# EAGLE schematic pdp8i-cpu (EAGLE 6.6.0), part 2 of 3
## Sheet 10 of 40
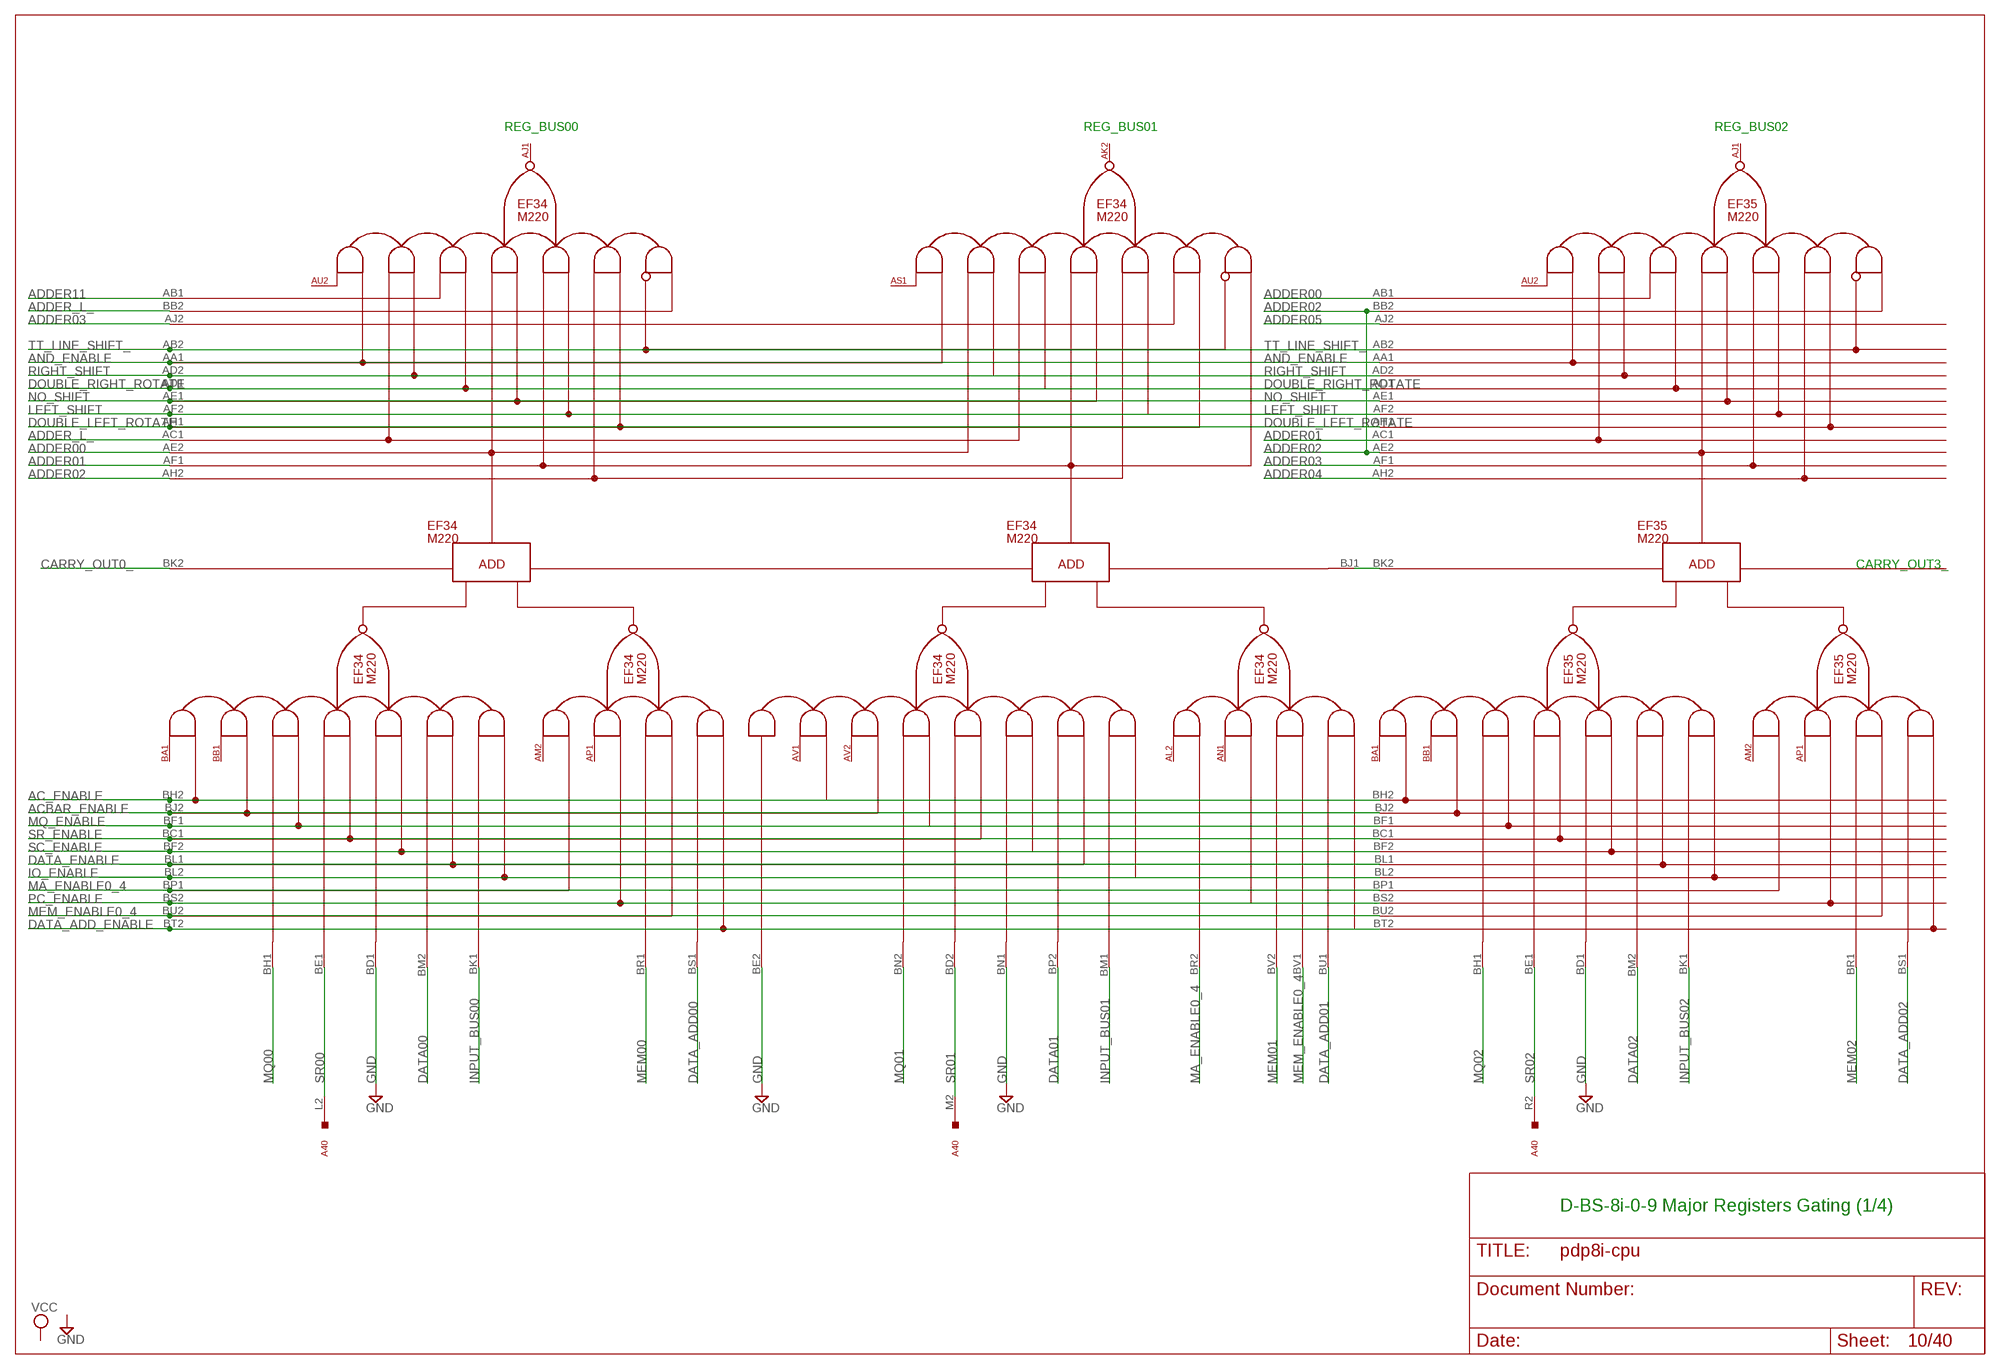
[diagram p9: schematic, sheet 10]

### Parts
A40  W077  M916  [H807]

### Nets
AC_ENABLE: EF34.BH2(B0:BH2) EF35.BH2(B0:BH2) ; also sheet 5,11,12,13
ACBAR_ENABLE: EF34.BJ2(B0:BJ2) EF35.BJ2(B0:BJ2) ; also sheet 5,11,12,13
ADDER00: EF34.AE2(B0:AE2) EF35.AB1(B0:AB1) ; also sheet 9,13
ADDER01: EF34.AF1(B0:AF1) EF35.AC1(B0:AC1) ; also sheet 9
ADDER02: EF34.AH2(B0:AH2) EF35.AE2(B0:AE2) EF35.BB2(B0:BB2) ; also sheet 11
ADDER03: EF34.AJ2(B0:AJ2) EF35.AF1(B0:AF1) ; also sheet 11
ADDER04: EF35.AH2(B0:AH2) ; also sheet 11,12
ADDER05: EF35.AJ2(B0:AJ2) ; also sheet 11,12
ADDER11: EF34.AB1(B0:AB1) ; also sheet 9,12,13
ADDER_L_: EF34.AC1(B0:AC1) EF34.BB2(B0:BB2) ; also sheet 9,13,28
AND_ENABLE: EF34.AA1(B0:AA1) EF35.AA1(B0:AA1) ; also sheet 6,11,12,13
CARRY_OUT0_: EF34.BK2(B0:BK2) ; also sheet 9
DATA00: EF34.BM2(B0:BM2) ; also sheet 14
DATA01: EF34.BP2(B1:BP2) ; also sheet 14
DATA02: EF35.BM2(B0:BM2) ; also sheet 14
DATA_ADD00: EF34.BS1(B0:BS1) ; also sheet 14
DATA_ADD01: EF34.BU1(B1:BU1) ; also sheet 14
DATA_ADD02: EF35.BS1(B0:BS1) ; also sheet 14
DATA_ADD_ENABLE: EF34.BT2(B0:BT2) EF35.BT2(B0:BT2) ; also sheet 5,11,12,13
DATA_ENABLE: EF34.BL1(B0:BL1) EF35.BL1(B0:BL1) ; also sheet 5,11,12,13
DOUBLE_LEFT_ROTATE: EF34.AH1(B0:AH1) EF35.AH1(B0:AH1) ; also sheet 6,9,11,12,13
DOUBLE_RIGHT_ROTATE: EF34.AD1(B0:AD1) EF35.AD1(B0:AD1) ; also sheet 6,9,11,12,13
GND [Suppply]: EF34.BD1(B0:BD1) EF34.BE2(B1:BE2) EF34.BN1(B1:BN1) EF35.BD1(B0:BD1) ; also sheet 2,5,9,11,12,13,14,22,26,27,30
INPUT_BUS00: EF34.BK1(B0:BK1) ; also sheet 14
INPUT_BUS01: EF34.BM1(B1:BM1) ; also sheet 14
INPUT_BUS02: EF35.BK1(B0:BK1) ; also sheet 14
IO_ENABLE: EF34.BL2(B0:BL2) EF35.BL2(B0:BL2) ; also sheet 5,7,11,12,13
LEFT_SHIFT: EF34.AF2(B0:AF2) EF35.AF2(B0:AF2) ; also sheet 6,9,11,12,13
MA_ENABLE0_4: EF34.BP1(B0:BP1) EF34.BR2(B1:BR2) EF35.BP1(B0:BP1) ; also sheet 5,11
MEM00: EF34.BR1(B0:BR1) ; also sheet 4,18,29,31
MEM01: EF34.BV2(B1:BV2) ; also sheet 4,18,31
MEM02: EF35.BR1(B0:BR1) ; also sheet 4,18,31
MEM_ENABLE0_4: EF34.BU2(B0:BU2) EF34.BV1(B1:BV1) EF35.BU2(B0:BU2) ; also sheet 5,6,11
MQ00: EF34.BH1(B0:BH1) ; also sheet 27,28
MQ01: EF34.BN2(B1:BN2) ; also sheet 28
MQ02: EF35.BH1(B0:BH1) ; also sheet 28
MQ_ENABLE: EF34.BF1(B0:BF1) EF35.BF1(B0:BF1) ; also sheet 11,12,13,27
N$160: EF34.BJ1(B1:BJ1) EF35.BK2(B0:BK2)
NO_SHIFT: EF34.AE1(B0:AE1) EF35.AE1(B0:AE1) ; also sheet 6,9,11,12,13
PC_ENABLE: EF34.BS2(B0:BS2) EF35.BS2(B0:BS2) ; also sheet 5,11,12,13
RIGHT_SHIFT: EF34.AD2(B0:AD2) EF35.AD2(B0:AD2) ; also sheet 6,9,11,12,13,28
SC_ENABLE: EF34.BF2(B0:BF2) EF35.BF2(B0:BF2) ; also sheet 11,12,13,27
SR00: A40.L2 EF34.BE1(B0:BE1)
SR01: A40.M2 EF34.BD2(B1:BD2)
SR02: A40.R2 EF35.BE1(B0:BE1)
SR_ENABLE: EF34.BC1(B0:BC1) EF35.BC1(B0:BC1) ; also sheet 5,11,12,13,22
TT_LINE_SHIFT_: EF34.AB2(B0:AB2) EF35.AB2(B0:AB2) ; also sheet 11,12,13,29
Unconnected: A40.A1 A40.B1 A40.B2 A40.C1 A40.D1 A40.E1 A40.F1 A40.H1 A40.J1 A40.K1 A40.L1 A40.M1 A40.N1 A40.N2 A40.P1 A40.P2 A40.R1 A40.S1 A40.T1 A40.U1 A40.V1

### Notes on the sheet
- REG_BUS00 | REG_BUS01 | REG_BUS02
- CARRY_OUT3_
- D-BS-8i-0-9 Major Registers Gating (1/4)

## Sheet 11 of 40
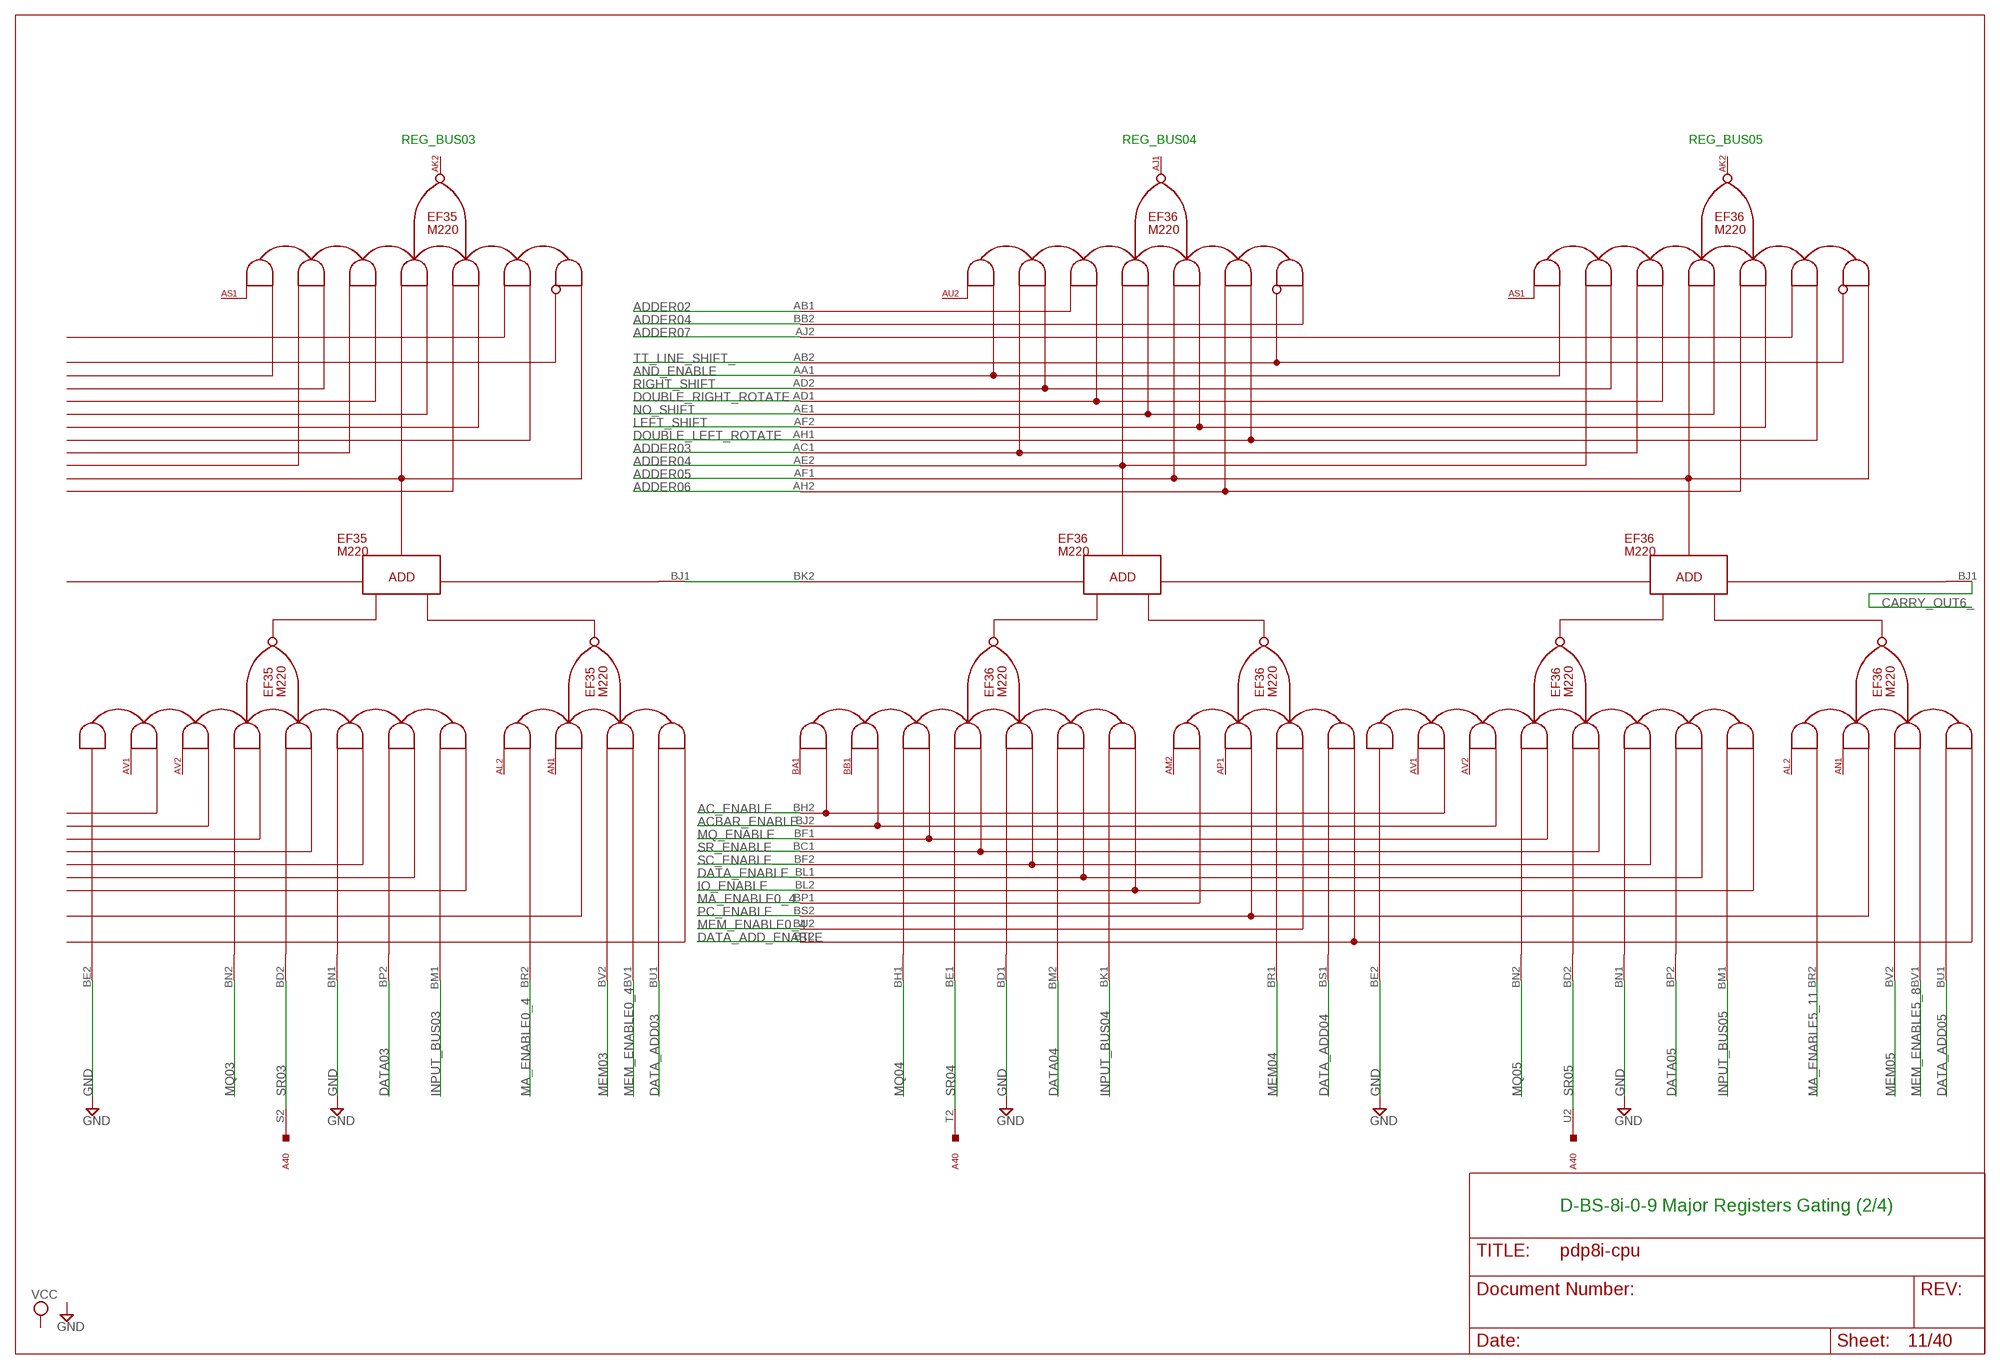
[diagram p10: schematic, sheet 11]

### Nets
AC_ENABLE: EF36.BH2(B0:BH2) ; also sheet 5,10,12,13
ACBAR_ENABLE: EF36.BJ2(B0:BJ2) ; also sheet 5,10,12,13
ADDER02: EF36.AB1(B0:AB1) ; also sheet 10
ADDER03: EF36.AC1(B0:AC1) ; also sheet 10
ADDER04: EF36.AE2(B0:AE2) EF36.BB2(B0:BB2) ; also sheet 10,12
ADDER05: EF36.AF1(B0:AF1) ; also sheet 10,12
ADDER06: EF36.AH2(B0:AH2) ; also sheet 12
ADDER07: EF36.AJ2(B0:AJ2) ; also sheet 12
AND_ENABLE: EF36.AA1(B0:AA1) ; also sheet 6,10,12,13
CARRY_OUT6_: EF36.BJ1(B1:BJ1) ; also sheet 12
DATA03: EF35.BP2(B1:BP2) ; also sheet 14
DATA04: EF36.BM2(B0:BM2) ; also sheet 14
DATA05: EF36.BP2(B1:BP2) ; also sheet 14
DATA_ADD03: EF35.BU1(B1:BU1) ; also sheet 14
DATA_ADD04: EF36.BS1(B0:BS1) ; also sheet 14
DATA_ADD05: EF36.BU1(B1:BU1) ; also sheet 14
DATA_ADD_ENABLE: EF36.BT2(B0:BT2) ; also sheet 5,10,12,13
DATA_ENABLE: EF36.BL1(B0:BL1) ; also sheet 5,10,12,13
DOUBLE_LEFT_ROTATE: EF36.AH1(B0:AH1) ; also sheet 6,9,10,12,13
DOUBLE_RIGHT_ROTATE: EF36.AD1(B0:AD1) ; also sheet 6,9,10,12,13
GND [Suppply]: EF35.BE2(B1:BE2) EF35.BN1(B1:BN1) EF36.BD1(B0:BD1) EF36.BE2(B1:BE2) EF36.BN1(B1:BN1) ; also sheet 2,5,9,10,12,13,14,22,26,27,30
INPUT_BUS03: EF35.BM1(B1:BM1) ; also sheet 14
INPUT_BUS04: EF36.BK1(B0:BK1) ; also sheet 14
INPUT_BUS05: EF36.BM1(B1:BM1) ; also sheet 14
IO_ENABLE: EF36.BL2(B0:BL2) ; also sheet 5,7,10,12,13
LEFT_SHIFT: EF36.AF2(B0:AF2) ; also sheet 6,9,10,12,13
MA_ENABLE0_4: EF35.BR2(B1:BR2) EF36.BP1(B0:BP1) ; also sheet 5,10
MA_ENABLE5_11: EF36.BR2(B1:BR2) ; also sheet 5,12,13
MEM03: EF35.BV2(B1:BV2) ; also sheet 18,31
MEM04: EF36.BR1(B0:BR1) ; also sheet 18,31
MEM05: EF36.BV2(B1:BV2) ; also sheet 18,31
MEM_ENABLE0_4: EF35.BV1(B1:BV1) EF36.BU2(B0:BU2) ; also sheet 5,6,10
MEM_ENABLE5_8: EF36.BV1(B1:BV1) ; also sheet 5,12
MQ03: EF35.BN2(B1:BN2) ; also sheet 28
MQ04: EF36.BH1(B0:BH1) ; also sheet 28
MQ05: EF36.BN2(B1:BN2) ; also sheet 28
MQ_ENABLE: EF36.BF1(B0:BF1) ; also sheet 10,12,13,27
N$133: EF35.BJ1(B1:BJ1) EF36.BK2(B0:BK2)
NO_SHIFT: EF36.AE1(B0:AE1) ; also sheet 6,9,10,12,13
PC_ENABLE: EF36.BS2(B0:BS2) ; also sheet 5,10,12,13
RIGHT_SHIFT: EF36.AD2(B0:AD2) ; also sheet 6,9,10,12,13,28
SC_ENABLE: EF36.BF2(B0:BF2) ; also sheet 10,12,13,27
SR03: A40.S2 EF35.BD2(B1:BD2)
SR04: A40.T2 EF36.BE1(B0:BE1)
SR05: A40.U2 EF36.BD2(B1:BD2)
SR_ENABLE: EF36.BC1(B0:BC1) ; also sheet 5,10,12,13,22
TT_LINE_SHIFT_: EF36.AB2(B0:AB2) ; also sheet 10,12,13,29

### Notes on the sheet
- REG_BUS03 | REG_BUS04 | REG_BUS05
- D-BS-8i-0-9 Major Registers Gating (2/4)

## Sheet 12 of 40
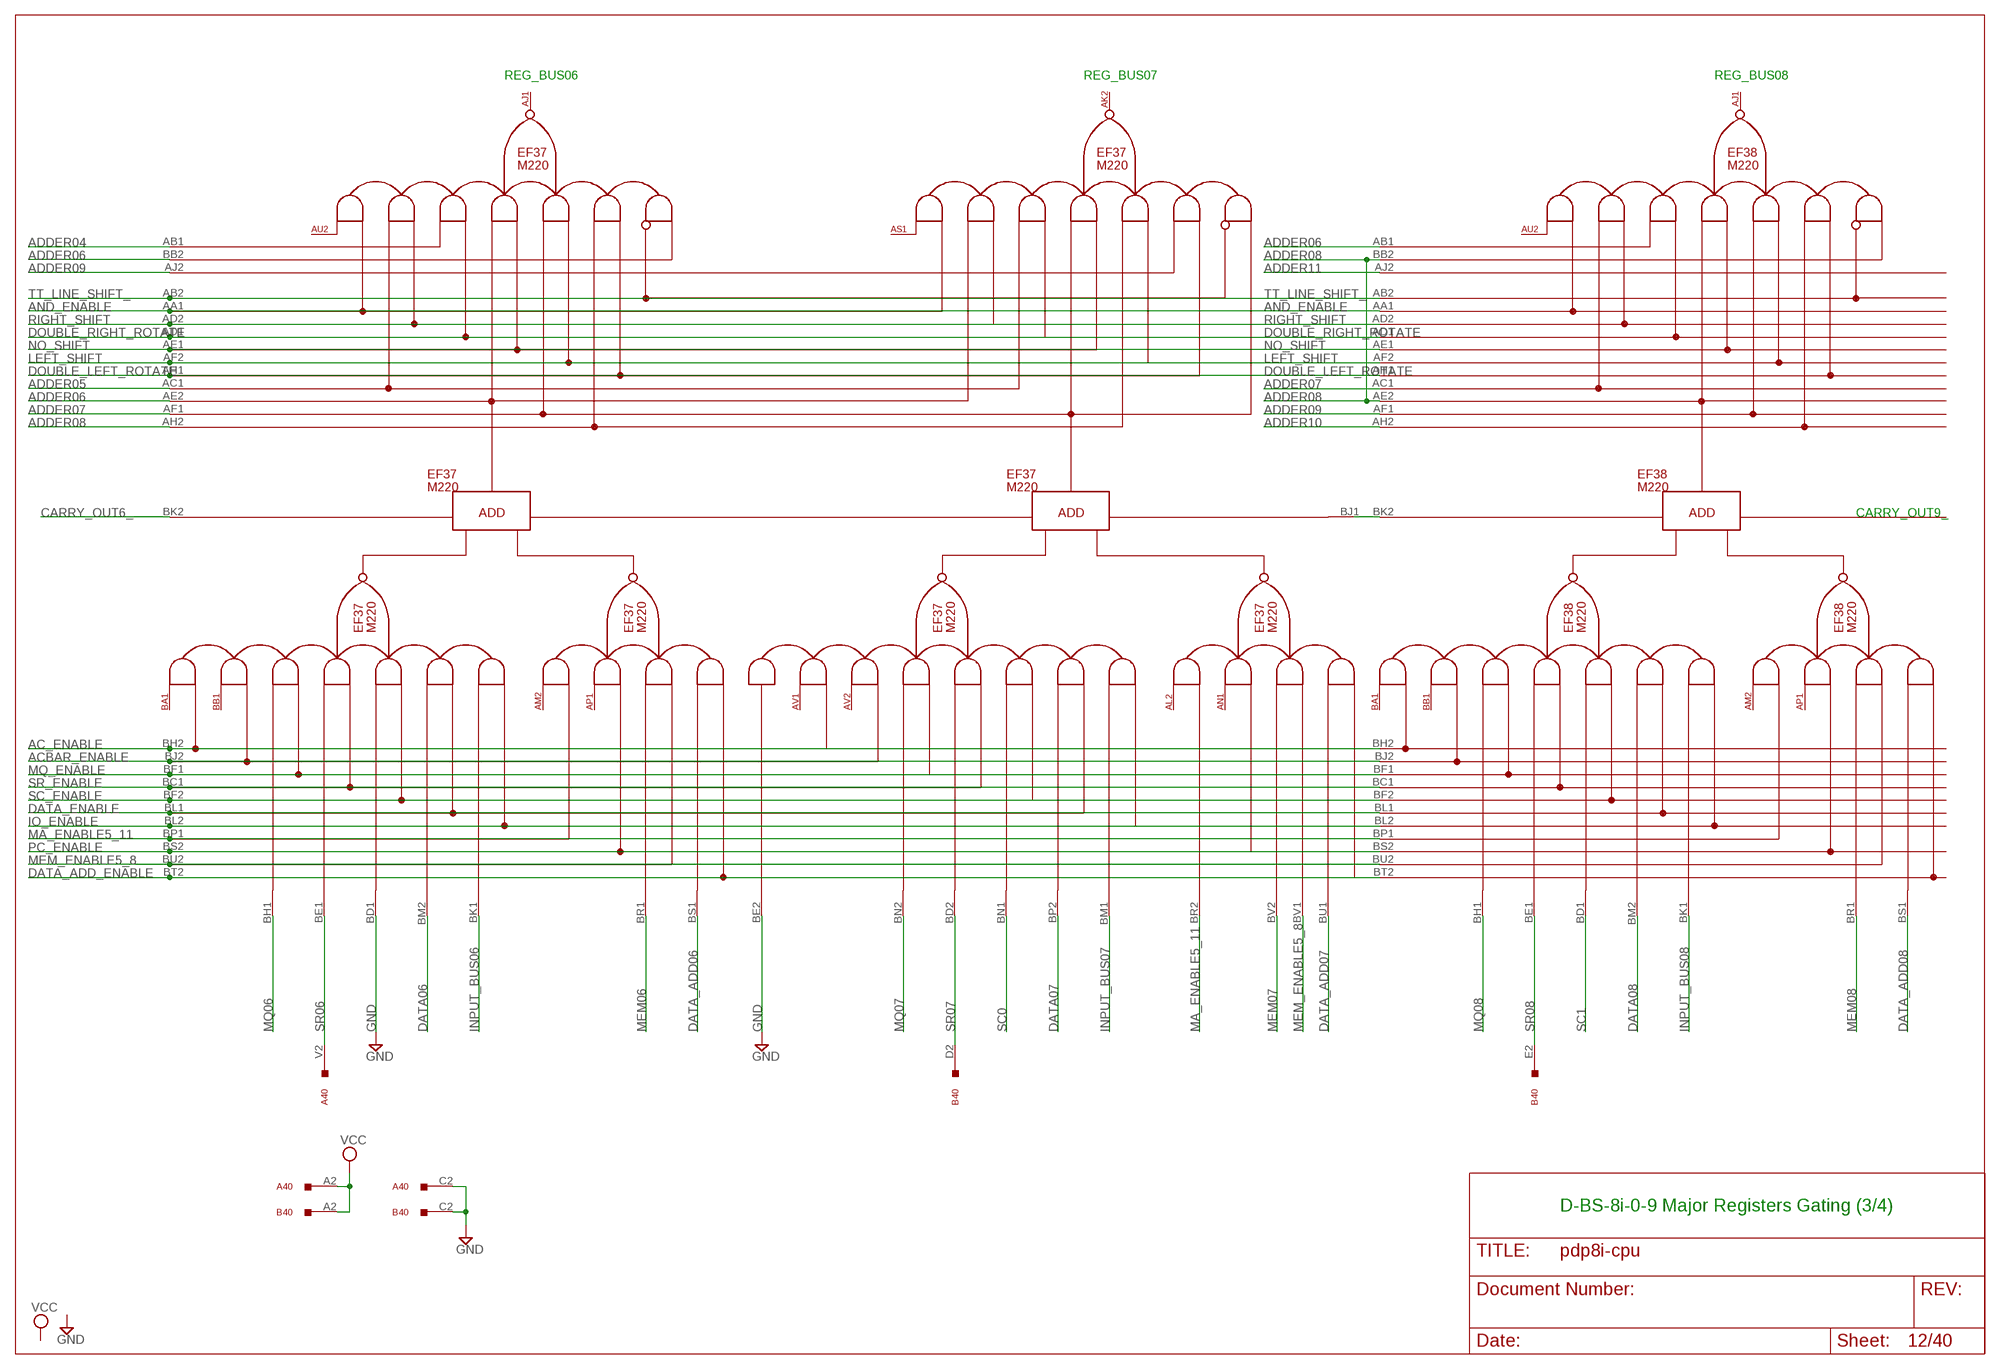
[diagram p11: schematic, sheet 12]

### Nets
AC_ENABLE: EF37.BH2(B0:BH2) EF38.BH2(B0:BH2) ; also sheet 5,10,11,13
ACBAR_ENABLE: EF37.BJ2(B0:BJ2) EF38.BJ2(B0:BJ2) ; also sheet 5,10,11,13
ADDER04: EF37.AB1(B0:AB1) ; also sheet 10,11
ADDER05: EF37.AC1(B0:AC1) ; also sheet 10,11
ADDER06: EF37.AE2(B0:AE2) EF37.BB2(B0:BB2) EF38.AB1(B0:AB1) ; also sheet 11
ADDER07: EF37.AF1(B0:AF1) EF38.AC1(B0:AC1) ; also sheet 11
ADDER08: EF37.AH2(B0:AH2) EF38.AE2(B0:AE2) EF38.BB2(B0:BB2) ; also sheet 13
ADDER09: EF37.AJ2(B0:AJ2) EF38.AF1(B0:AF1) ; also sheet 13
ADDER10: EF38.AH2(B0:AH2) ; also sheet 9,13
ADDER11: EF38.AJ2(B0:AJ2) ; also sheet 9,10,13
AND_ENABLE: EF37.AA1(B0:AA1) EF38.AA1(B0:AA1) ; also sheet 6,10,11,13
CARRY_OUT6_: EF37.BK2(B0:BK2) ; also sheet 11
DATA06: EF37.BM2(B0:BM2) ; also sheet 14
DATA07: EF37.BP2(B1:BP2) ; also sheet 14
DATA08: EF38.BM2(B0:BM2) ; also sheet 14
DATA_ADD06: EF37.BS1(B0:BS1) ; also sheet 14
DATA_ADD07: EF37.BU1(B1:BU1) ; also sheet 14
DATA_ADD08: EF38.BS1(B0:BS1) ; also sheet 14
DATA_ADD_ENABLE: EF37.BT2(B0:BT2) EF38.BT2(B0:BT2) ; also sheet 5,10,11,13
DATA_ENABLE: EF37.BL1(B0:BL1) EF38.BL1(B0:BL1) ; also sheet 5,10,11,13
DOUBLE_LEFT_ROTATE: EF37.AH1(B0:AH1) EF38.AH1(B0:AH1) ; also sheet 6,9,10,11,13
DOUBLE_RIGHT_ROTATE: EF37.AD1(B0:AD1) EF38.AD1(B0:AD1) ; also sheet 6,9,10,11,13
GND [Suppply]: A40.C2 B40.C2 EF37.BD1(B0:BD1) EF37.BE2(B1:BE2) ; also sheet 2,5,9,10,11,13,14,22,26,27,30
INPUT_BUS06: EF37.BK1(B0:BK1) ; also sheet 14
INPUT_BUS07: EF37.BM1(B1:BM1) ; also sheet 14
INPUT_BUS08: EF38.BK1(B0:BK1) ; also sheet 14
IO_ENABLE: EF37.BL2(B0:BL2) EF38.BL2(B0:BL2) ; also sheet 5,7,10,11,13
LEFT_SHIFT: EF37.AF2(B0:AF2) EF38.AF2(B0:AF2) ; also sheet 6,9,10,11,13
MA_ENABLE5_11: EF37.BP1(B0:BP1) EF37.BR2(B1:BR2) EF38.BP1(B0:BP1) ; also sheet 5,11,13
MEM06: EF37.BR1(B0:BR1) ; also sheet 18,31
MEM07: EF37.BV2(B1:BV2) ; also sheet 18,31
MEM08: EF38.BR1(B0:BR1) ; also sheet 18,31
MEM_ENABLE5_8: EF37.BU2(B0:BU2) EF37.BV1(B1:BV1) EF38.BU2(B0:BU2) ; also sheet 5,11
MQ06: EF37.BH1(B0:BH1) ; also sheet 28
MQ07: EF37.BN2(B1:BN2) ; also sheet 28
MQ08: EF38.BH1(B0:BH1) ; also sheet 28
MQ_ENABLE: EF37.BF1(B0:BF1) EF38.BF1(B0:BF1) ; also sheet 10,11,13,27
N$132: EF37.BJ1(B1:BJ1) EF38.BK2(B0:BK2)
NO_SHIFT: EF37.AE1(B0:AE1) EF38.AE1(B0:AE1) ; also sheet 6,9,10,11,13
PC_ENABLE: EF37.BS2(B0:BS2) EF38.BS2(B0:BS2) ; also sheet 5,10,11,13
RIGHT_SHIFT: EF37.AD2(B0:AD2) EF38.AD2(B0:AD2) ; also sheet 6,9,10,11,13,28
SC0: EF37.BN1(B1:BN1) ; also sheet 27,28
SC1: EF38.BD1(B0:BD1) ; also sheet 27,28
SC_ENABLE: EF37.BF2(B0:BF2) EF38.BF2(B0:BF2) ; also sheet 10,11,13,27
SR06: A40.V2 EF37.BE1(B0:BE1)
SR07: B40.D2 EF37.BD2(B1:BD2)
SR08: B40.E2 EF38.BE1(B0:BE1)
SR_ENABLE: EF37.BC1(B0:BC1) EF38.BC1(B0:BC1) ; also sheet 5,10,11,13,22
TT_LINE_SHIFT_: EF37.AB2(B0:AB2) EF38.AB2(B0:AB2) ; also sheet 10,11,13,29
VCC [Suppply]: A40.A2 B40.A2 ; also sheet 9

### Notes on the sheet
- REG_BUS06 | REG_BUS07 | REG_BUS08
- CARRY_OUT9_
- D-BS-8i-0-9 Major Registers Gating (3/4)

## Sheet 13 of 40
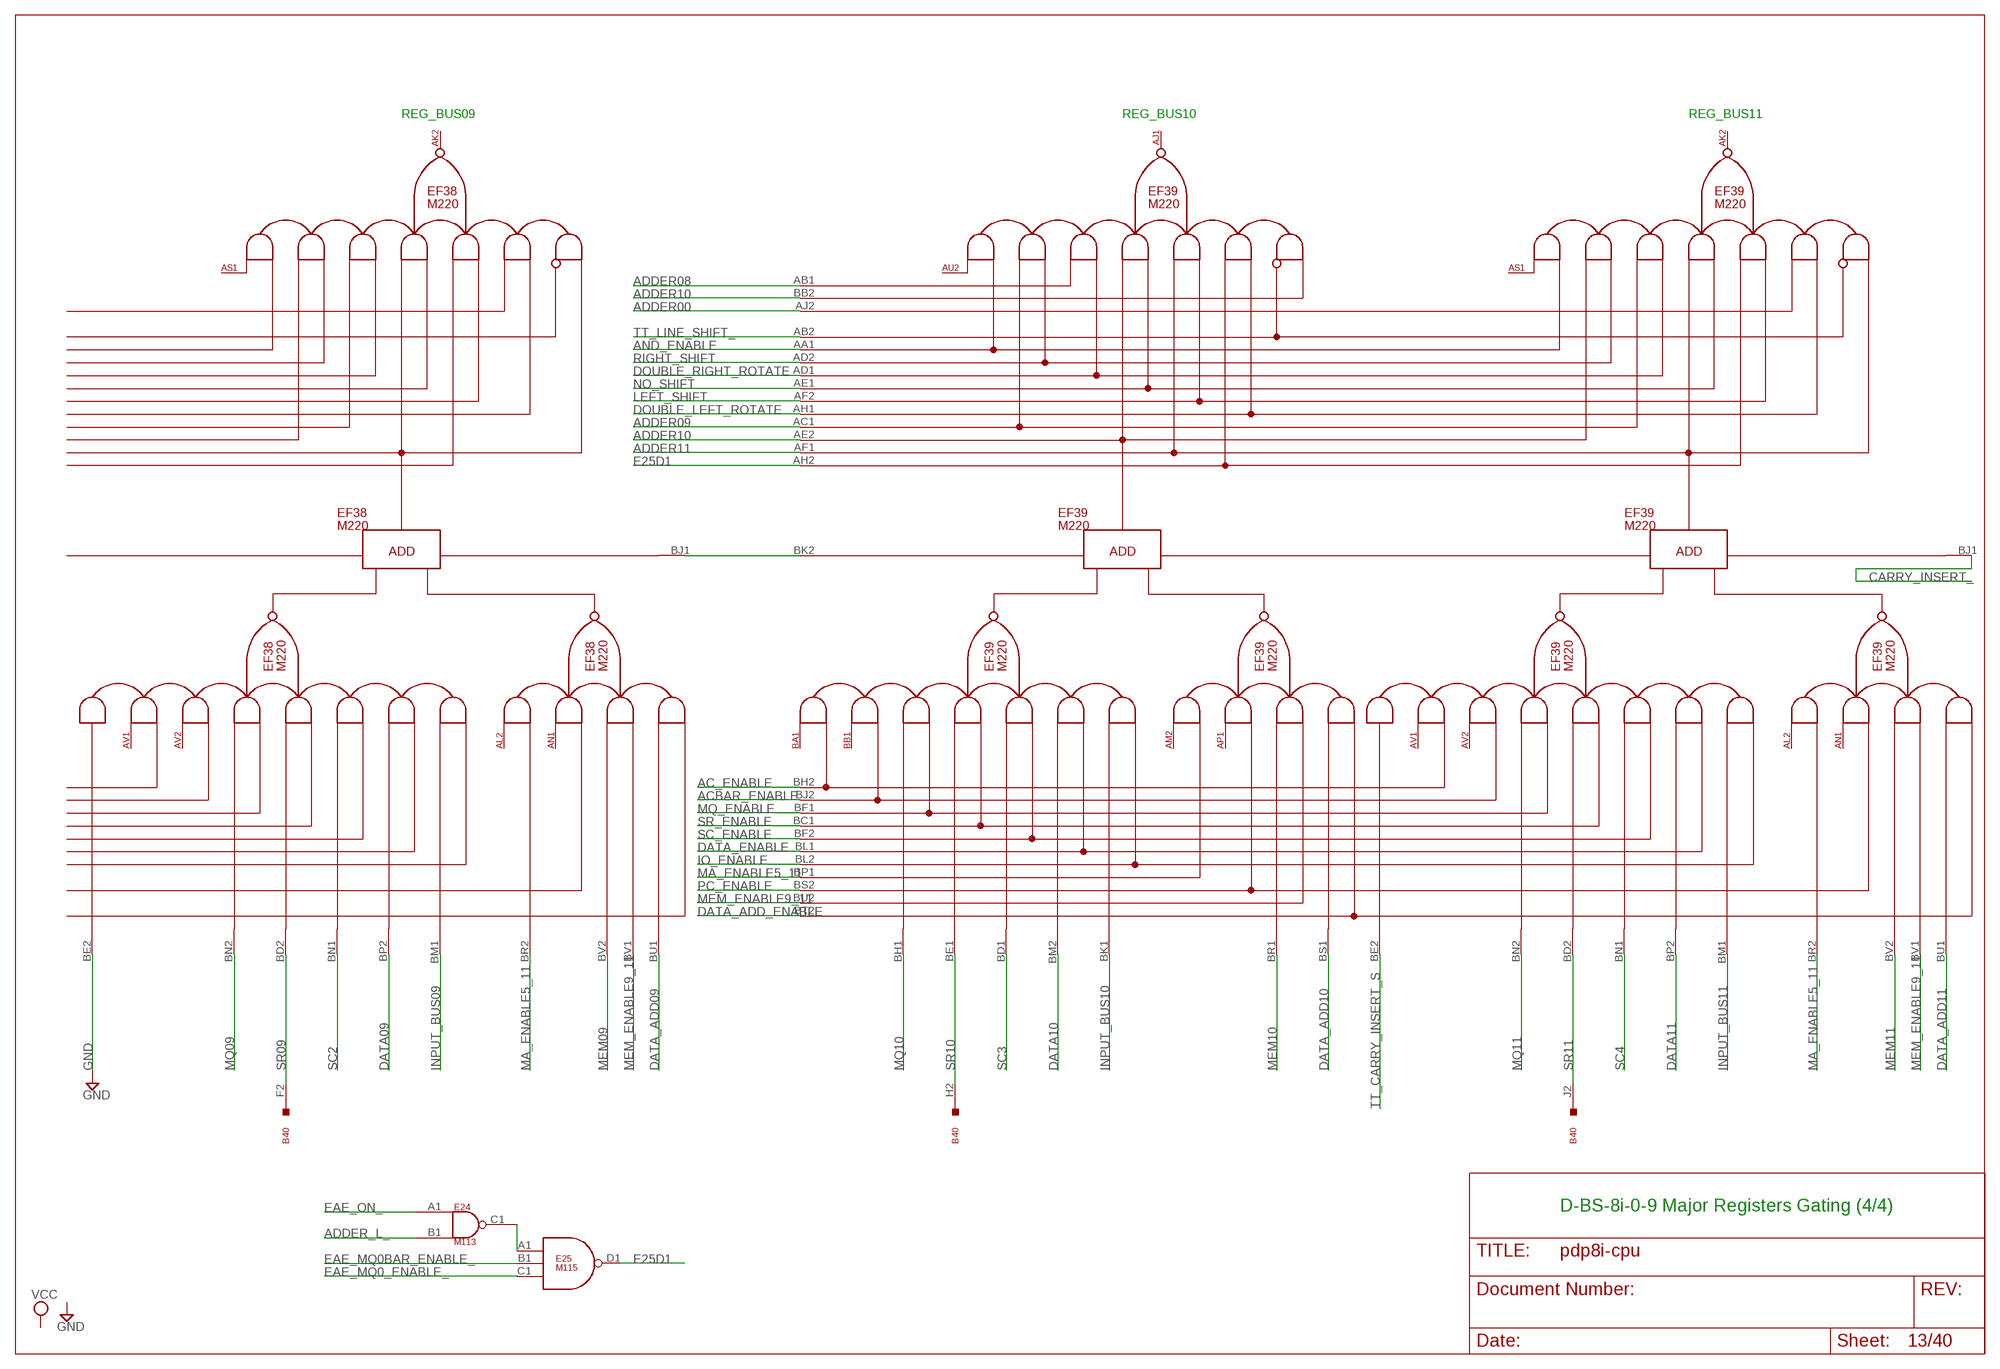
[diagram p12: schematic, sheet 13]

### Nets
AC_ENABLE: EF39.BH2(B0:BH2) ; also sheet 5,10,11,12
ACBAR_ENABLE: EF39.BJ2(B0:BJ2) ; also sheet 5,10,11,12
ADDER00: EF39.AJ2(B0:AJ2) ; also sheet 9,10
ADDER08: EF39.AB1(B0:AB1) ; also sheet 12
ADDER09: EF39.AC1(B0:AC1) ; also sheet 12
ADDER10: EF39.AE2(B0:AE2) EF39.BB2(B0:BB2) ; also sheet 9,12
ADDER11: EF39.AF1(B0:AF1) ; also sheet 9,10,12
ADDER_L_: E24.B1(C1:IN2) ; also sheet 9,10,28
AND_ENABLE: EF39.AA1(B0:AA1) ; also sheet 6,10,11,12
CARRY_INSERT_: EF39.BJ1(B1:BJ1) ; also sheet 6
DATA09: EF38.BP2(B1:BP2) ; also sheet 14
DATA10: EF39.BM2(B0:BM2) ; also sheet 14
DATA11: EF39.BP2(B1:BP2) ; also sheet 14
DATA_ADD09: EF38.BU1(B1:BU1) ; also sheet 14
DATA_ADD10: EF39.BS1(B0:BS1) ; also sheet 14
DATA_ADD11: EF39.BU1(B1:BU1) ; also sheet 14
DATA_ADD_ENABLE: EF39.BT2(B0:BT2) ; also sheet 5,10,11,12
DATA_ENABLE: EF39.BL1(B0:BL1) ; also sheet 5,10,11,12
DOUBLE_LEFT_ROTATE: EF39.AH1(B0:AH1) ; also sheet 6,9,10,11,12
DOUBLE_RIGHT_ROTATE: EF39.AD1(B0:AD1) ; also sheet 6,9,10,11,12
E25D1: E25.D1(D1:OUT) EF39.AH2(B0:AH2)
EAE_MQ0_ENABLE_: E25.C1(D1:IN3) ; also sheet 27
EAE_MQ0BAR_ENABLE_: E25.B1(D1:IN2) ; also sheet 27
EAE_ON_: E24.A1(C1:IN1) ; also sheet 9,27
GND [Suppply]: EF38.BE2(B1:BE2) ; also sheet 2,5,9,10,11,12,14,22,26,27,30
INPUT_BUS09: EF38.BM1(B1:BM1) ; also sheet 14
INPUT_BUS10: EF39.BK1(B0:BK1) ; also sheet 14
INPUT_BUS11: EF39.BM1(B1:BM1) ; also sheet 14
IO_ENABLE: EF39.BL2(B0:BL2) ; also sheet 5,7,10,11,12
LEFT_SHIFT: EF39.AF2(B0:AF2) ; also sheet 6,9,10,11,12
MA_ENABLE5_11: EF38.BR2(B1:BR2) EF39.BP1(B0:BP1) EF39.BR2(B1:BR2) ; also sheet 5,11,12
MEM09: EF38.BV2(B1:BV2) ; also sheet 18,29,31
MEM10: EF39.BR1(B0:BR1) ; also sheet 18,31
MEM11: EF39.BV2(B1:BV2) ; also sheet 18,31
MEM_ENABLE9_11: EF38.BV1(B1:BV1) EF39.BU2(B0:BU2) EF39.BV1(B1:BV1) ; also sheet 5
MQ09: EF38.BN2(B1:BN2) ; also sheet 28
MQ10: EF39.BH1(B0:BH1) ; also sheet 27,28
MQ11: EF39.BN2(B1:BN2) ; also sheet 27,28
MQ_ENABLE: EF39.BF1(B0:BF1) ; also sheet 10,11,12,27
N$136: EF38.BJ1(B1:BJ1) EF39.BK2(B0:BK2)
N$140: E24.C1(C1:OUT) E25.A1(D1:IN1)
NO_SHIFT: EF39.AE1(B0:AE1) ; also sheet 6,9,10,11,12
PC_ENABLE: EF39.BS2(B0:BS2) ; also sheet 5,10,11,12
RIGHT_SHIFT: EF39.AD2(B0:AD2) ; also sheet 6,9,10,11,12,28
SC2: EF38.BN1(B1:BN1) ; also sheet 27,28
SC3: EF39.BD1(B0:BD1) ; also sheet 27,28
SC4: EF39.BN1(B1:BN1) ; also sheet 27,28
SC_ENABLE: EF39.BF2(B0:BF2) ; also sheet 10,11,12,27
SR09: B40.F2 EF38.BD2(B1:BD2)
SR10: B40.H2 EF39.BE1(B0:BE1)
SR11: B40.J2 EF39.BD2(B1:BD2)
SR_ENABLE: EF39.BC1(B0:BC1) ; also sheet 5,10,11,12,22
TT_CARRY_INSERT_S: EF39.BE2(B1:BE2) ; also sheet 29
TT_LINE_SHIFT_: EF39.AB2(B0:AB2) ; also sheet 10,11,12,29

### Notes on the sheet
- REG_BUS09 | REG_BUS10 | REG_BUS11
- D-BS-8i-0-9 Major Registers Gating (4/4)

## Sheet 14 of 40
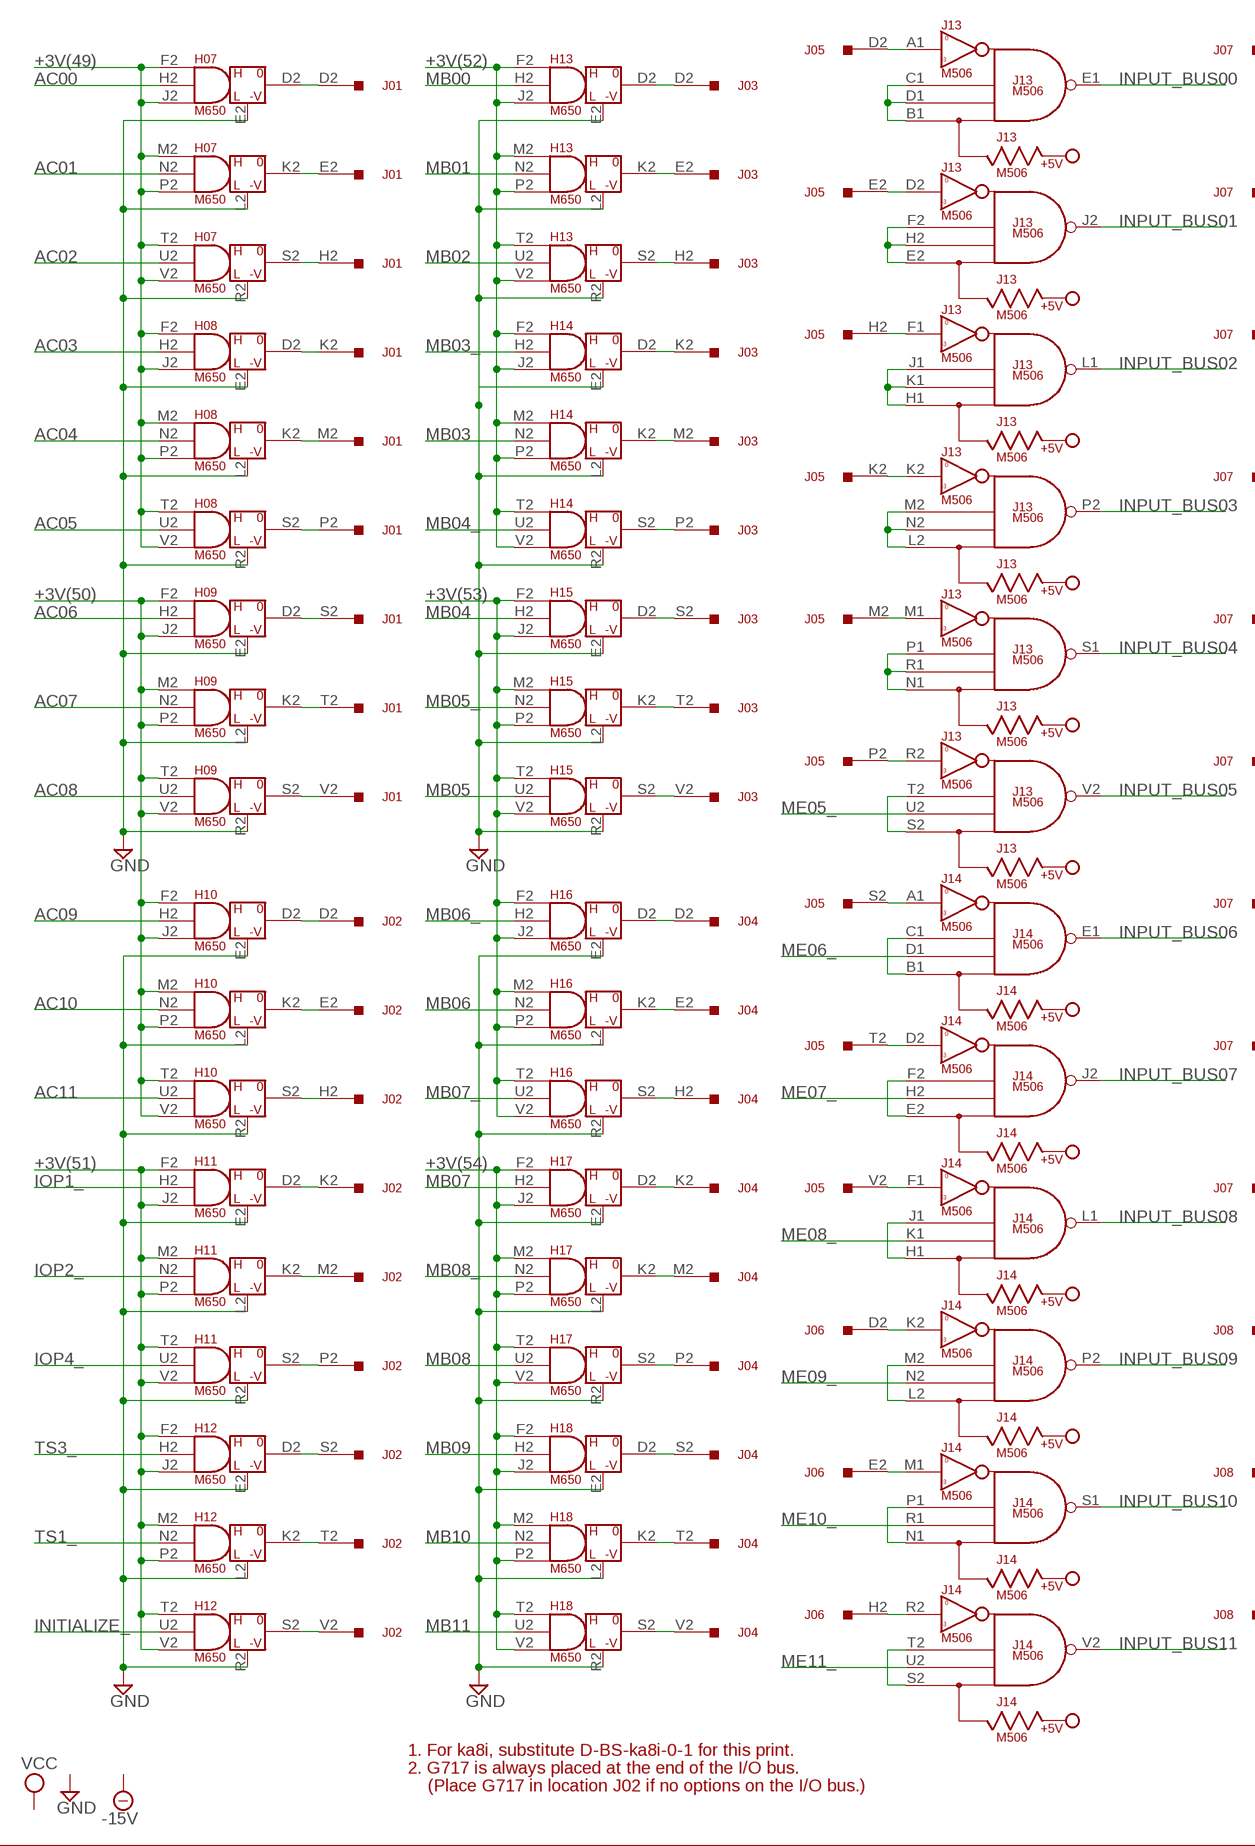
[diagram p13: schematic, sheet 14, part 1 of 2]
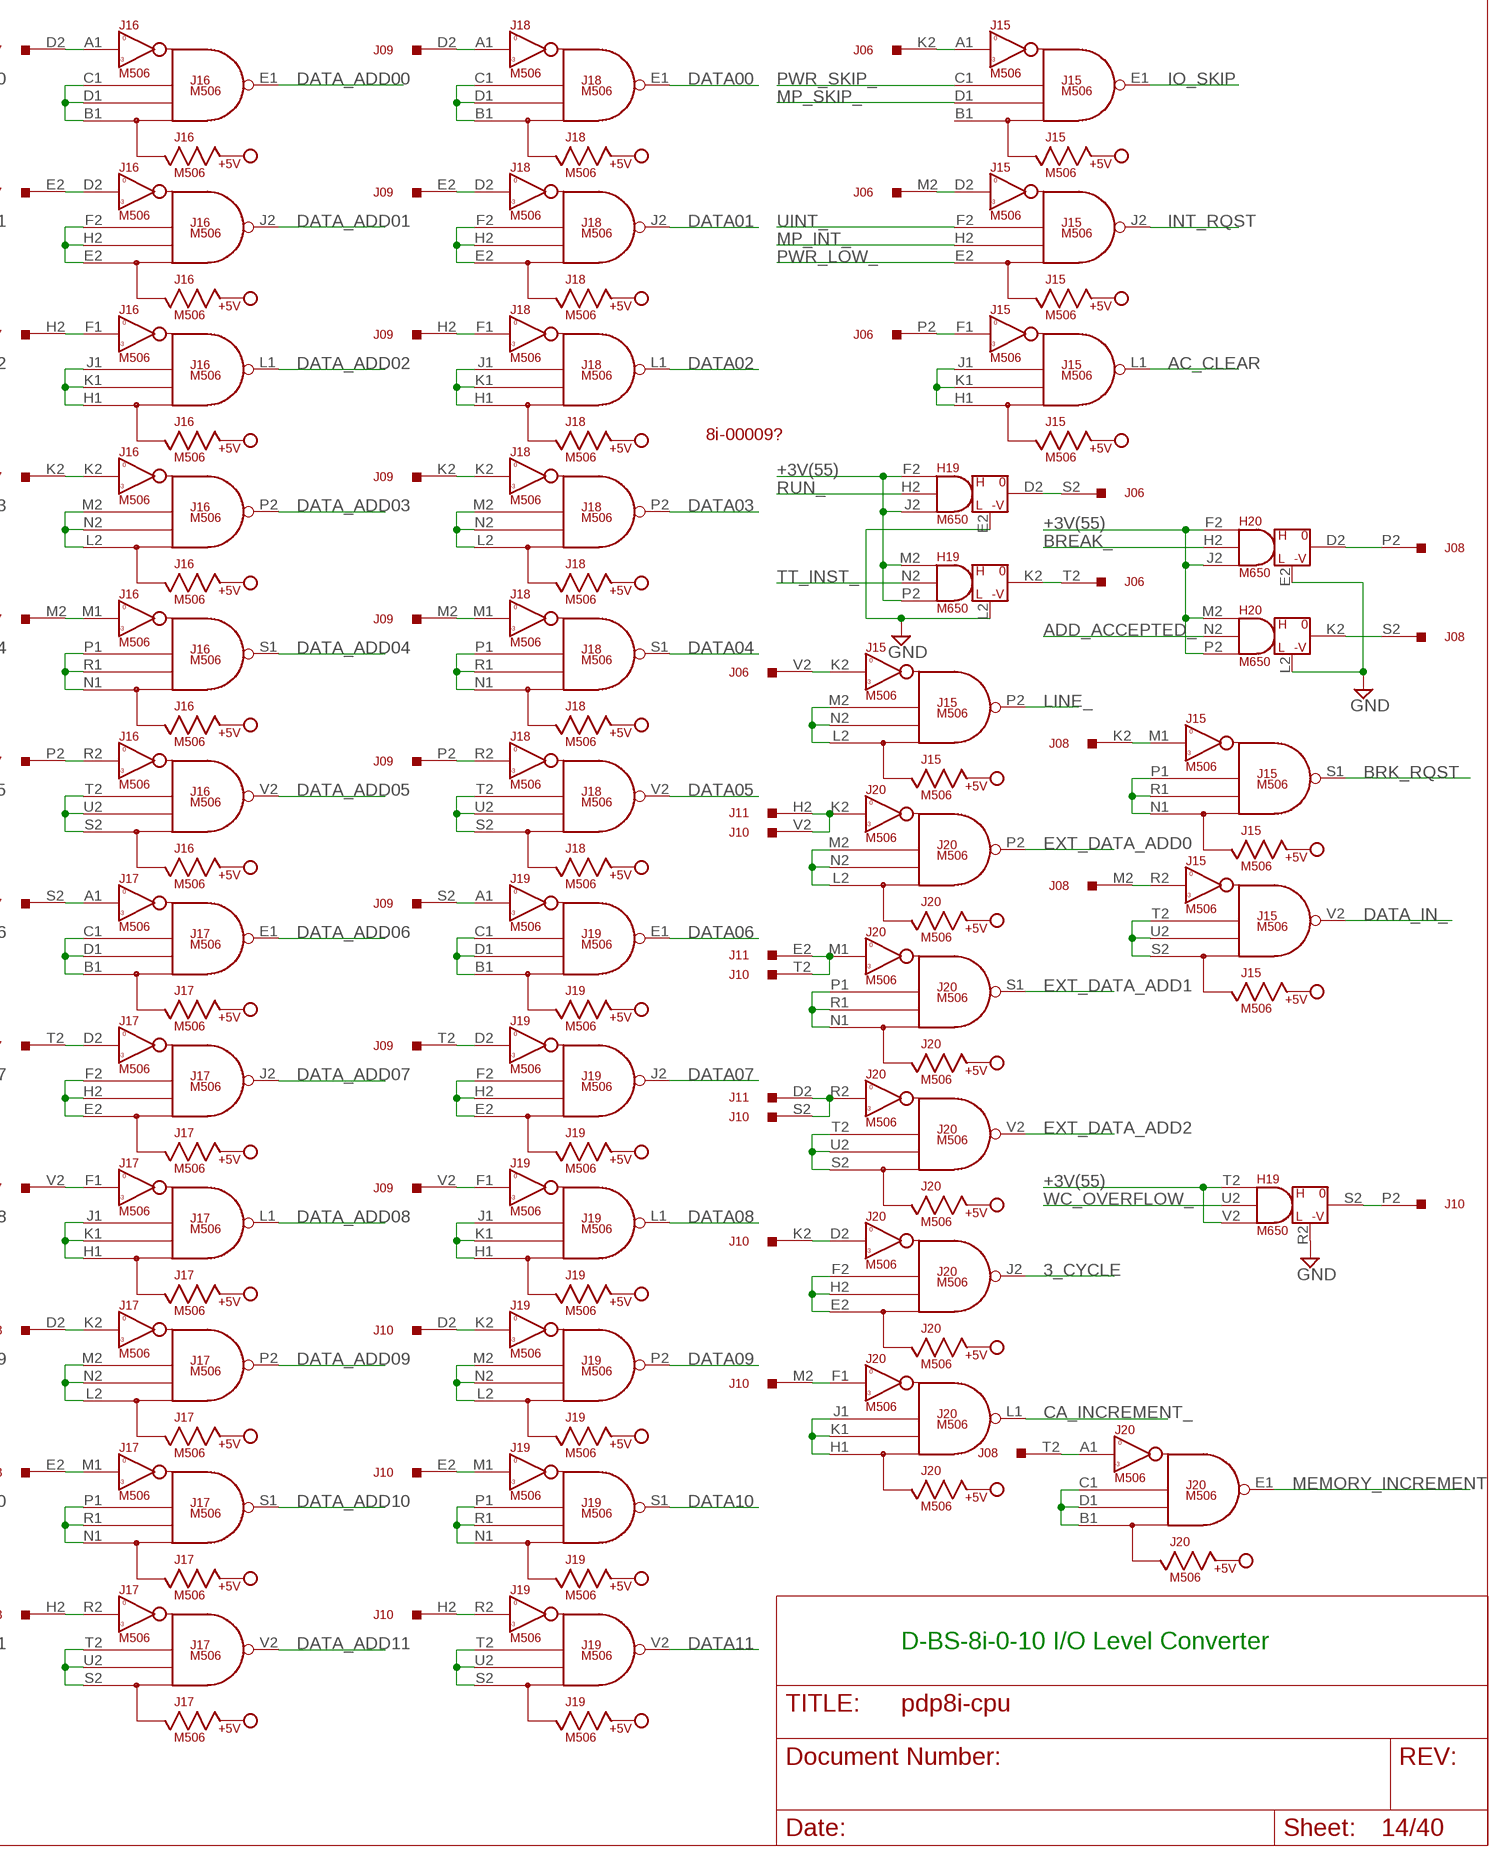
[diagram p14: schematic, sheet 14, part 2 of 2]

### Parts
H07  M650  [H807]
H08  M650  [H807]
H09  M650  [H807]
H10  M650  [H807]
H11  M650  [H807]
H12  M650  [H807]
H13  M650  [H807]
H14  M650  [H807]
H15  M650  [H807]
H16  M650  [H807]
H17  M650  [H807]
H18  M650  [H807]
H19  M650  [H807]
H20  M650  [H807]
J01  W011  [H807]
J02  W011  [H807]
J03  W011  [H807]
J04  W011  [H807]
J05  W011  [H807]
J06  W011  [H807]
J07  W011  [H807]
J08  W011  [H807]
J09  W011  [H807]
J10  W011  [H807]
J13  M506  [H807]
J14  M506  [H807]
J15  M506  [H807]
J16  M506  [H807]
J17  M506  [H807]
J18  M506  [H807]
J19  M506  [H807]
J20  M506  [H807]

### Nets
3_CYCLE: J20.J2(J2:OUT) ; also sheet 4
3CYCLE: J10.K2 J20.D2(J2:IN)
+3V(49): H07.F2(IN1) H07.J2(IN3) H07.M2(IN1) H07.P2(IN3) H07.T2(IN1) H07.V2(IN3) H08.F2(IN1) H08.J2(IN3) H08.M2(IN1) H08.P2(IN3) H08.T2(IN1) H08.V2(IN3) ; also sheet 1
+3V(50): H09.F2(IN1) H09.J2(IN3) H09.M2(IN1) H09.P2(IN3) H09.T2(IN1) H09.V2(IN3) H10.F2(IN1) H10.J2(IN3) H10.M2(IN1) H10.P2(IN3) H10.T2(IN1) H10.V2(IN3) ; also sheet 1
+3V(51): H11.F2(IN1) H11.J2(IN3) H11.M2(IN1) H11.P2(IN3) H11.T2(IN1) H11.V2(IN3) H12.F2(IN1) H12.J2(IN3) H12.M2(IN1) H12.P2(IN3) H12.T2(IN1) H12.V2(IN3) ; also sheet 1
+3V(52): H13.F2(IN1) H13.J2(IN3) H13.M2(IN1) H13.P2(IN3) H13.T2(IN1) H13.V2(IN3) H14.F2(IN1) H14.J2(IN3) H14.M2(IN1) H14.P2(IN3) H14.T2(IN1) H14.V2(IN3) ; also sheet 1
+3V(53): H15.F2(IN1) H15.J2(IN3) H15.M2(IN1) H15.P2(IN3) H15.T2(IN1) H15.V2(IN3) H16.F2(IN1) H16.J2(IN3) H16.M2(IN1) H16.P2(IN3) H16.T2(IN1) H16.V2(IN3) ; also sheet 1
+3V(54): H17.F2(IN1) H17.J2(IN3) H17.M2(IN1) H17.P2(IN3) H17.T2(IN1) H17.V2(IN3) H18.F2(IN1) H18.J2(IN3) H18.M2(IN1) H18.P2(IN3) H18.T2(IN1) H18.V2(IN3) ; also sheet 1
+3V(55): H19.F2(IN1) H19.J2(IN3) H19.M2(IN1) H19.P2(IN3) H19.T2(IN1) H19.V2(IN3) H20.F2(IN1) H20.J2(IN3) H20.M2(IN1) H20.P2(IN3) ; also sheet 1,4
AC00: H07.H2(IN2) ; also sheet 7,9,27,28
AC01: H07.N2(IN2) ; also sheet 9,27,28
AC02: H07.U2(IN2) ; also sheet 9,27,28
AC03: H08.H2(IN2) ; also sheet 9,28
AC04: H08.N2(IN2) ; also sheet 9,28
AC05: H08.U2(IN2) ; also sheet 9,28
AC06: H09.H2(IN2) ; also sheet 9,28
AC07: H09.N2(IN2) ; also sheet 9,28
AC08: H09.U2(IN2) ; also sheet 9,28
AC09: H10.H2(IN2) ; also sheet 9,28
AC10: H10.N2(IN2) ; also sheet 9,28
AC11: H10.U2(IN2) ; also sheet 9,28
AC_CLEAR: J15.L1(L1:OUT) ; also sheet 5
ACCLR: J06.P2 J15.F1(L1:IN)
ADD_ACCEPTED_: H20.N2(IN2) ; also sheet 8
BAC00: H07.D2(OUT) J01.D2
BAC01: H07.K2(OUT) J01.E2
BAC02: H07.S2(OUT) J01.H2
BAC03: H08.D2(OUT) J01.K2
BAC04: H08.K2(OUT) J01.M2
BAC05: H08.S2(OUT) J01.P2
BAC06: H09.D2(OUT) J01.S2
BAC07: H09.K2(OUT) J01.T2
BAC08: H09.S2(OUT) J01.V2
BAC09: H10.D2(OUT) J02.D2
BAC10: H10.K2(OUT) J02.E2
BAC11: H10.S2(OUT) J02.H2
BADD_ACCEPTED_: H20.K2(OUT) J08.S2
BBREAK: H20.D2(OUT) J08.P2
BINITIALIZE_: H12.S2(OUT) J02.V2
BIOP1_: H11.D2(OUT) J02.K2
BIOP2_: H11.K2(OUT) J02.M2
BIOP4_: H11.S2(OUT) J02.P2
BMB00: H13.D2(OUT) J03.D2
BMB01: H13.K2(OUT) J03.E2
BMB02: H13.S2(OUT) J03.H2
BMB03: H14.K2(OUT) J03.M2
BMB03_: H14.D2(OUT) J03.K2
BMB04: H15.D2(OUT) J03.S2
BMB04_: H14.S2(OUT) J03.P2
BMB05: H15.S2(OUT) J03.V2
BMB05_: H15.K2(OUT) J03.T2
BMB06: H16.K2(OUT) J04.E2
BMB06_: H16.D2(OUT) J04.D2
BMB07: H17.D2(OUT) J04.K2
BMB07_: H16.S2(OUT) J04.H2
BMB08: H17.S2(OUT) J04.P2
BMB08_: H17.K2(OUT) J04.M2
BMB09: H18.D2(OUT) J04.S2
BMB10: H18.K2(OUT) J04.T2
BMB11: H18.S2(OUT) J04.V2
BREAK_: H20.H2(IN2) ; also sheet 4
BRK_RQST: J15.S1(S1:OUT) ; also sheet 4
BRQ: J08.K2 J15.M1(S1:IN)
BRUN_: H19.D2(OUT) J06.S2
BTS1: H12.K2(OUT) J02.T2
BTS3: H12.D2(OUT) J02.S2
BTT_INST_: H19.K2(OUT) J06.T2
BWC_OVERFLOW: H19.S2(OUT) J10.P2
CA_INCR_: J10.M2 J20.F1(L1:IN)
CA_INCREMENT_: J20.L1(L1:OUT) ; also sheet 6
D00: J09.D2 J18.A1(E1:IN)
D01: J09.E2 J18.D2(J2:IN)
D02: J09.H2 J18.F1(L1:IN)
D03: J09.K2 J18.K2(P2:IN)
D04: J09.M2 J18.M1(S1:IN)
D05: J09.P2 J18.R2(V2:IN)
D06: J09.S2 J19.A1(E1:IN)
D07: J09.T2 J19.D2(J2:IN)
D08: J09.V2 J19.F1(L1:IN)
D09: J10.D2 J19.K2(P2:IN)
D10: J10.E2 J19.M1(S1:IN)
D11: J10.H2 J19.R2(V2:IN)
D_IN_: J08.M2 J15.R2(V2:IN)
DA00: J07.D2 J16.A1(E1:IN)
DA01: J07.E2 J16.D2(J2:IN)
DA02: J07.H2 J16.F1(L1:IN)
DA03: J07.K2 J16.K2(P2:IN)
DA04: J07.M2 J16.M1(S1:IN)
DA05: J07.P2 J16.R2(V2:IN)
DA06: J07.S2 J17.A1(E1:IN)
DA07: J07.T2 J17.D2(J2:IN)
DA08: J07.V2 J17.F1(L1:IN)
DA09: J08.D2 J17.K2(P2:IN)
DA10: J08.E2 J17.M1(S1:IN)
DA11: J08.H2 J17.R2(V2:IN)
DATA00: J18.E1(E1:OUT) ; also sheet 10
DATA01: J18.J2(J2:OUT) ; also sheet 10
DATA02: J18.L1(L1:OUT) ; also sheet 10
DATA03: J18.P2(P2:OUT) ; also sheet 11
DATA04: J18.S1(S1:OUT) ; also sheet 11
DATA05: J18.V2(V2:OUT) ; also sheet 11
DATA06: J19.E1(E1:OUT) ; also sheet 12
DATA07: J19.J2(J2:OUT) ; also sheet 12
DATA08: J19.L1(L1:OUT) ; also sheet 12
DATA09: J19.P2(P2:OUT) ; also sheet 13
DATA10: J19.S1(S1:OUT) ; also sheet 13
DATA11: J19.V2(V2:OUT) ; also sheet 13
DATA_ADD00: J16.E1(E1:OUT) ; also sheet 10
DATA_ADD01: J16.J2(J2:OUT) ; also sheet 10
DATA_ADD02: J16.L1(L1:OUT) ; also sheet 10
DATA_ADD03: J16.P2(P2:OUT) ; also sheet 11
DATA_ADD04: J16.S1(S1:OUT) ; also sheet 11
DATA_ADD05: J16.V2(V2:OUT) ; also sheet 11
DATA_ADD06: J17.E1(E1:OUT) ; also sheet 12
DATA_ADD07: J17.J2(J2:OUT) ; also sheet 12
DATA_ADD08: J17.L1(L1:OUT) ; also sheet 12
DATA_ADD09: J17.P2(P2:OUT) ; also sheet 13
DATA_ADD10: J17.S1(S1:OUT) ; also sheet 13
DATA_ADD11: J17.V2(V2:OUT) ; also sheet 13
DATA_IN_: J15.V2(V2:OUT) ; also sheet 5
EDA0: J10.V2 J11.H2 J20.K2(P2:IN)
EDA1: J10.T2 J11.E2 J20.M1(S1:IN)
EDA2: J10.S2 J11.D2 J20.R2(V2:IN)
EXT_DATA_ADD0: J20.P2(P2:OUT) ; also sheet 21
EXT_DATA_ADD1: J20.S1(S1:OUT) ; also sheet 21
EXT_DATA_ADD2: J20.V2(V2:OUT) ; also sheet 21
GND [Suppply]: H07.E2(SLOW) H07.L2(SLOW) H07.R2(SLOW) H08.E2(SLOW) H08.L2(SLOW) H08.R2(SLOW) H09.E2(SLOW) H09.L2(SLOW) H09.R2(SLOW) H10.E2(SLOW) H10.L2(SLOW) H10.R2(SLOW) H11.E2(SLOW) H11.L2(SLOW) H11.R2(SLOW) H12.E2(SLOW) H12.L2(SLOW) H12.R2(SLOW) H13.E2(SLOW) H13.L2(SLOW) H13.R2(SLOW) H14.E2(SLOW) H14.L2(SLOW) H14.R2(SLOW) H15.E2(SLOW) H15.L2(SLOW) H15.R2(SLOW) H16.E2(SLOW) H16.L2(SLOW) H16.R2(SLOW) H17.E2(SLOW) H17.L2(SLOW) H17.R2(SLOW) H18.E2(SLOW) H18.L2(SLOW) H18.R2(SLOW) H19.E2(SLOW) H19.L2(SLOW) H19.R2(SLOW) H20.E2(SLOW) H20.L2(SLOW) ; also sheet 2,5,9,10,11,12,13,22,26,27,30
IN00: J05.D2 J13.A1(E1:IN)
IN01: J05.E2 J13.D2(J2:IN)
IN02: J05.H2 J13.F1(L1:IN)
IN03: J05.K2 J13.K2(P2:IN)
IN04: J05.M2 J13.M1(S1:IN)
IN05: J05.P2 J13.R2(V2:IN)
IN06: J05.S2 J14.A1(E1:IN)
IN07: J05.T2 J14.D2(J2:IN)
IN08: J05.V2 J14.F1(L1:IN)
IN09: J06.D2 J14.K2(P2:IN)
IN10: J06.E2 J14.M1(S1:IN)
IN11: J06.H2 J14.R2(V2:IN)
INITIALIZE_: H12.U2(IN2) ; also sheet 2,26,30,32
INPUT_BUS00: J13.E1(E1:OUT) ; also sheet 10
INPUT_BUS01: J13.J2(J2:OUT) ; also sheet 10
INPUT_BUS02: J13.L1(L1:OUT) ; also sheet 10
INPUT_BUS03: J13.P2(P2:OUT) ; also sheet 11
INPUT_BUS04: J13.S1(S1:OUT) ; also sheet 11
INPUT_BUS05: J13.V2(V2:OUT) ; also sheet 11
INPUT_BUS06: J14.E1(E1:OUT) ; also sheet 12
INPUT_BUS07: J14.J2(J2:OUT) ; also sheet 12
INPUT_BUS08: J14.L1(L1:OUT) ; also sheet 12
INPUT_BUS09: J14.P2(P2:OUT) ; also sheet 13
INPUT_BUS10: J14.S1(S1:OUT) ; also sheet 13
INPUT_BUS11: J14.V2(V2:OUT) ; also sheet 13
INT_RQST: J15.J2(J2:OUT) ; also sheet 8
IO_SKIP: J15.E1(E1:OUT) ; also sheet 7
IOP1_: H11.H2(IN2) ; also sheet 2,5
IOP2_: H11.N2(IN2) ; also sheet 2,5
IOP4_: H11.U2(IN2) ; also sheet 2,5
IRQ: J06.M2 J15.D2(J2:IN)
LINE_: J15.P2(P2:OUT) ; also sheet 29
LINE_IN: J06.V2 J15.K2(P2:IN)
MB00: H13.H2(IN2) ; also sheet 9,21,30
MB01: H13.N2(IN2) ; also sheet 9,21,30
MB02: H13.U2(IN2) ; also sheet 9,21,30
MB03: H14.N2(IN2) ; also sheet 4,5,9,21,27,29,30
MB03_: H14.H2(IN2) ; also sheet 4,5,6,7,8,9,22,30,32
MB04: H15.H2(IN2) ; also sheet 5,9,21,22,30
MB04_: H14.U2(IN2) ; also sheet 5,8,9,27,29,30,32
MB05: H15.U2(IN2) ; also sheet 5,7,9,21,27,30,32
MB05_: H15.N2(IN2) ; also sheet 5,8,9,22,29,30
MB06: H16.N2(IN2) ; also sheet 5,7,9,21,22,27,30
MB06_: H16.H2(IN2) ; also sheet 5,8,9,22,29,30,32
MB07: H17.H2(IN2) ; also sheet 5,7,9,21,22,26,27,30
MB07_: H16.U2(IN2) ; also sheet 5,8,9,22,26,28,29,30,32
MB08: H17.U2(IN2) ; also sheet 6,7,9,21,22,26,27,30
MB08_: H17.N2(IN2) ; also sheet 6,7,8,9,22,26,28,29,30,32
MB09: H18.H2(IN2) ; also sheet 2,5,6,9,21,22,27,29,30
MB10: H18.N2(IN2) ; also sheet 2,6,8,9,21,22,27,29,30
MB11: H18.U2(IN2) ; also sheet 2,6,9,21,22,27,29,30
ME05_: J13.U2(V2:IN4) ; also sheet 26
ME06_: J14.D1(E1:IN4) ; also sheet 22
ME07_: J14.H2(J2:IN4) ; also sheet 22
ME08_: J14.K1(L1:IN4) ; also sheet 22
ME09_: J14.N2(P2:IN4) ; also sheet 22
ME10_: J14.R1(S1:IN4) ; also sheet 22
ME11_: J14.U2(V2:IN4) ; also sheet 22
MEM_INCR: J08.T2 J20.A1(E1:IN)
MEMORY_INCREMENT: J20.E1(E1:OUT) ; also sheet 6,8
MP_INT_: J15.H2(J2:IN4) ; also sheet 30
MP_SKIP_: J15.D1(E1:IN4) ; also sheet 30
N$28: J14.S2(V2:IN2) J14.T2(V2:IN3)
N$131: J14.N1(S1:IN2) J14.P1(S1:IN3)
N$138: J14.L2(P2:IN2) J14.M2(P2:IN3)
N$139: J14.H1(L1:IN2) J14.J1(L1:IN3)
N$141: J14.E2(J2:IN2) J14.F2(J2:IN3)
N$142: J14.B1(E1:IN2) J14.C1(E1:IN3)
N$143: J13.S2(V2:IN2) J13.T2(V2:IN3)
N$144: J13.N1(S1:IN2) J13.P1(S1:IN3) J13.R1(S1:IN4)
N$145: J13.L2(P2:IN2) J13.M2(P2:IN3) J13.N2(P2:IN4)
N$146: J13.H1(L1:IN2) J13.J1(L1:IN3) J13.K1(L1:IN4)
N$147: J13.E2(J2:IN2) J13.F2(J2:IN3) J13.H2(J2:IN4)
N$148: J15.H1(L1:IN2) J15.J1(L1:IN3) J15.K1(L1:IN4)
N$150: J13.B1(E1:IN2) J13.C1(E1:IN3) J13.D1(E1:IN4)
N$200: J16.E2(J2:IN2) J16.F2(J2:IN3) J16.H2(J2:IN4)
N$201: J16.N1(S1:IN2) J16.P1(S1:IN3) J16.R1(S1:IN4)
N$202: J16.B1(E1:IN2) J16.C1(E1:IN3) J16.D1(E1:IN4)
N$203: J16.H1(L1:IN2) J16.J1(L1:IN3) J16.K1(L1:IN4)
N$204: J16.L2(P2:IN2) J16.M2(P2:IN3) J16.N2(P2:IN4)
N$205: J16.S2(V2:IN2) J16.T2(V2:IN3) J16.U2(V2:IN4)
N$206: J17.N1(S1:IN2) J17.P1(S1:IN3) J17.R1(S1:IN4)
N$207: J17.B1(E1:IN2) J17.C1(E1:IN3) J17.D1(E1:IN4)
N$208: J17.E2(J2:IN2) J17.F2(J2:IN3) J17.H2(J2:IN4)
N$209: J17.H1(L1:IN2) J17.J1(L1:IN3) J17.K1(L1:IN4)
N$210: J17.L2(P2:IN2) J17.M2(P2:IN3) J17.N2(P2:IN4)
N$211: J17.S2(V2:IN2) J17.T2(V2:IN3) J17.U2(V2:IN4)
N$212: J19.S2(V2:IN2) J19.T2(V2:IN3) J19.U2(V2:IN4)
N$213: J19.N1(S1:IN2) J19.P1(S1:IN3) J19.R1(S1:IN4)
N$214: J19.L2(P2:IN2) J19.M2(P2:IN3) J19.N2(P2:IN4)
N$215: J19.H1(L1:IN2) J19.J1(L1:IN3) J19.K1(L1:IN4)
N$216: J19.E2(J2:IN2) J19.F2(J2:IN3) J19.H2(J2:IN4)
N$217: J19.B1(E1:IN2) J19.C1(E1:IN3) J19.D1(E1:IN4)
N$218: J18.S2(V2:IN2) J18.T2(V2:IN3) J18.U2(V2:IN4)
N$219: J18.N1(S1:IN2) J18.P1(S1:IN3) J18.R1(S1:IN4)
N$220: J18.L2(P2:IN2) J18.M2(P2:IN3) J18.N2(P2:IN4)
N$221: J18.H1(L1:IN2) J18.J1(L1:IN3) J18.K1(L1:IN4)
N$222: J18.E2(J2:IN2) J18.F2(J2:IN3) J18.H2(J2:IN4)
N$223: J18.B1(E1:IN2) J18.C1(E1:IN3) J18.D1(E1:IN4)
N$243: J15.L2(P2:IN2) J15.M2(P2:IN3) J15.N2(P2:IN4)
N$245: J15.S2(V2:IN2) J15.T2(V2:IN3) J15.U2(V2:IN4)
N$246: J15.N1(S1:IN2) J15.P1(S1:IN3) J15.R1(S1:IN4)
N$250: J20.B1(E1:IN2) J20.C1(E1:IN3) J20.D1(E1:IN4)
N$253: J20.E2(J2:IN2) J20.F2(J2:IN3) J20.H2(J2:IN4)
N$254: J20.H1(L1:IN2) J20.J1(L1:IN3) J20.K1(L1:IN4)
N$259: J20.N1(S1:IN2) J20.P1(S1:IN3) J20.R1(S1:IN4)
N$260: J20.L2(P2:IN2) J20.M2(P2:IN3) J20.N2(P2:IN4)
N$261: J20.S2(V2:IN2) J20.T2(V2:IN3) J20.U2(V2:IN4)
PWR_LOW_: J15.E2(J2:IN2) ; also sheet 32
PWR_SKIP_: J15.C1(E1:IN3) ; also sheet 32
RUN_: H19.H2(IN2) ; also sheet 2
SKIPB: J06.K2 J15.A1(E1:IN)
TS1_: H12.N2(IN2) ; also sheet 2
TS3_: H12.H2(IN2) ; also sheet 2
TT_INST_: H19.N2(IN2) ; also sheet 2,9,29
UINT_: J15.F2(J2:IN3) ; also sheet 26
WC_OVERFLOW_: H19.U2(IN2) ; also sheet 8
Unconnected: H20.R2(SLOW) H20.S2(OUT) H20.T2(IN1) H20.U2(IN2) H20.V2(IN3) J08.V2 J15.B1(E1:IN2)

### Notes on the sheet
- 8i-00009?
- D-BS-8i-0-10 I/O Level Converter
- 1. For ka8i, substitute D-BS-ka8i-0-1 for this print.
- 2. G717 is always placed at the end of the I/O bus.
- (Place G717 in location J02 if no options on the I/O bus.)

## Sheet 15 of 40
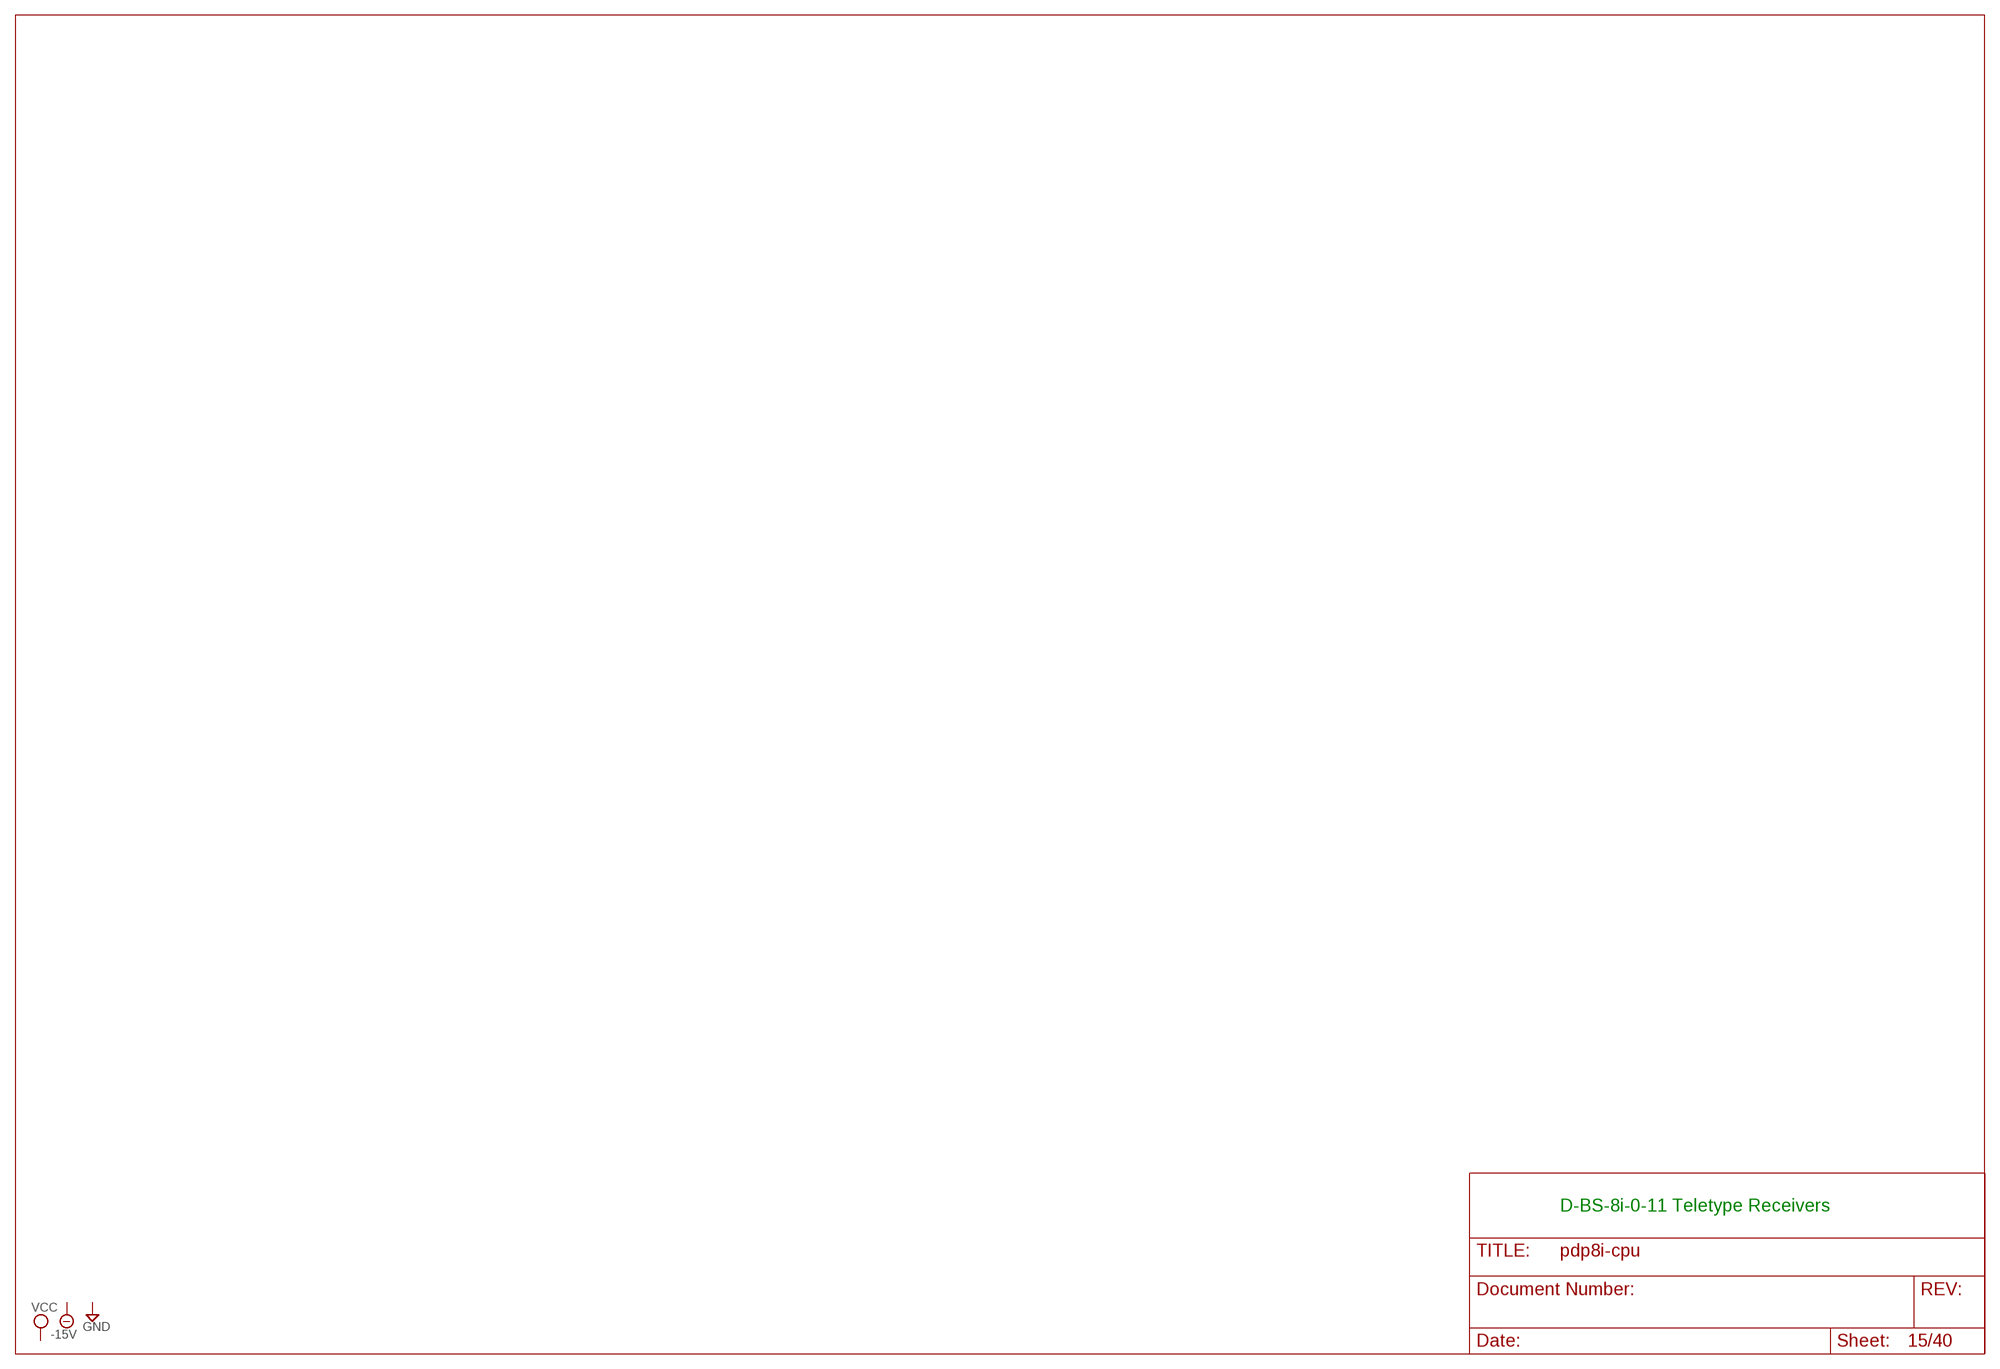
[diagram p15: schematic, sheet 15]

### Notes on the sheet
- D-BS-8i-0-11 Teletype Receivers

## Sheet 16 of 40
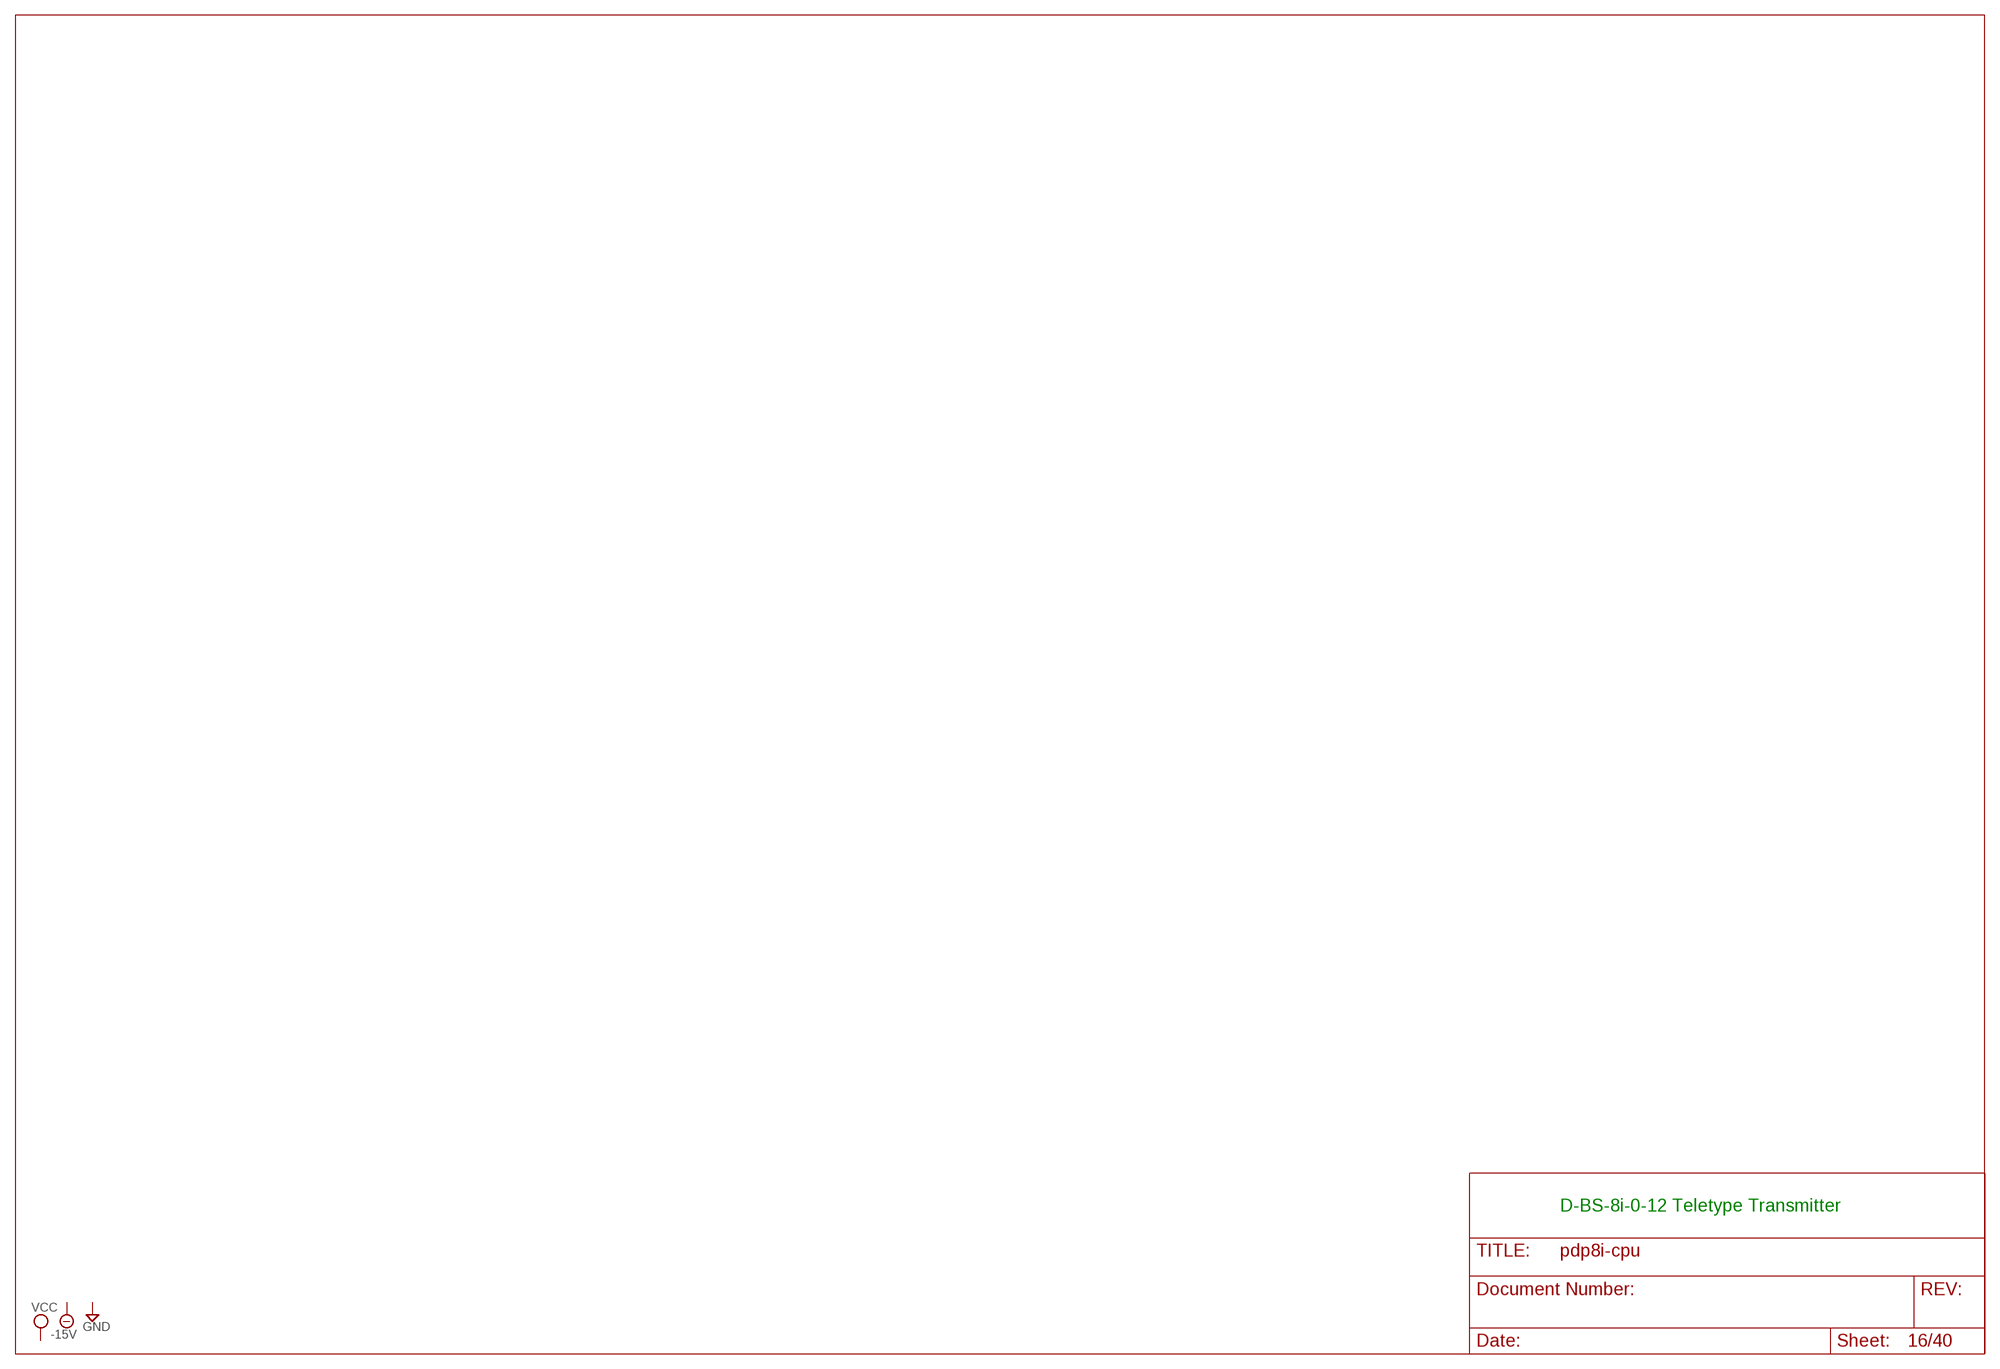
[diagram p16: schematic, sheet 16]

### Notes on the sheet
- D-BS-8i-0-12 Teletype Transmitter

## Sheet 17 of 40
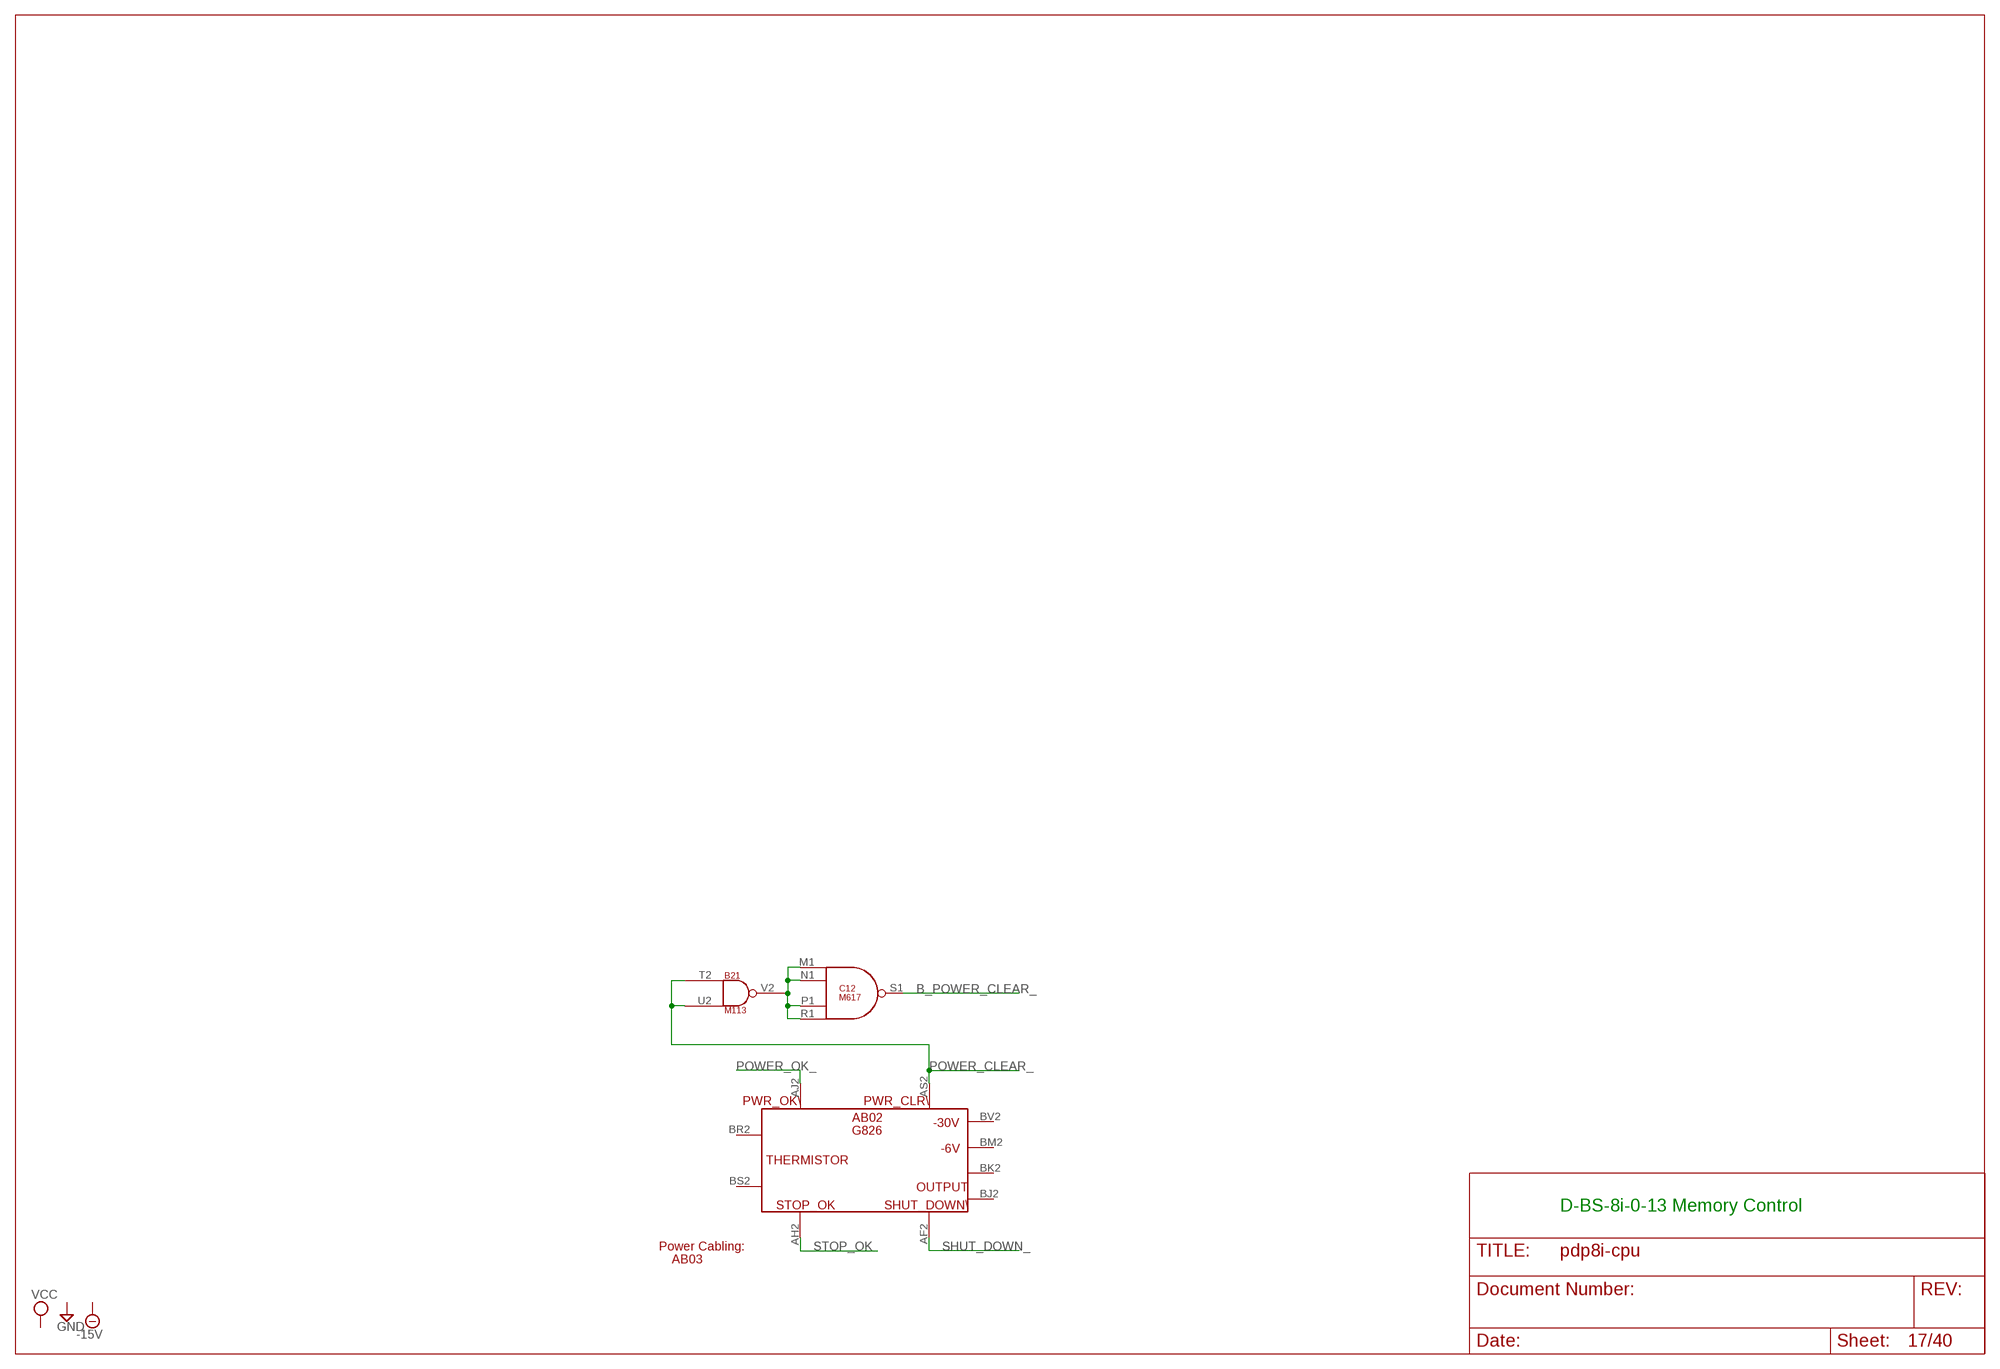
[diagram p17: schematic, sheet 17]

### Parts
AB02  G826  [H807-2]
AB03  G792  [H807-2]
B21  M113  [H807]

### Nets
B_POWER_CLEAR_: C12.S1(S1:OUT) ; also sheet 2,27
N$270: B21.V2(V2:OUT) C12.M1(S1:IN1) C12.N1(S1:IN2) C12.P1(S1:IN3) C12.R1(S1:IN4)
POWER_CLEAR_: AB02.AS2 B21.T2(V2:IN1) B21.U2(V2:IN2)
POWER_OK_: AB02.AJ2 ; also sheet 2
SHUT_DOWN_: AB02.AF2 ; also sheet 32
STOP_OK: AB02.AH2 ; also sheet 2,32
Unconnected: AB02.BJ2 AB02.BK2 AB02.BM2(-6V) AB02.BR2 AB02.BS2 AB02.BV2(-30V) B21.A1(C1:IN1) B21.B1(C1:IN2) B21.C1(C1:OUT) B21.D1(F1:IN1) B21.D2(F2:IN1) B21.E1(F1:IN2) B21.E2(F2:IN2) B21.F1(F1:OUT) B21.F2(F2:OUT) B21.H1(K1:IN1) B21.H2(K2:IN1) B21.J1(K1:IN2) B21.J2(K2:IN2) B21.K1(K1:OUT) B21.K2(K2:OUT) B21.L1(N1:IN1) B21.M1(N1:IN2) B21.N1(N1:OUT) B21.U1

### Notes on the sheet
- D-BS-8i-0-13 Memory Control
- Power Cabling:

## Sheet 18 of 40
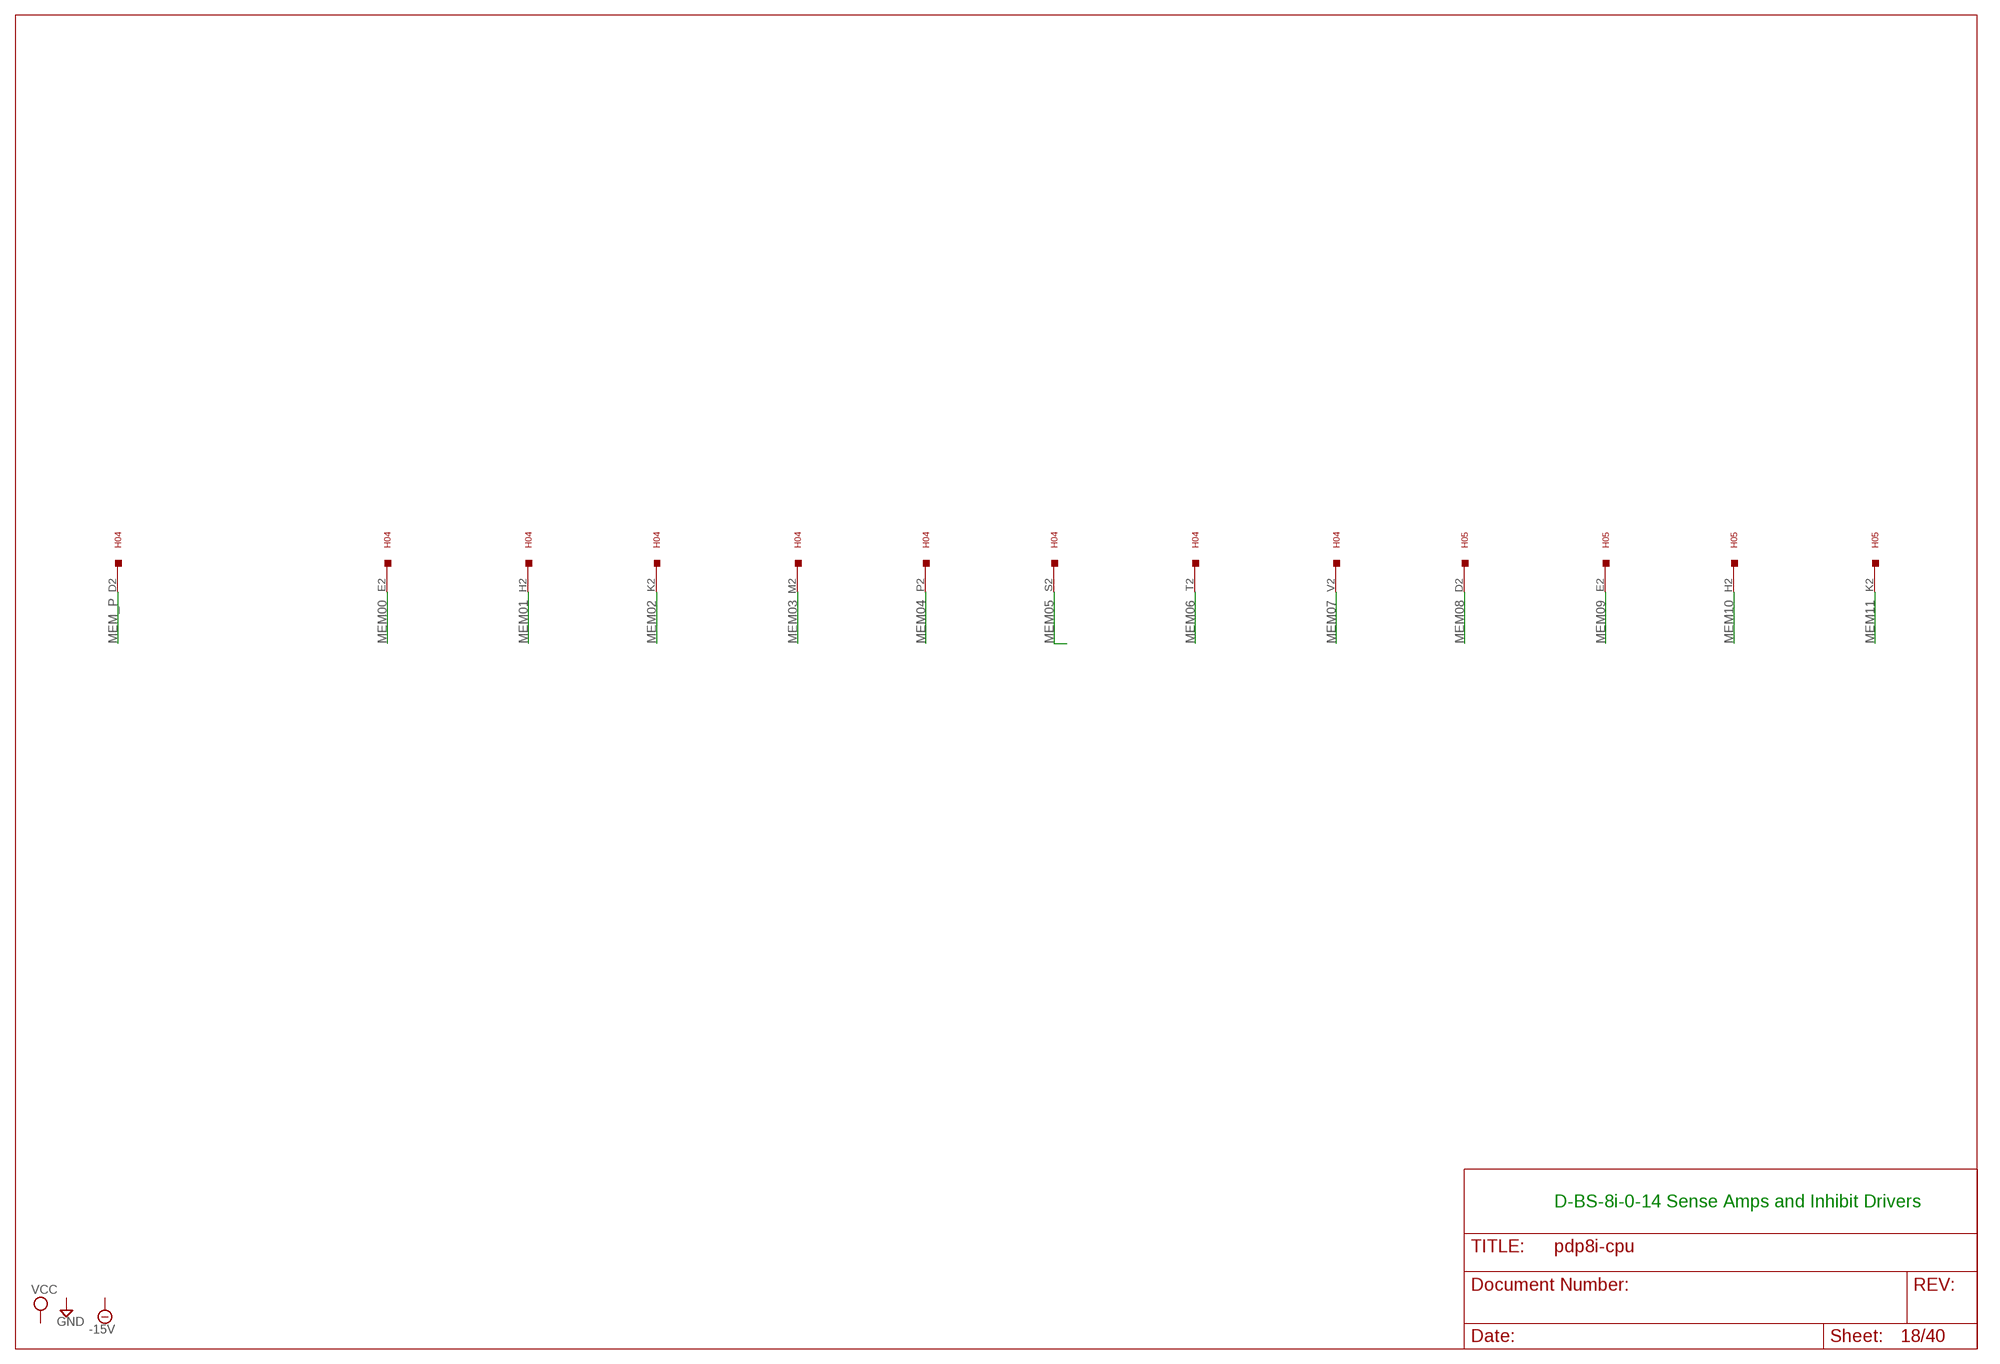
[diagram p18: schematic, sheet 18]

### Parts
H04  W011  [H807]

### Nets
MEM00: H04.E2 ; also sheet 4,10,29,31
MEM01: H04.H2 ; also sheet 4,10,31
MEM02: H04.K2 ; also sheet 4,10,31
MEM03: H04.M2 ; also sheet 11,31
MEM04: H04.P2 ; also sheet 11,31
MEM05: H04.S2 ; also sheet 11,31
MEM06: H04.T2 ; also sheet 12,31
MEM07: H04.V2 ; also sheet 12,31
MEM08: H05.D2 ; also sheet 12,31
MEM09: H05.E2 ; also sheet 13,29,31
MEM10: H05.H2 ; also sheet 13,31
MEM11: H05.K2 ; also sheet 13,31
MEM_P: H04.D2 ; also sheet 31

### Notes on the sheet
- D-BS-8i-0-14 Sense Amps and Inhibit Drivers

## Sheet 19 of 40
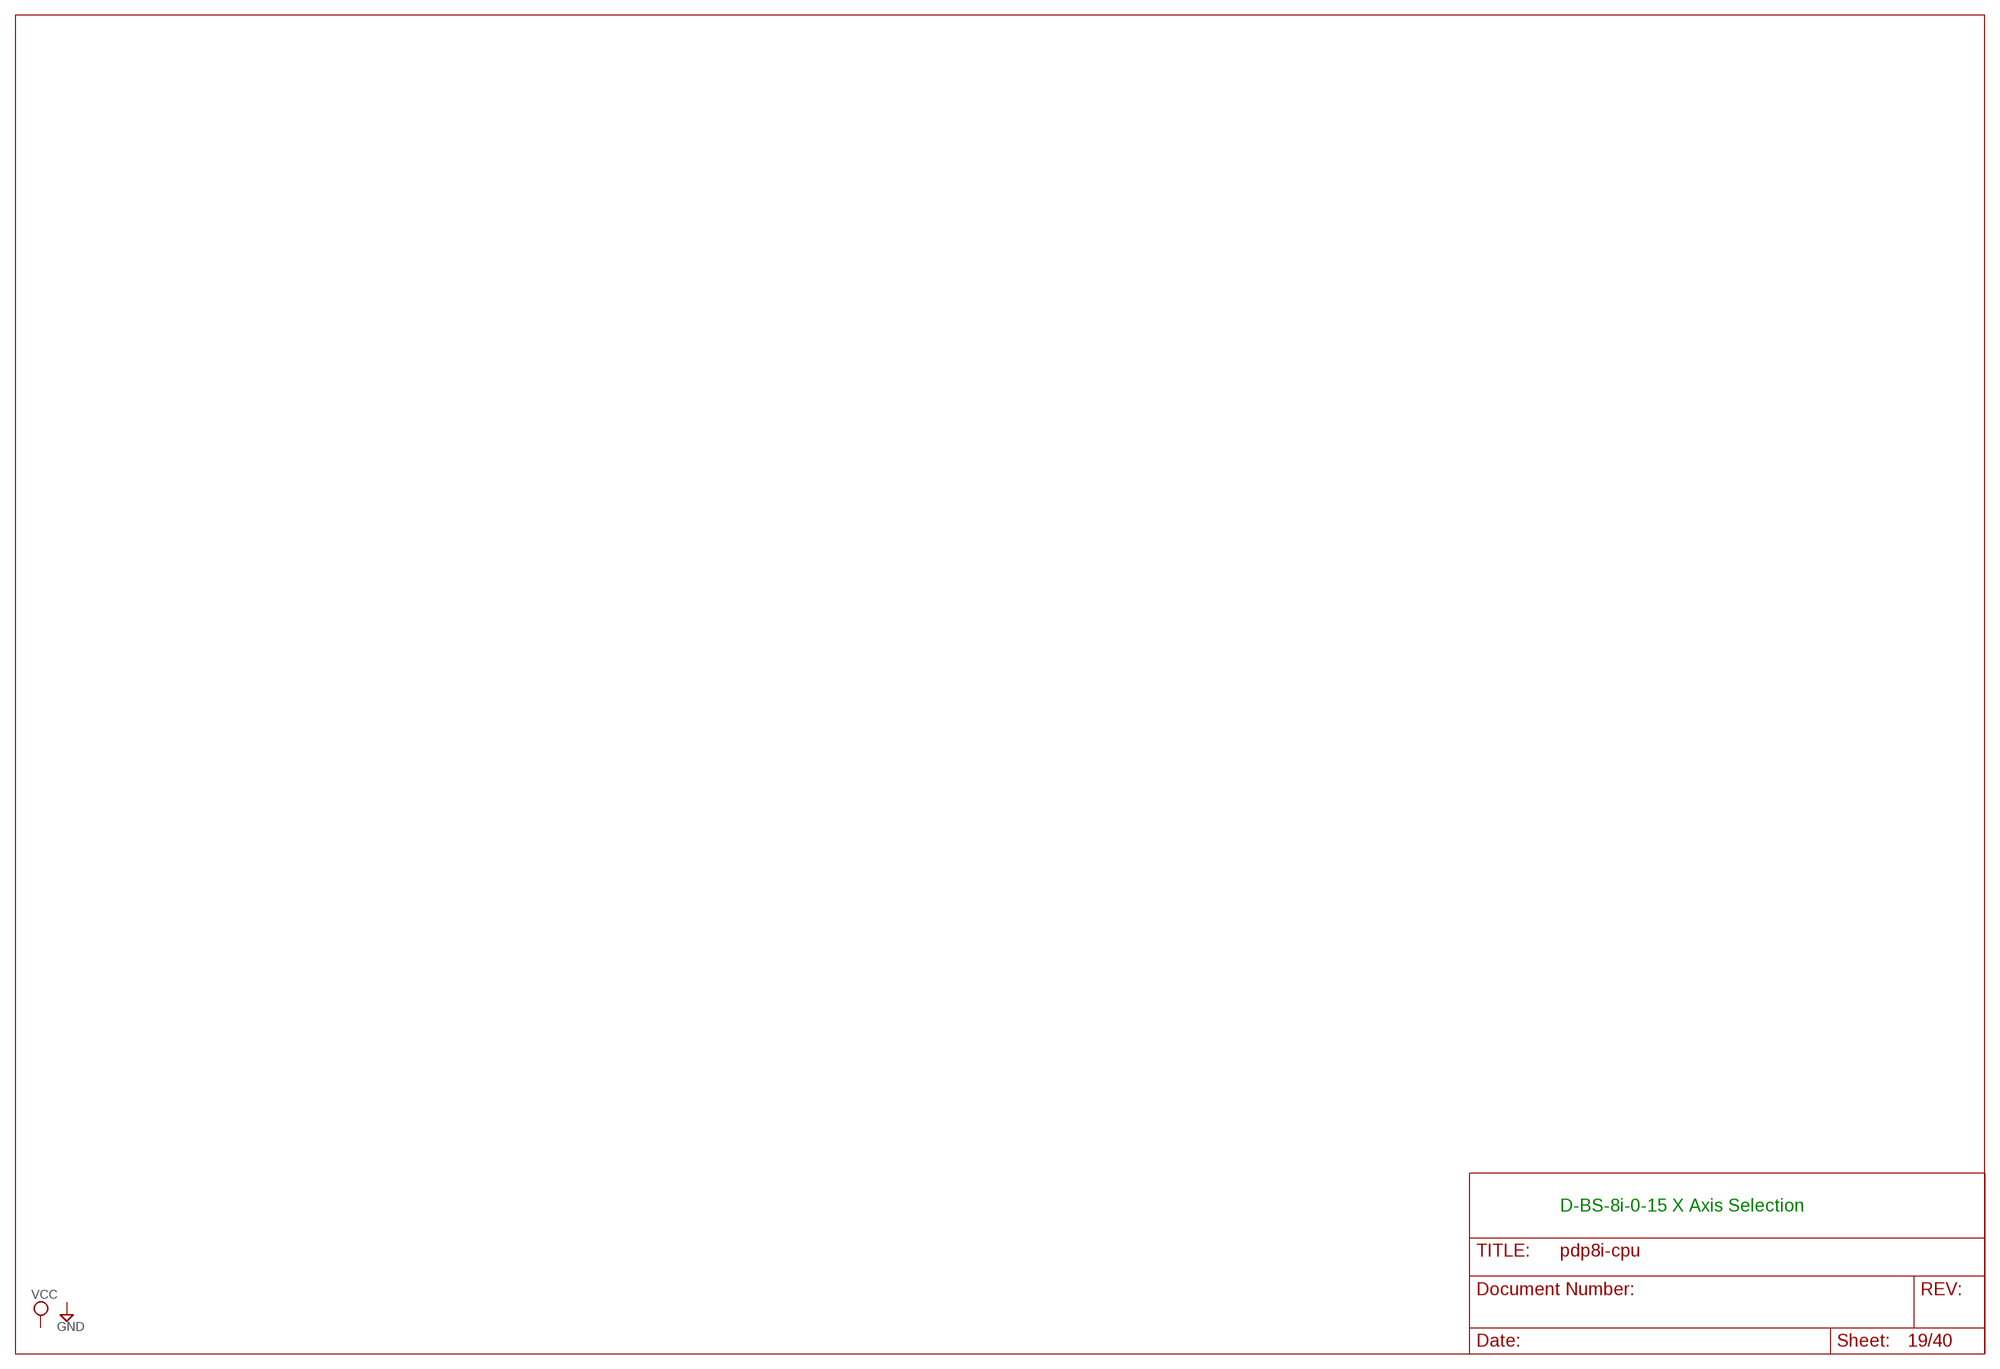
[diagram p19: schematic, sheet 19]

### Notes on the sheet
- D-BS-8i-0-15 X Axis Selection

## Sheet 20 of 40
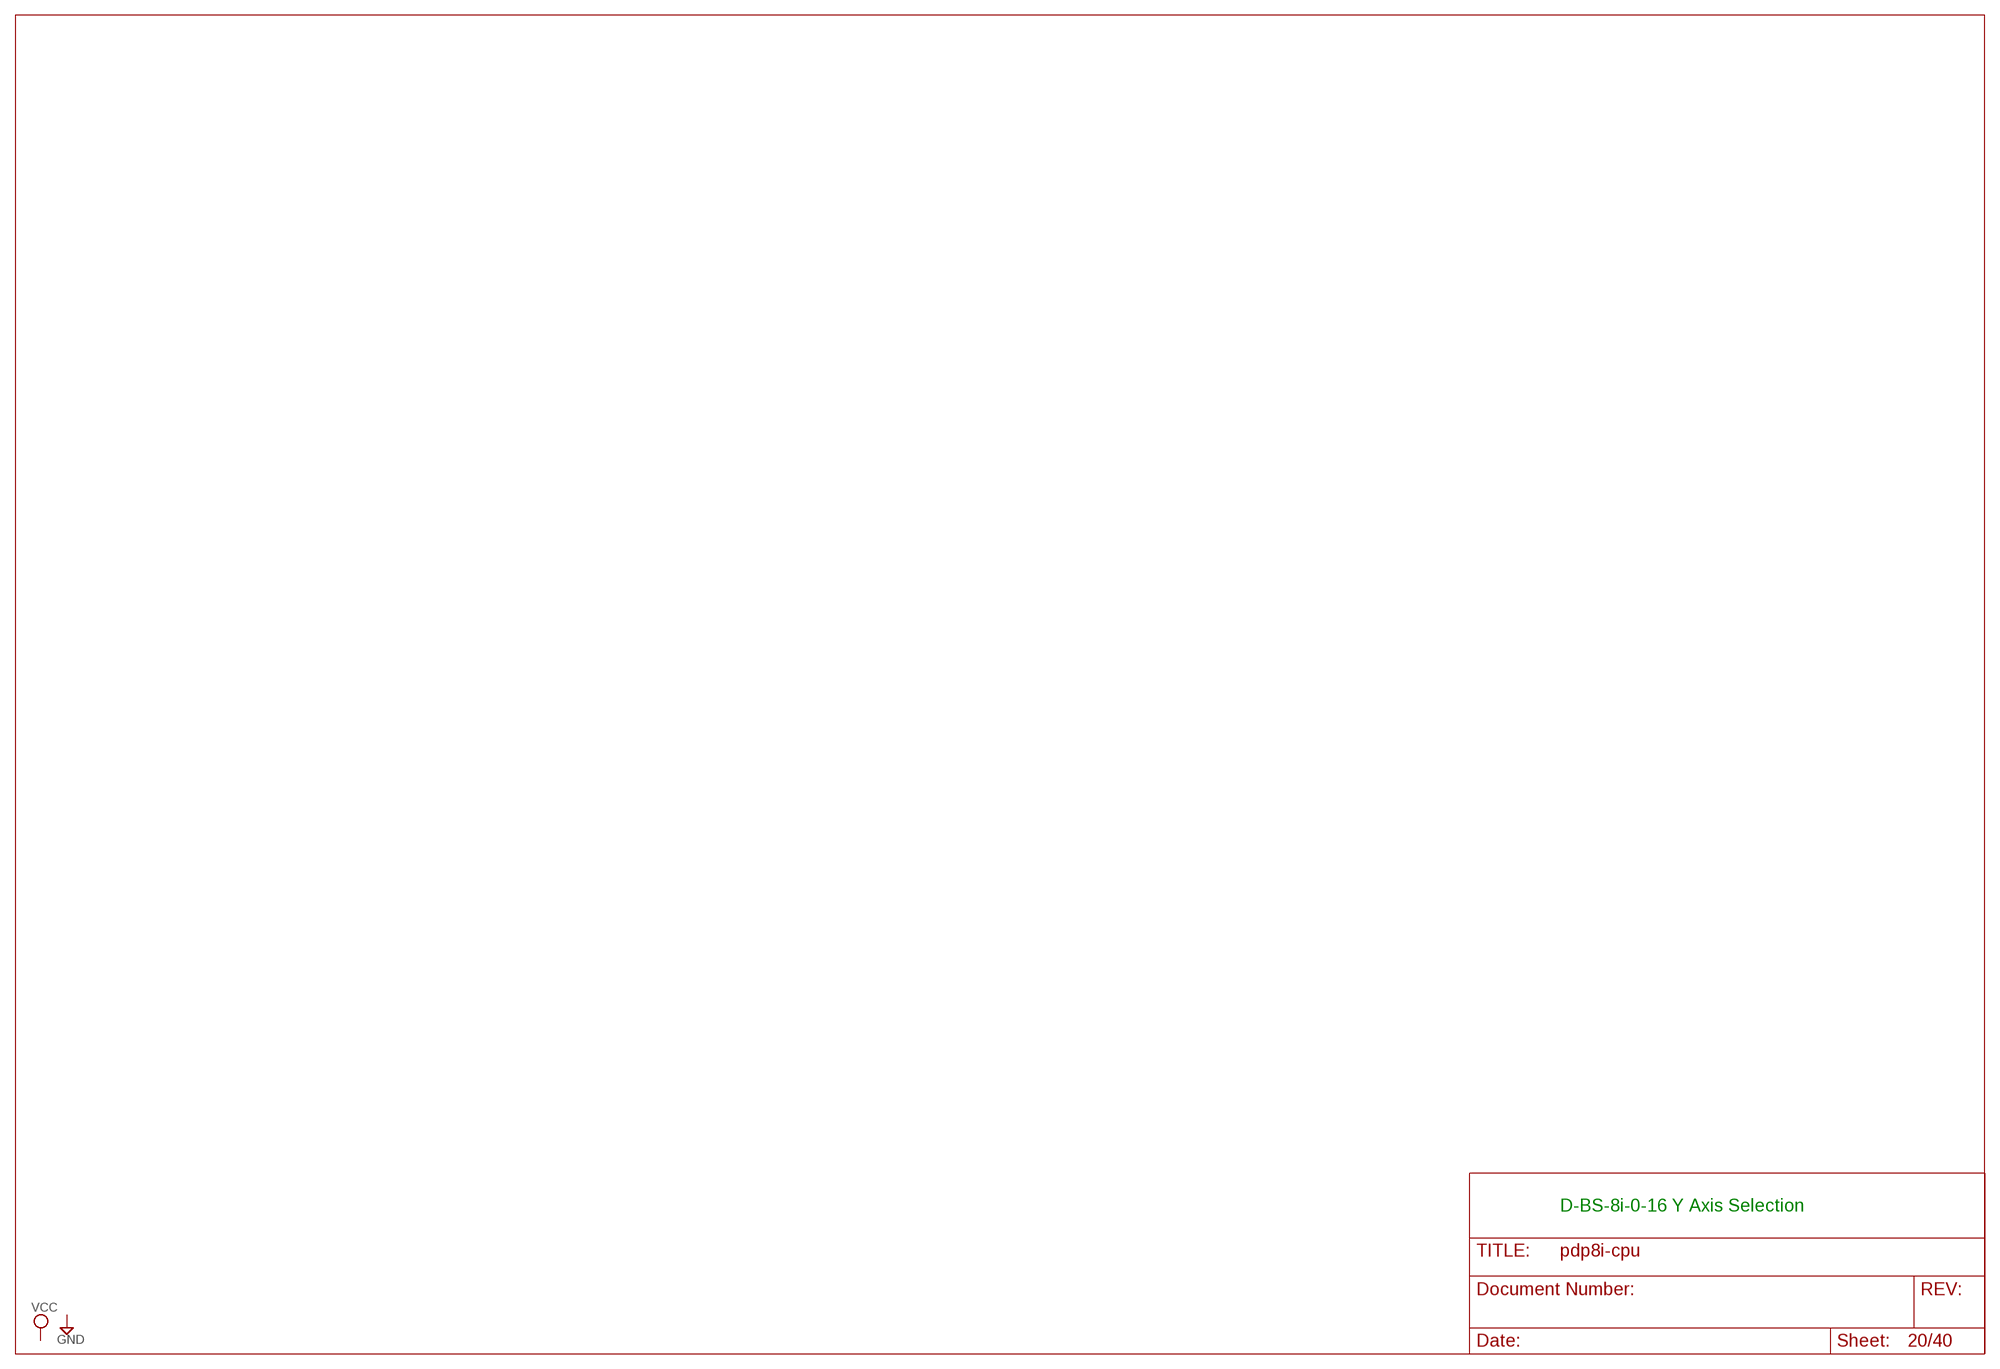
[diagram p20: schematic, sheet 20]

### Notes on the sheet
- D-BS-8i-0-16 Y Axis Selection

## Sheet 21 of 40
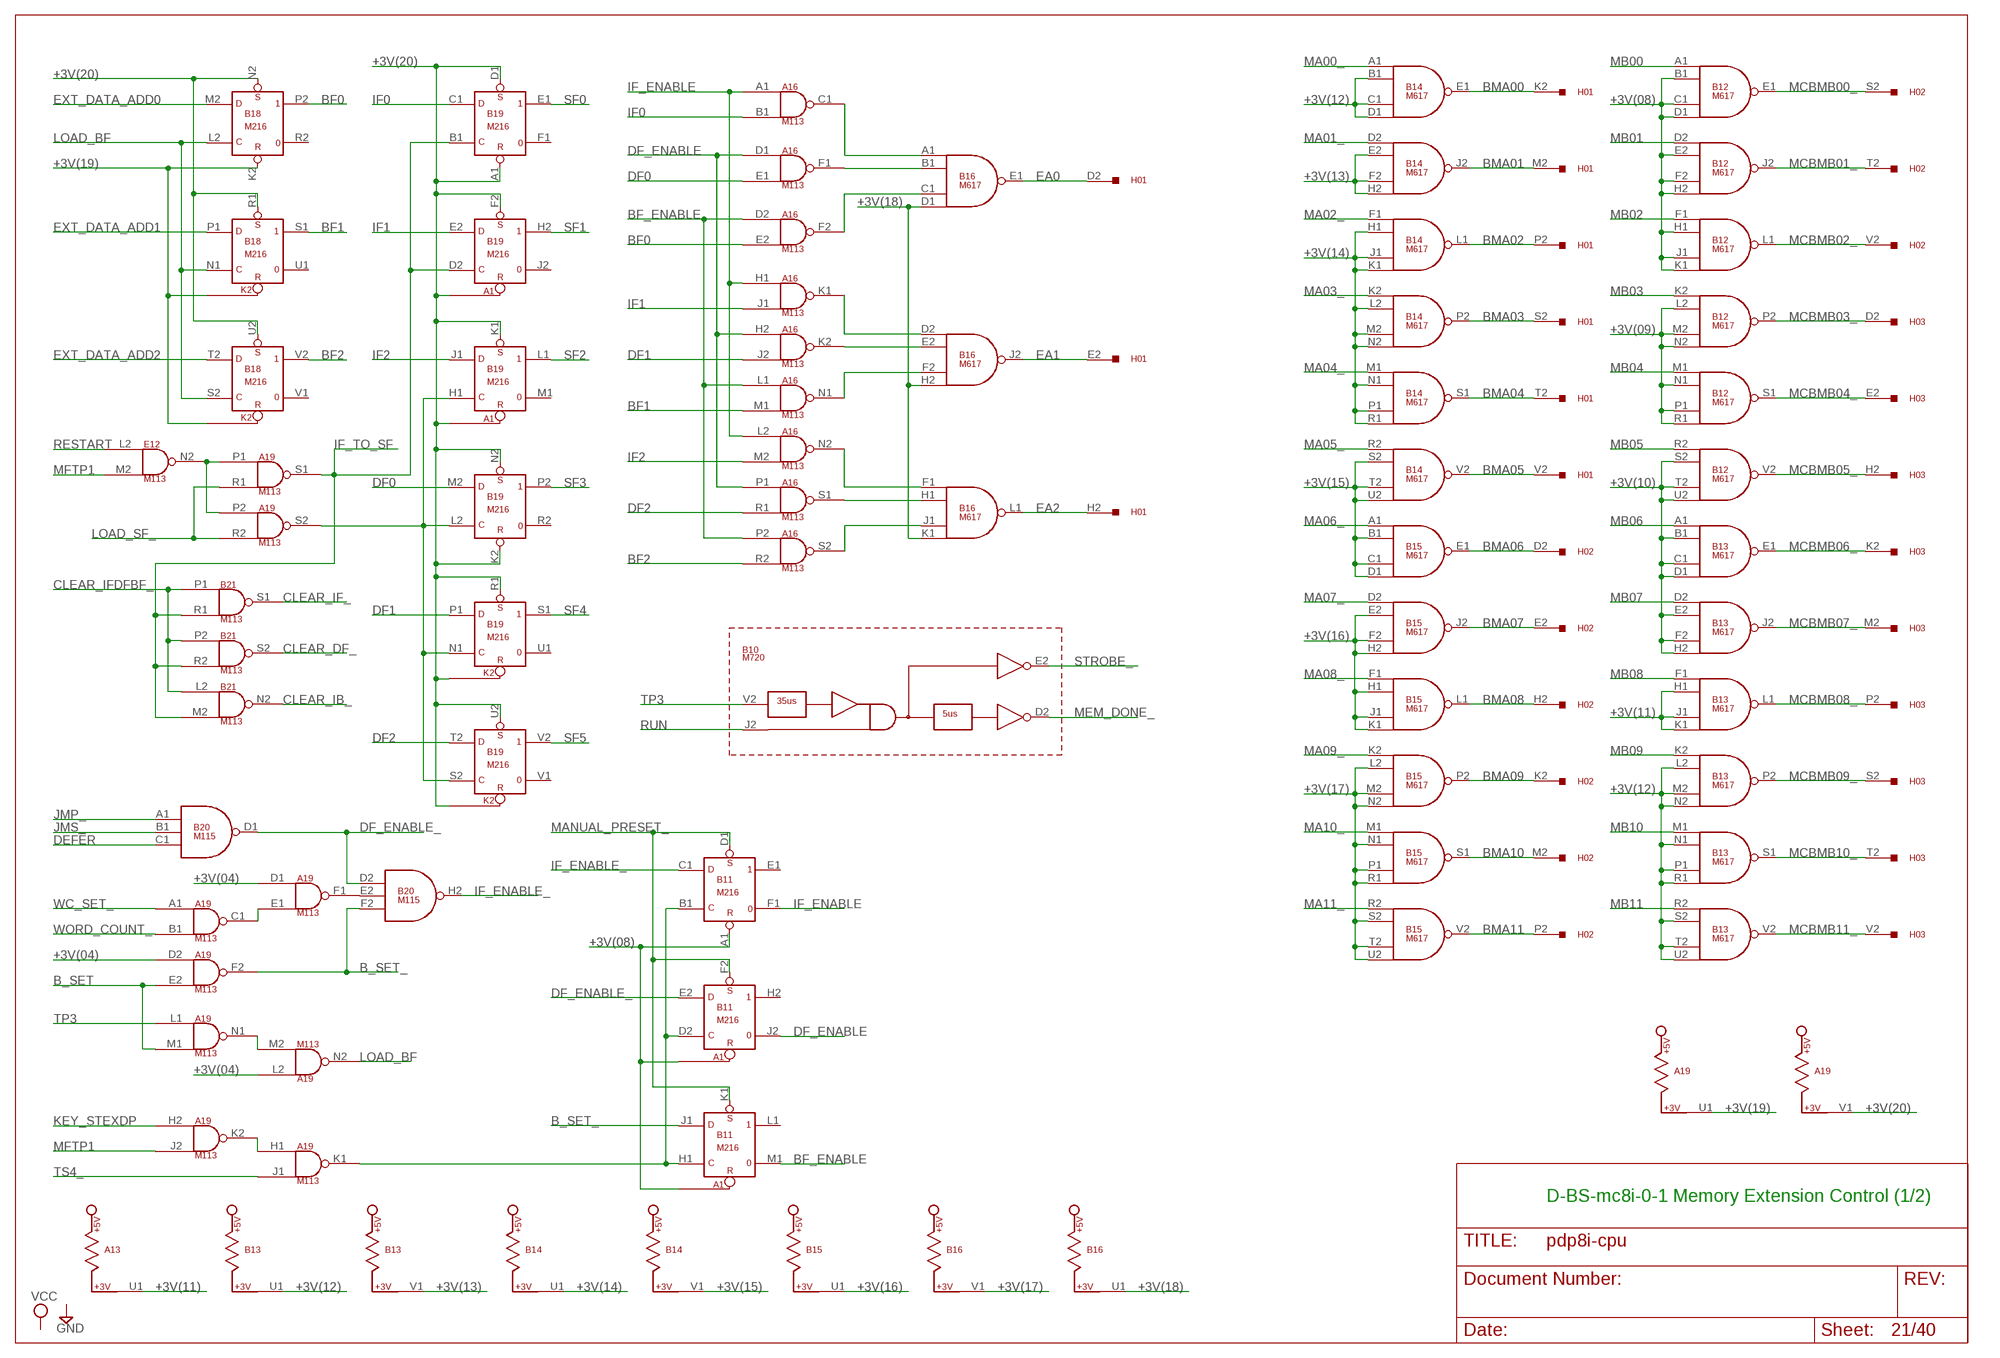
[diagram p21: schematic, sheet 21]

### Parts
A13  M113  [H807]
A16  M113  [H807]
A19  M113  [H807]
B10  M720  [H807]
B11  M216  [H807]
B12  M617  [H807]
B13  M617  [H807]
B14  M617  [H807]
B15  M617  [H807]
B16  M617  [H807]
B18  M216  [H807]
B19  M216  [H807]
B20  M115  [H807]
H01  W011  [H807]
H02  W011  [H807]
H03  W011  [H807]

### Nets
+3V(04): A19.D1(F1:IN1) A19.D2(F2:IN1) A19.L2(N2:IN1) ; also sheet 22
+3V(08): B11.A1(E1:R) B12.B1(E1:IN2) B12.C1(E1:IN3) B12.D1(E1:IN4) B12.E2(J2:IN2) B12.F2(J2:IN3) B12.H1(L1:IN2) B12.H2(J2:IN4) B12.J1(L1:IN3) B12.K1(L1:IN4) ; also sheet 22
+3V(09): B12.L2(P2:IN2) B12.M2(P2:IN3) B12.N1(S1:IN2) B12.N2(P2:IN4) B12.P1(S1:IN3) B12.R1(S1:IN4) ; also sheet 22
+3V(10): B12.S2(V2:IN2) B12.T2(V2:IN3) B12.U2(V2:IN4) B13.B1(E1:IN2) B13.C1(E1:IN3) B13.D1(E1:IN4) B13.E2(J2:IN2) B13.F2(J2:IN3) B13.H2(J2:IN4) ; also sheet 22
+3V(11): A13.U1 B13.H1(L1:IN2) B13.J1(L1:IN3) B13.K1(L1:IN4)
+3V(12): B13.L2(P2:IN2) B13.M2(P2:IN3) B13.N1(S1:IN2) B13.N2(P2:IN4) B13.P1(S1:IN3) B13.R1(S1:IN4) B13.S2(V2:IN2) B13.T2(V2:IN3) B13.U1 B13.U2(V2:IN4) B14.B1(E1:IN2) B14.C1(E1:IN3) B14.D1(E1:IN4)
+3V(13): B13.V1 B14.E2(J2:IN2) B14.F2(J2:IN3) B14.H2(J2:IN4)
+3V(14): B14.H1(L1:IN2) B14.J1(L1:IN3) B14.K1(L1:IN4) B14.L2(P2:IN2) B14.M2(P2:IN3) B14.N1(S1:IN2) B14.N2(P2:IN4) B14.P1(S1:IN3) B14.R1(S1:IN4) B14.U1
+3V(15): B14.S2(V2:IN2) B14.T2(V2:IN3) B14.U2(V2:IN4) B14.V1 B15.B1(E1:IN2) B15.C1(E1:IN3) B15.D1(E1:IN4)
+3V(16): B15.E2(J2:IN2) B15.F2(J2:IN3) B15.H1(L1:IN2) B15.H2(J2:IN4) B15.J1(L1:IN3) B15.K1(L1:IN4) B15.U1
+3V(17): B15.L2(P2:IN2) B15.M2(P2:IN3) B15.N1(S1:IN2) B15.N2(P2:IN4) B15.P1(S1:IN3) B15.R1(S1:IN4) B15.S2(V2:IN2) B15.T2(V2:IN3) B15.U2(V2:IN4) B16.V1
+3V(18): B16.D1(E1:IN4) B16.H2(J2:IN4) B16.K1(L1:IN4) B16.U1
+3V(19): A19.U1 B18.K2(P2:R) ; also sheet 22
+3V(20): A19.V1 B18.N2(P2:S) B18.R1(S1:S) B18.U2(V2:S) B19.A1(E1:R) B19.D1(E1:S) B19.F2(H2:S) B19.K1(L1:S) B19.K2(P2:R) B19.N2(P2:S) B19.R1(S1:S) B19.U2(V2:S)
B_SET: A19.E2(F2:IN2) A19.M1(N1:IN2) ; also sheet 4
B_SET_: A19.F2(F2:OUT) B11.J1(L1:D) B20.F2(H2:IN3)
BF0: A16.E2(F2:IN2) B18.P2
BF1: A16.M1(N1:IN2) B18.S1
BF2: A16.R2(S2:IN2) B18.V2
BF_ENABLE: A16.D2(F2:IN1) A16.L1(N1:IN1) A16.P2(S2:IN1) B11.M1
BMA00: B14.E1(E1:OUT) H01.K2
BMA01: B14.J2(J2:OUT) H01.M2
BMA02: B14.L1(L1:OUT) H01.P2
BMA03: B14.P2(P2:OUT) H01.S2
BMA04: B14.S1(S1:OUT) H01.T2
BMA05: B14.V2(V2:OUT) H01.V2
BMA06: B15.E1(E1:OUT) H02.D2
BMA07: B15.J2(J2:OUT) H02.E2
BMA08: B15.L1(L1:OUT) H02.H2
BMA09: B15.P2(P2:OUT) H02.K2
BMA10: B15.S1(S1:OUT) H02.M2
BMA11: B15.V2(V2:OUT) H02.P2
CLEAR_DF_: B21.S2(S2:OUT) ; also sheet 22
CLEAR_IB_: B21.N2(N2:OUT) ; also sheet 22
CLEAR_IF_: B21.S1(S1:OUT) ; also sheet 22,26
CLEAR_IFDFBF_: B21.L2(N2:IN1) B21.P1(S1:IN1) B21.P2(S2:IN1) ; also sheet 8
DEFER: B20.C1(D1:IN3) ; also sheet 4,5,6,7
DF0: A16.E1(F1:IN2) B19.M2(P2:D) ; also sheet 22
DF1: A16.J2(K2:IN2) B19.P1(S1:D) ; also sheet 22
DF2: A16.R1(S1:IN2) B19.T2(V2:D) ; also sheet 22
DF_ENABLE: A16.D1(F1:IN1) A16.H2(K2:IN1) A16.P1(S1:IN1) B11.J2
DF_ENABLE_: B11.E2(H2:D) B20.D1(D1:OUT) B20.D2(H2:IN1)
EA0: B16.E1(E1:OUT) H01.D2
EA1: B16.J2(J2:OUT) H01.E2
EA2: B16.L1(L1:OUT) H01.H2
EXT_DATA_ADD0: B18.M2(P2:D) ; also sheet 14
EXT_DATA_ADD1: B18.P1(S1:D) ; also sheet 14
EXT_DATA_ADD2: B18.T2(V2:D) ; also sheet 14
IF0: A16.B1(C1:IN2) B19.C1(E1:D) ; also sheet 22
IF1: A16.J1(K1:IN2) B19.E2(H2:D) ; also sheet 22
IF2: A16.M2(N2:IN2) B19.J1(L1:D) ; also sheet 22
IF_ENABLE: A16.A1(C1:IN1) A16.H1(K1:IN1) A16.L2(N2:IN1) B11.F1
IF_ENABLE_: B11.C1(E1:D) B20.H2(H2:OUT)
IF_TO_SF: A19.S1(S1:OUT) B19.B1(E1:C) B19.D2(H2:C) B21.M2(N2:IN2) B21.R1(S1:IN2) B21.R2(S2:IN2) ; also sheet 26
JMP_: B20.A1(D1:IN1) ; also sheet 4,5,22
JMS_: B20.B1(D1:IN2) ; also sheet 4,22
KEY_STEXDP: A19.H2(K2:IN1) ; also sheet 2,5,7
LOAD_BF: A19.N2(N2:OUT) B18.L2(P2:C) B18.N1(S1:C) B18.S2(V2:C)
LOAD_SF_: A19.R1(S1:IN2) A19.R2(S2:IN2) ; also sheet 8
MA00_: B14.A1(E1:IN1) ; also sheet 6,9
MA01_: B14.D2(J2:IN1) ; also sheet 6,9
MA02_: B14.F1(L1:IN1) ; also sheet 6,9
MA03_: B14.K2(P2:IN1) ; also sheet 6,9
MA04_: B14.M1(S1:IN1) ; also sheet 6,9
MA05_: B14.R2(V2:IN1) ; also sheet 6,9
MA06_: B15.A1(E1:IN1) ; also sheet 6,9
MA07_: B15.D2(J2:IN1) ; also sheet 6,9
MA08_: B15.F1(L1:IN1) ; also sheet 9
MA09_: B15.K2(P2:IN1) ; also sheet 9
MA10_: B15.M1(S1:IN1) ; also sheet 9
MA11_: B15.R2(V2:IN1) ; also sheet 9
MANUAL_PRESET_: B11.D1(E1:S) B11.F2(H2:S) B11.K1(L1:S) ; also sheet 2,4,8,29
MB00: B12.A1(E1:IN1) ; also sheet 9,14,30
MB01: B12.D2(J2:IN1) ; also sheet 9,14,30
MB02: B12.F1(L1:IN1) ; also sheet 9,14,30
MB03: B12.K2(P2:IN1) ; also sheet 4,5,9,14,27,29,30
MB04: B12.M1(S1:IN1) ; also sheet 5,9,14,22,30
MB05: B12.R2(V2:IN1) ; also sheet 5,7,9,14,27,30,32
MB06: B13.A1(E1:IN1) ; also sheet 5,7,9,14,22,27,30
MB07: B13.D2(J2:IN1) ; also sheet 5,7,9,14,22,26,27,30
MB08: B13.F1(L1:IN1) ; also sheet 6,7,9,14,22,26,27,30
MB09: B13.K2(P2:IN1) ; also sheet 2,5,6,9,14,22,27,29,30
MB10: B13.M1(S1:IN1) ; also sheet 2,6,8,9,14,22,27,29,30
MB11: B13.R2(V2:IN1) ; also sheet 2,6,9,14,22,27,29,30
MCBMB00_: B12.E1(E1:OUT) H02.S2
MCBMB01_: B12.J2(J2:OUT) H02.T2
MCBMB02_: B12.L1(L1:OUT) H02.V2
MCBMB03_: B12.P2(P2:OUT) H03.D2
MCBMB04_: B12.S1(S1:OUT) H03.E2
MCBMB05_: B12.V2(V2:OUT) H03.H2
MCBMB06_: B13.E1(E1:OUT) H03.K2
MCBMB07_: B13.J2(J2:OUT) H03.M2
MCBMB08_: B13.L1(L1:OUT) H03.P2
MCBMB09_: B13.P2(P2:OUT) H03.S2
MCBMB10_: B13.S1(S1:OUT) H03.T2
MCBMB11_: B13.V2(V2:OUT) H03.V2
MEM_DONE_: B10.D2 ; also sheet 2,8,29
MFTP1: A19.J2(K2:IN2) E12.M2(N2:IN2) ; also sheet 2,7
N$53: A19.P1(S1:IN1) A19.P2(S2:IN1) E12.N2(N2:OUT)
N$263: A19.C1(C1:OUT) A19.E1(F1:IN2)
N$264: A19.S2(S2:OUT) B19.H1(L1:C) B19.L2(P2:C) B19.N1(S1:C) B19.S2(V2:C)
N$403: A19.F1(F1:OUT) B20.E2(H2:IN2)
N$407: A19.M2(N2:IN2) A19.N1(N1:OUT)
N$408: A19.H1(K1:IN1) A19.K2(K2:OUT)
N$409: A16.F2(F2:OUT) B16.C1(E1:IN3)
N$410: A16.F1(F1:OUT) B16.B1(E1:IN2)
N$411: A16.C1(C1:OUT) B16.A1(E1:IN1)
N$412: A19.K1(K1:OUT) B11.B1(E1:C) B11.D2(H2:C) B11.H1(L1:C)
N$413: A16.K1(K1:OUT) B16.D2(J2:IN1)
N$414: A16.K2(K2:OUT) B16.E2(J2:IN2)
N$415: A16.N1(N1:OUT) B16.F2(J2:IN3)
N$416: A16.N2(N2:OUT) B16.F1(L1:IN1)
N$417: A16.S1(S1:OUT) B16.H1(L1:IN2)
N$418: A16.S2(S2:OUT) B16.J1(L1:IN3)
RESTART: E12.L2(N2:IN1) ; also sheet 32
RUN: B10.J2 ; also sheet 2
SF0: B19.E1 ; also sheet 22
SF1: B19.H2 ; also sheet 22
SF2: B19.L1 ; also sheet 22
SF3: B19.P2 ; also sheet 22
SF4: B19.S1 ; also sheet 22
SF5: B19.V2 ; also sheet 22
STROBE_: B10.E2 ; also sheet 2,8
TP3: A19.L1(N1:IN1) B10.V2 ; also sheet 2,7,22,26,27,29,30
TS4_: A19.J1(K1:IN2) ; also sheet 2
WC_SET_: A19.A1(C1:IN1) ; also sheet 4
WORD_COUNT_: A19.B1(C1:IN2) ; also sheet 4,8
Unconnected: A13.V1 A16.U1 A16.V1 B10.S2(IN1) B10.T2(IN2) B10.U2(OUT) B11.E1 B11.H2 B11.L1 B11.S2(V2:C) B11.T2(V2:D) B11.U2(V2:S) B11.V1 B11.V2 B12.U1 B12.V1 B15.V1 B16.M1(S1:IN1) B16.N1(S1:IN2) B16.P1(S1:IN3) B16.R1(S1:IN4) B16.R2(V2:IN1) B16.S1(S1:OUT) B16.S2(V2:IN2) B16.T2(V2:IN3) B16.U2(V2:IN4) B16.V2(V2:OUT) B18.R2 B18.U1 B18.V1 B19.F1 B19.J2 B19.M1 B19.R2 B19.U1 B19.V1

### Notes on the sheet
- D-BS-mc8i-0-1 Memory Extension Control (1/2)

## Sheet 22 of 40
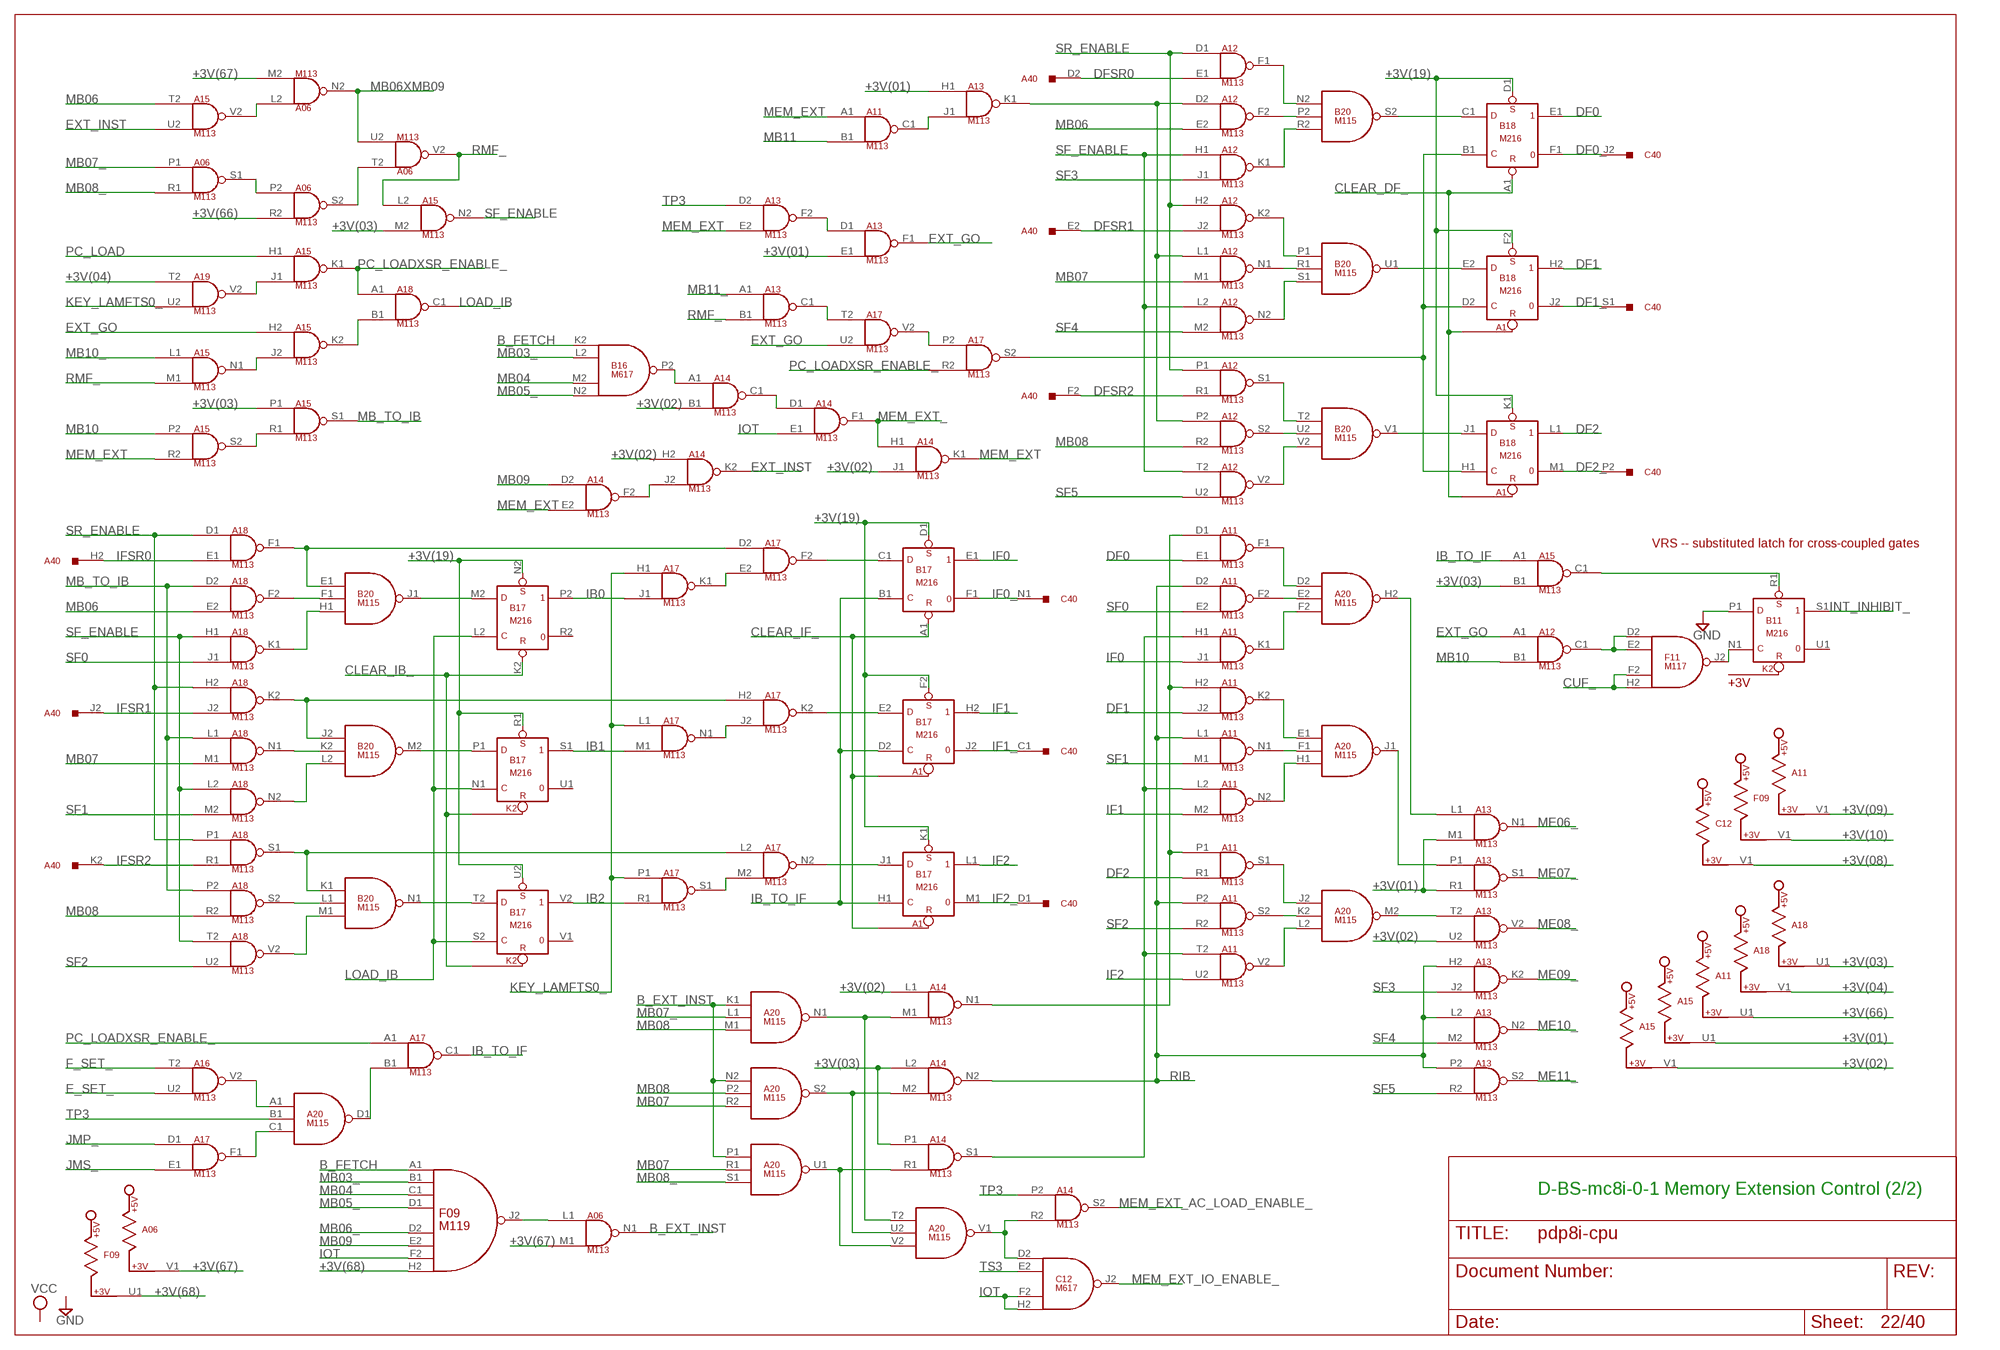
[diagram p22: schematic, sheet 22]

### Parts
A11  M113  [H807]
A12  M113  [H807]
A14  M113  [H807]
A15  M113  [H807]
A17  M113  [H807]
A18  M113  [H807]
A20  M115  [H807]
B17  M216  [H807]

### Nets
+3V(01): A13.E1(F1:IN2) A13.H1(K1:IN1) A13.M1(N1:IN2) A13.R1(S1:IN2) A15.U1
+3V(02): A13.U2(V2:IN2) A14.B1(C1:IN2) A14.H2(K2:IN1) A14.J1(K1:IN2) A14.L1(N1:IN1) A15.V1
+3V(03): A14.L2(N2:IN1) A14.P1(S1:IN1) A15.B1(C1:IN2) A15.M2(N2:IN2) A15.P1(S1:IN1) A18.U1
+3V(04): A18.V1 A19.T2(V2:IN1) ; also sheet 21
+3V(08): C12.V1 ; also sheet 21
+3V(09): A11.V1 ; also sheet 21
+3V(10): F09.V1 ; also sheet 21
+3V(19): B17.D1(E1:S) B17.F2(H2:S) B17.K1(L1:S) B17.N2(P2:S) B17.R1(S1:S) B17.U2(V2:S) B18.D1(E1:S) B18.F2(H2:S) B18.K1(L1:S) ; also sheet 21
+3V(66): A06.R2(S2:IN2) A11.U1 ; also sheet 26
+3V(67): A06.M1(N1:IN2) A06.M2(N2:IN2) A06.V1 ; also sheet 26
+3V(68): F09.H2(J2:IN8) F09.U1 ; also sheet 2
B_EXT_INST: A06.N1(N1:OUT) A20.K1(N1:IN1) A20.N2(S2:IN1) A20.P1(U1:IN1) ; also sheet 26
B_FETCH: B16.K2(P2:IN1) F09.A1(J2:IN1) ; also sheet 2,4,5,6,7,8,27,29
CLEAR_DF_: B18.A1(E1:R) ; also sheet 21
CLEAR_IB_: B17.K2(P2:R) ; also sheet 21
CLEAR_IF_: B17.A1(E1:R) ; also sheet 21,26
CUF_: F11.F2(J2:IN3) F11.H2(J2:IN4) ; also sheet 26
DF0: A11.E1(F1:IN2) B18.E1 ; also sheet 21
DF0_: B18.F1 C40.J2
DF1: A11.J2(K2:IN2) B18.H2 ; also sheet 21
DF1_: B18.J2 C40.S1
DF2: A11.R1(S1:IN2) B18.L1 ; also sheet 21
DF2_: B18.M1 C40.P2
DFSR0: A12.E1(F1:IN2) A40.D2
DFSR1: A12.J2(K2:IN2) A40.E2
DFSR2: A12.R1(S1:IN2) A40.F2
E_SET_: A16.U2(V2:IN2) ; also sheet 4,5
EXT_GO: A12.A1(C1:IN1) A13.F1(F1:OUT) A15.H2(K2:IN1) A17.U2(V2:IN2) ; also sheet 26
EXT_INST: A14.K2(K2:OUT) A15.U2(V2:IN2)
F_SET_: A16.T2(V2:IN1) ; also sheet 4,5
GND [Suppply]: B11.P1(S1:D) ; also sheet 2,5,9,10,11,12,13,14,26,27,30
IB0: A17.J1(K1:IN2) B17.P2
IB1: A17.M1(N1:IN2) B17.S1
IB2: A17.R1(S1:IN2) B17.V2
IB_TO_IF: A15.A1(C1:IN1) A17.C1(C1:OUT) B17.B1(E1:C) B17.D2(H2:C) B17.H1(L1:C) ; also sheet 26
IB_TO_IF_: A15.C1(C1:OUT) B11.R1(S1:S)
IF0: A11.J1(K1:IN2) B17.E1 ; also sheet 21
IF0_: B17.F1 C40.N1
IF1: A11.M2(N2:IN2) B17.H2 ; also sheet 21
IF1_: B17.J2 C40.C1
IF2: A11.U2(V2:IN2) B17.L1 ; also sheet 21
IF2_: B17.M1 C40.D1
IFSR0: A18.E1(F1:IN2) A40.H2
IFSR1: A18.J2(K2:IN2) A40.J2
IFSR2: A18.R1(S1:IN2) A40.K2
INT_INHIBIT_: B11.S1 ; also sheet 8
IOT: A14.E1(F1:IN2) C12.F2(J2:IN3) C12.H2(J2:IN4) F09.F2(J2:IN7) ; also sheet 2,4,7,8,29
JMP_: A17.D1(F1:IN1) ; also sheet 4,5,21
JMS_: A17.E1(F1:IN2) ; also sheet 4,21
KEY_LAMFTS0_: A17.H1(K1:IN1) A17.L1(N1:IN1) A17.P1(S1:IN1) A19.U2(V2:IN2) ; also sheet 5,26
LOAD_IB: A18.C1(C1:OUT) B17.L2(P2:C) B17.N1(S1:C) B17.S2(V2:C)
MB03_: B16.L2(P2:IN2) F09.B1(J2:IN2) ; also sheet 4,5,6,7,8,9,14,30,32
MB04: B16.M2(P2:IN3) F09.C1(J2:IN3) ; also sheet 5,9,14,21,30
MB05_: B16.N2(P2:IN4) F09.D1(J2:IN4) ; also sheet 5,8,9,14,29,30
MB06: A12.E2(F2:IN2) A15.T2(V2:IN1) A18.E2(F2:IN2) ; also sheet 5,7,9,14,21,27,30
MB06_: F09.D2(J2:IN5) ; also sheet 5,8,9,14,29,30,32
MB06XMB09: A06.N2(N2:OUT) A06.U2(V2:IN2) ; also sheet 26
MB07: A12.M1(N1:IN2) A18.M1(N1:IN2) A20.R1(U1:IN2) A20.R2(S2:IN3) ; also sheet 5,7,9,14,21,26,27,30
MB07_: A06.P1(S1:IN1) A20.L1(N1:IN2) ; also sheet 5,8,9,14,26,28,29,30,32
MB08: A12.R2(S2:IN2) A18.R2(S2:IN2) A20.M1(N1:IN3) A20.P2(S2:IN2) ; also sheet 6,7,9,14,21,26,27,30
MB08_: A06.R1(S1:IN2) A20.S1(U1:IN3) ; also sheet 6,7,8,9,14,26,28,29,30,32
MB09: A14.D2(F2:IN1) F09.E2(J2:IN6) ; also sheet 2,5,6,9,14,21,27,29,30
MB10: A12.B1(C1:IN2) A15.P2(S2:IN1) ; also sheet 2,6,8,9,14,21,27,29,30
MB10_: A15.L1(N1:IN1) ; also sheet 6,8,9,26,27,28,30
MB11: A11.B1(C1:IN2) ; also sheet 2,6,9,14,21,27,29,30
MB11_: A13.A1(C1:IN1) ; also sheet 2,5,7,8,9,26,28,29,30
MB_TO_IB: A15.S1(S1:OUT) A18.D2(F2:IN1) A18.L1(N1:IN1) A18.P2(S2:IN1)
ME06_: A13.N1(N1:OUT) ; also sheet 14
ME07_: A13.S1(S1:OUT) ; also sheet 14
ME08_: A13.V2(V2:OUT) ; also sheet 14
ME09_: A13.K2(K2:OUT) ; also sheet 14
ME10_: A13.N2(N2:OUT) ; also sheet 14
ME11_: A13.S2(S2:OUT) ; also sheet 14
MEM_EXT: A11.A1(C1:IN1) A13.E2(F2:IN2) A14.E2(F2:IN2) A14.K1(K1:OUT) A15.R2(S2:IN2)
MEM_EXT_: A14.F1(F1:OUT) A14.H1(K1:IN1) ; also sheet 2
MEM_EXT_AC_LOAD_ENABLE_: A14.S2(S2:OUT) ; also sheet 7
MEM_EXT_IO_ENABLE_: C12.J2(J2:OUT) ; also sheet 5
N$27: B11.N1(S1:C) F11.J2(J2:OUT)
N$420: A06.P2(S2:IN1) A06.S1(S1:OUT)
N$421: A06.L2(N2:IN1) A15.V2(V2:OUT)
N$422: A06.S2(S2:OUT) A06.T2(V2:IN1)
N$423: A15.R1(S1:IN2) A15.S2(S2:OUT)
N$424: A15.J2(K2:IN2) A15.N1(N1:OUT)
N$425: A15.J1(K1:IN2) A19.V2(V2:OUT)
N$426: A15.K2(K2:OUT) A18.B1(C1:IN2)
N$427: A18.F2(F2:OUT) B20.F1(J1:IN2)
N$428: A18.K1(K1:OUT) B20.H1(J1:IN3)
N$429: A17.D2(F2:IN1) A18.F1(F1:OUT) B20.E1(J1:IN1)
N$430: A17.H2(K2:IN1) A18.K2(K2:OUT) B20.J2(M2:IN1)
N$431: A18.N1(N1:OUT) B20.K2(M2:IN2)
N$432: A18.N2(N2:OUT) B20.L2(M2:IN3)
N$433: A17.L2(N2:IN1) A18.S1(S1:OUT) B20.K1(N1:IN1)
N$434: A18.S2(S2:OUT) B20.L1(N1:IN2)
N$435: A18.V2(V2:OUT) B20.M1(N1:IN3)
N$436: B17.T2(V2:D) B20.N1(N1:OUT)
N$437: B17.P1(S1:D) B20.M2(M2:OUT)
N$438: B17.M2(P2:D) B20.J1(J1:OUT)
N$439: A17.E2(F2:IN2) A17.K1(K1:OUT)
N$440: A17.J2(K2:IN2) A17.N1(N1:OUT)
N$441: A17.M2(N2:IN2) A17.S1(S1:OUT)
N$442: A17.N2(N2:OUT) B17.J1(L1:D)
N$443: A17.K2(K2:OUT) B17.E2(H2:D)
N$444: A17.F2(F2:OUT) B17.C1(E1:D)
N$445: A16.V2(V2:OUT) A20.A1(D1:IN1)
N$446: A17.F1(F1:OUT) A20.C1(D1:IN3)
N$447: A17.B1(C1:IN2) A20.D1(D1:OUT)
N$451: A06.L1(N1:IN1) F09.J2(J2:OUT)
N$452: A14.A1(C1:IN1) B16.P2(P2:OUT)
N$453: A14.C1(C1:OUT) A14.D1(F1:IN1)
N$454: A14.F2(F2:OUT) A14.J2(K2:IN2)
N$455: A14.M1(N1:IN2) A20.N1(N1:OUT) A20.T2(V1:IN1)
N$456: A14.M2(N2:IN2) A20.S2(S2:OUT) A20.U2(V1:IN2)
N$457: A14.R1(S1:IN2) A20.U1(U1:OUT) A20.V2(V1:IN3)
N$458: A14.R2(S2:IN2) A20.V1(V1:OUT) C12.D2(J2:IN1)
N$459: A11.D1(F1:IN1) A11.H2(K2:IN1) A11.P1(S1:IN1) A14.N1(N1:OUT)
N$460: A11.H1(K1:IN1) A11.L2(N2:IN1) A11.T2(V2:IN1) A14.S1(S1:OUT)
N$461: A11.S2(S2:OUT) A20.K2(M2:IN2)
N$462: A11.N1(N1:OUT) A20.F1(J1:IN2)
N$463: A11.F2(F2:OUT) A20.E2(H2:IN2)
N$464: A11.F1(F1:OUT) A20.D2(H2:IN1)
N$465: A11.K1(K1:OUT) A20.F2(H2:IN3)
N$466: A11.N2(N2:OUT) A20.H1(J1:IN3)
N$467: A11.V2(V2:OUT) A20.L2(M2:IN3)
N$468: A11.S1(S1:OUT) A20.J2(M2:IN1)
N$469: A11.K2(K2:OUT) A20.E1(J1:IN1)
N$470: A13.L1(N1:IN1) A20.H2(H2:OUT)
N$471: A13.P1(S1:IN1) A20.J1(J1:OUT)
N$472: A13.T2(V2:IN1) A20.M2(M2:OUT)
N$473: A12.D2(F2:IN1) A12.L1(N1:IN1) A12.P2(S2:IN1) A13.K1(K1:OUT)
N$474: A12.S2(S2:OUT) B20.U2(V1:IN2)
N$475: A12.V2(V2:OUT) B20.V2(V1:IN3)
N$476: A12.N2(N2:OUT) B20.S1(U1:IN3)
N$477: A12.N1(N1:OUT) B20.R1(U1:IN2)
N$478: A12.K2(K2:OUT) B20.P1(U1:IN1)
N$479: A12.S1(S1:OUT) B20.T2(V1:IN1)
N$480: A12.K1(K1:OUT) B20.R2(S2:IN3)
N$481: A12.F2(F2:OUT) B20.P2(S2:IN2)
N$482: A12.F1(F1:OUT) B20.N2(S2:IN1)
N$483: B18.C1(E1:D) B20.S2(S2:OUT)
N$484: B18.E2(H2:D) B20.U1(U1:OUT)
N$485: B18.J1(L1:D) B20.V1(V1:OUT)
N$489: A17.S2(S2:OUT) B18.B1(E1:C) B18.D2(H2:C) B18.H1(L1:C)
N$490: A11.C1(C1:OUT) A13.J1(K1:IN2)
N$491: A17.P2(S2:IN1) A17.V2(V2:OUT)
N$492: A13.D1(F1:IN1) A13.F2(F2:OUT)
N$493: A13.C1(C1:OUT) A17.T2(V2:IN1)
N$497: A12.C1(C1:OUT) F11.D2(J2:IN1) F11.E2(J2:IN2)
PC_LOAD: A15.H1(K1:IN1) ; also sheet 7,9
PC_LOADXSR_ENABLE_: A15.K1(K1:OUT) A17.A1(C1:IN1) A17.R2(S2:IN2) A18.A1(C1:IN1) ; also sheet 26
RIB: A11.D2(F2:IN1) A11.L1(N1:IN1) A11.P2(S2:IN1) A13.H2(K2:IN1) A13.L2(N2:IN1) A13.P2(S2:IN1) A14.N2(N2:OUT) ; also sheet 26
RMF_: A06.V2(V2:OUT) A13.B1(C1:IN2) A15.L2(N2:IN1) A15.M1(N1:IN2) ; also sheet 26
SF0: A11.E2(F2:IN2) A18.J1(K1:IN2) ; also sheet 21
SF1: A11.M1(N1:IN2) A18.M2(N2:IN2) ; also sheet 21
SF2: A11.R2(S2:IN2) A18.U2(V2:IN2) ; also sheet 21
SF3: A12.J1(K1:IN2) A13.J2(K2:IN2) ; also sheet 21
SF4: A12.M2(N2:IN2) A13.M2(N2:IN2) ; also sheet 21
SF5: A12.U2(V2:IN2) A13.R2(S2:IN2) ; also sheet 21
SF_ENABLE: A12.H1(K1:IN1) A12.L2(N2:IN1) A12.T2(V2:IN1) A15.N2(N2:OUT) A18.H1(K1:IN1) A18.L2(N2:IN1) A18.T2(V2:IN1) ; also sheet 26
SR_ENABLE: A12.D1(F1:IN1) A12.H2(K2:IN1) A12.P1(S1:IN1) A18.D1(F1:IN1) A18.H2(K2:IN1) A18.P1(S1:IN1) ; also sheet 5,10,11,12,13
TP3: A13.D2(F2:IN1) A14.P2(S2:IN1) A20.B1(D1:IN2) ; also sheet 2,7,21,26,27,29,30
TS3: C12.E2(J2:IN2) ; also sheet 2,5,6,29
Unconnected: A12.U1 A12.V1 A14.T2(V2:IN1) A14.U1 A14.U2(V2:IN2) A14.V1 A14.V2(V2:OUT) A15.D1(F1:IN1) A15.D2(F2:IN1) A15.E1(F1:IN2) A15.E2(F2:IN2) A15.F1(F1:OUT) A15.F2(F2:OUT) A17.U1 A17.V1 B11.U1 B17.R2 B17.U1 B17.V1

### Notes on the sheet
- VRS -- substituted latch for cross-coupled gates
- +3V
- D-BS-mc8i-0-1 Memory Extension Control (2/2)

## Sheet 23 of 40
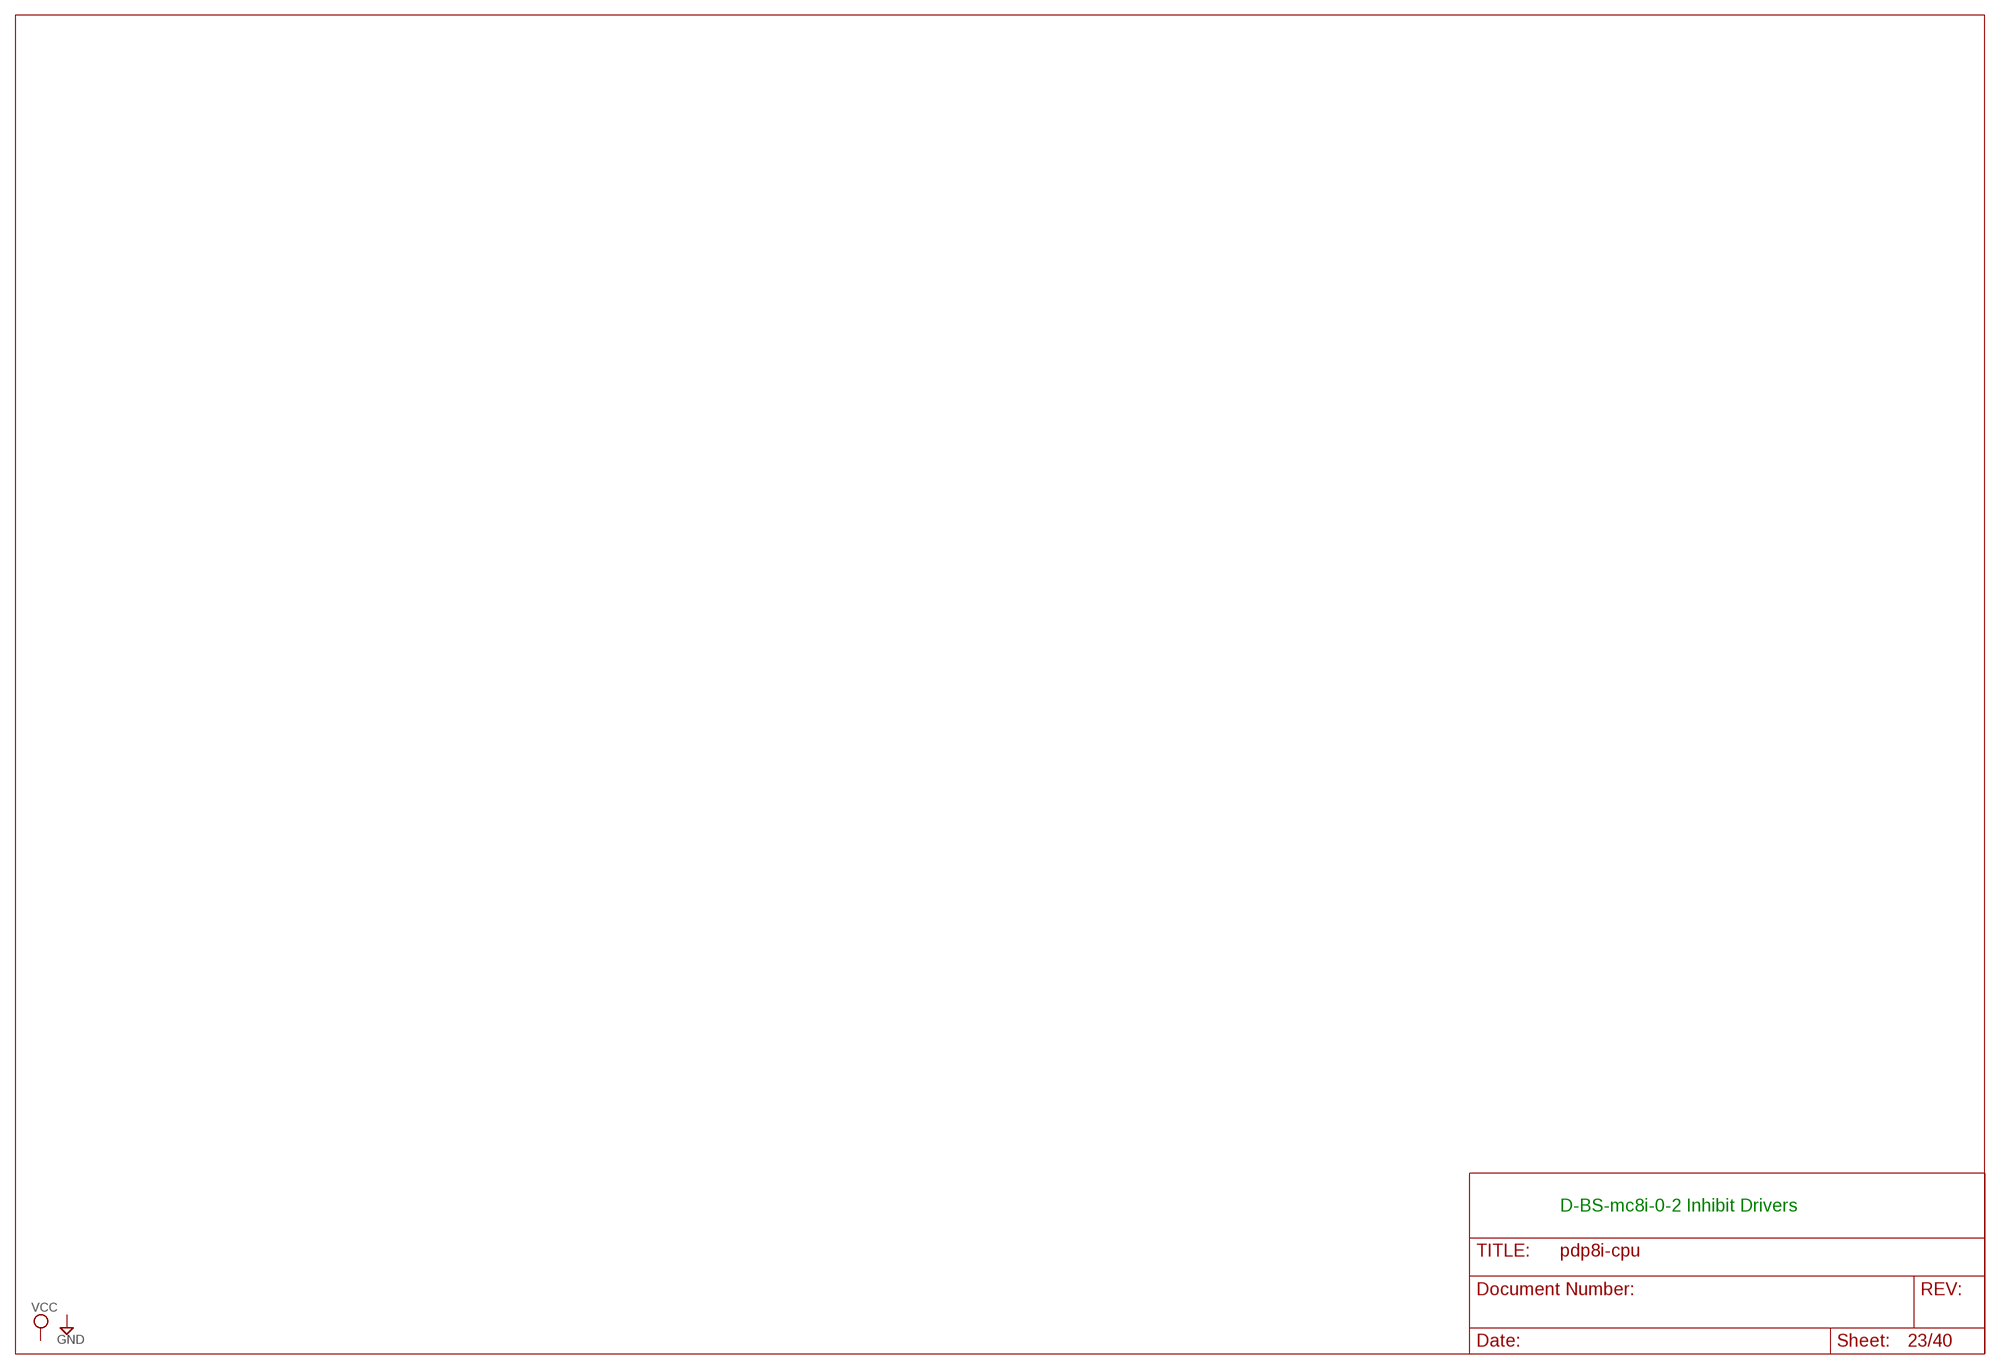
[diagram p23: schematic, sheet 23]

### Notes on the sheet
- D-BS-mc8i-0-2 Inhibit Drivers

## Sheet 24 of 40
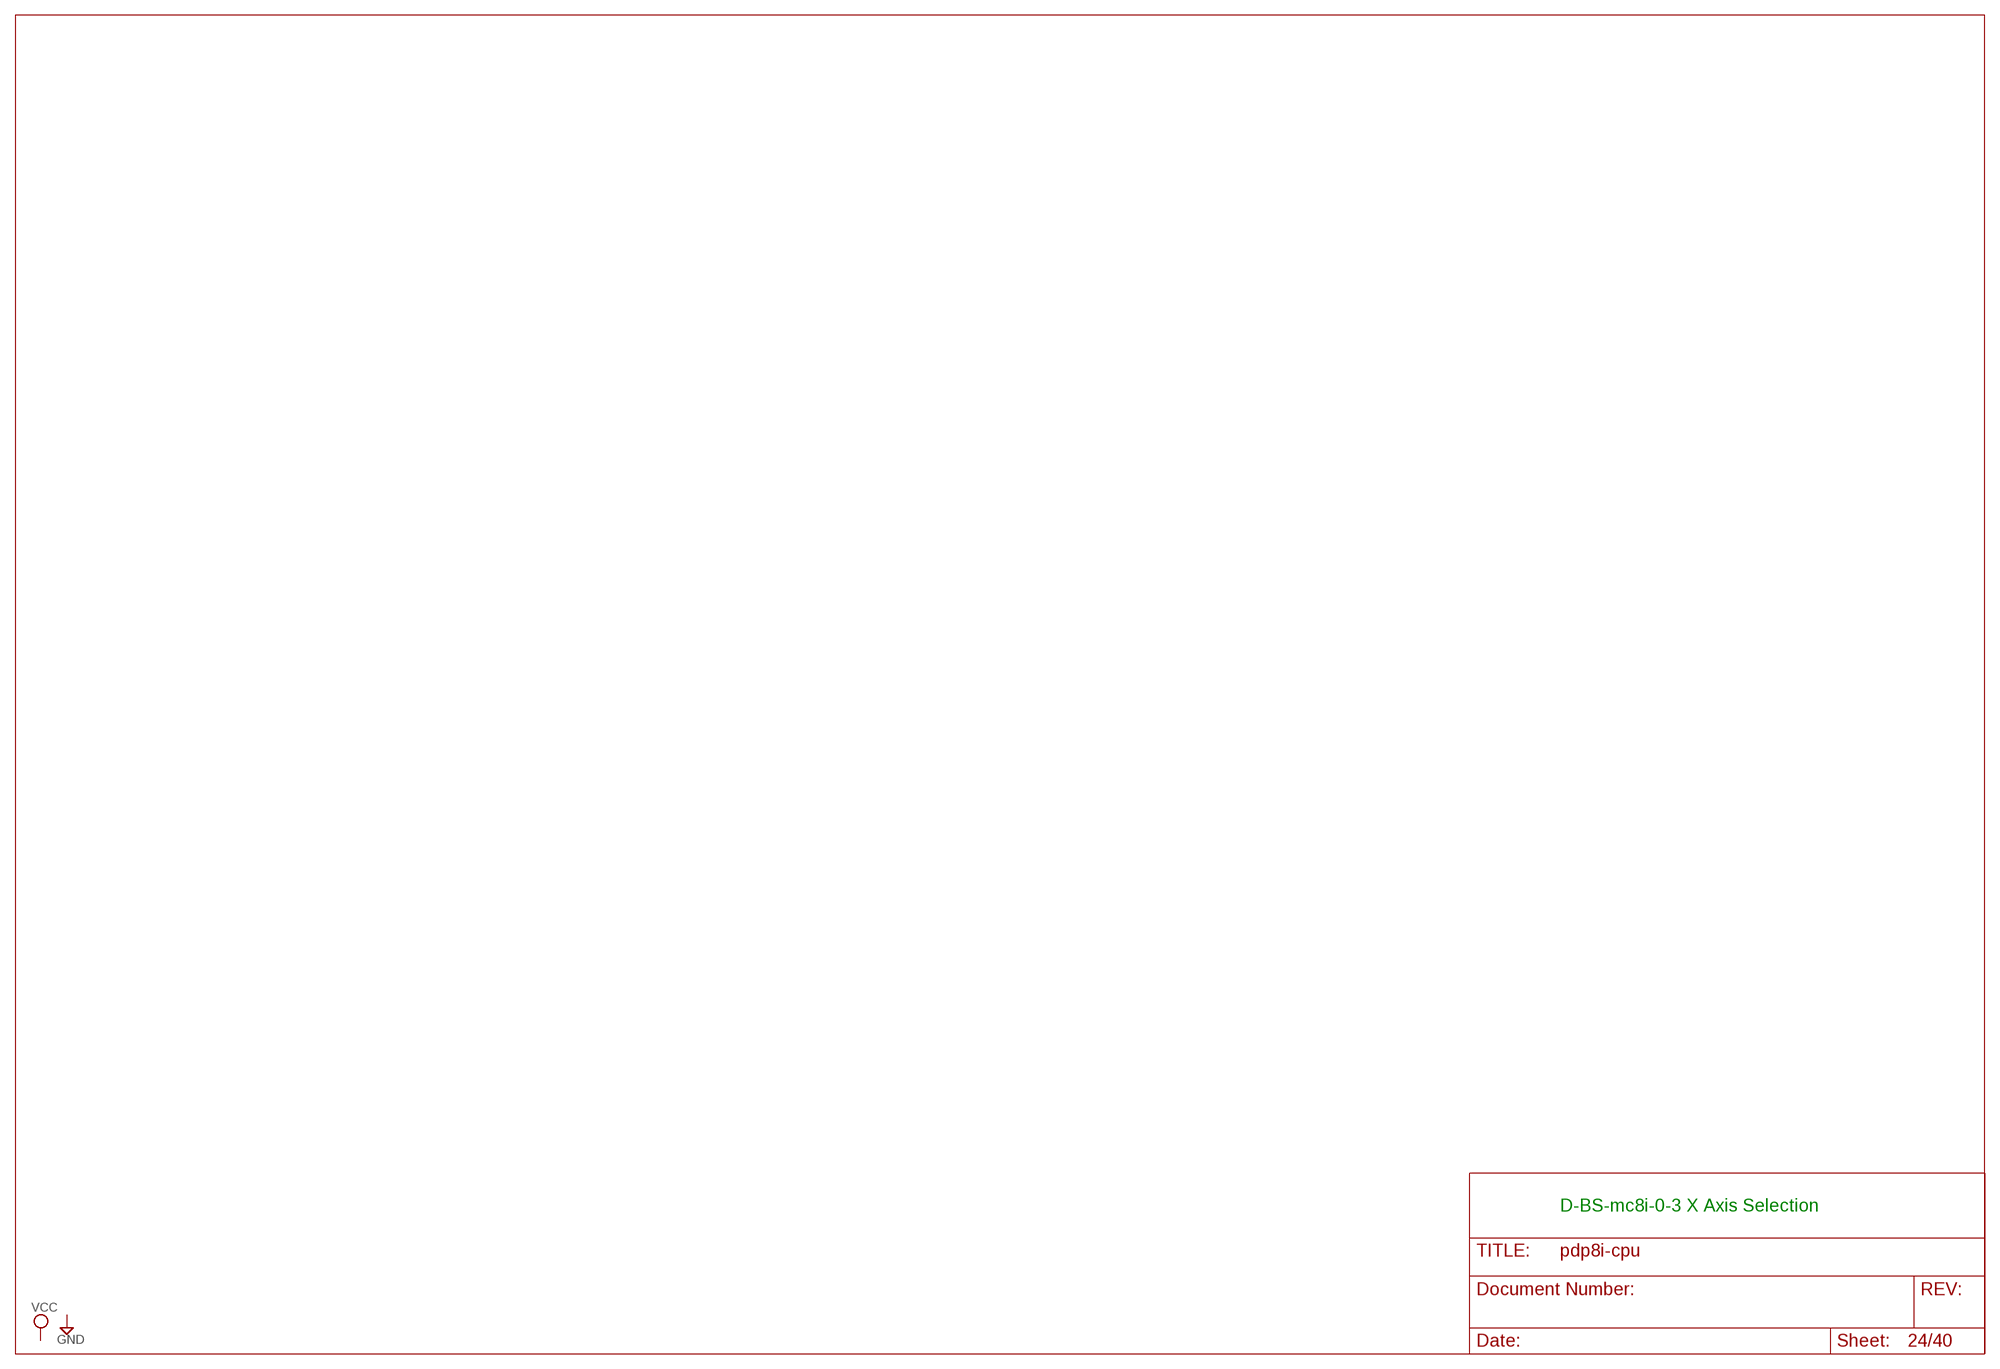
[diagram p24: schematic, sheet 24]

### Notes on the sheet
- D-BS-mc8i-0-3 X Axis Selection

## Sheet 25 of 40
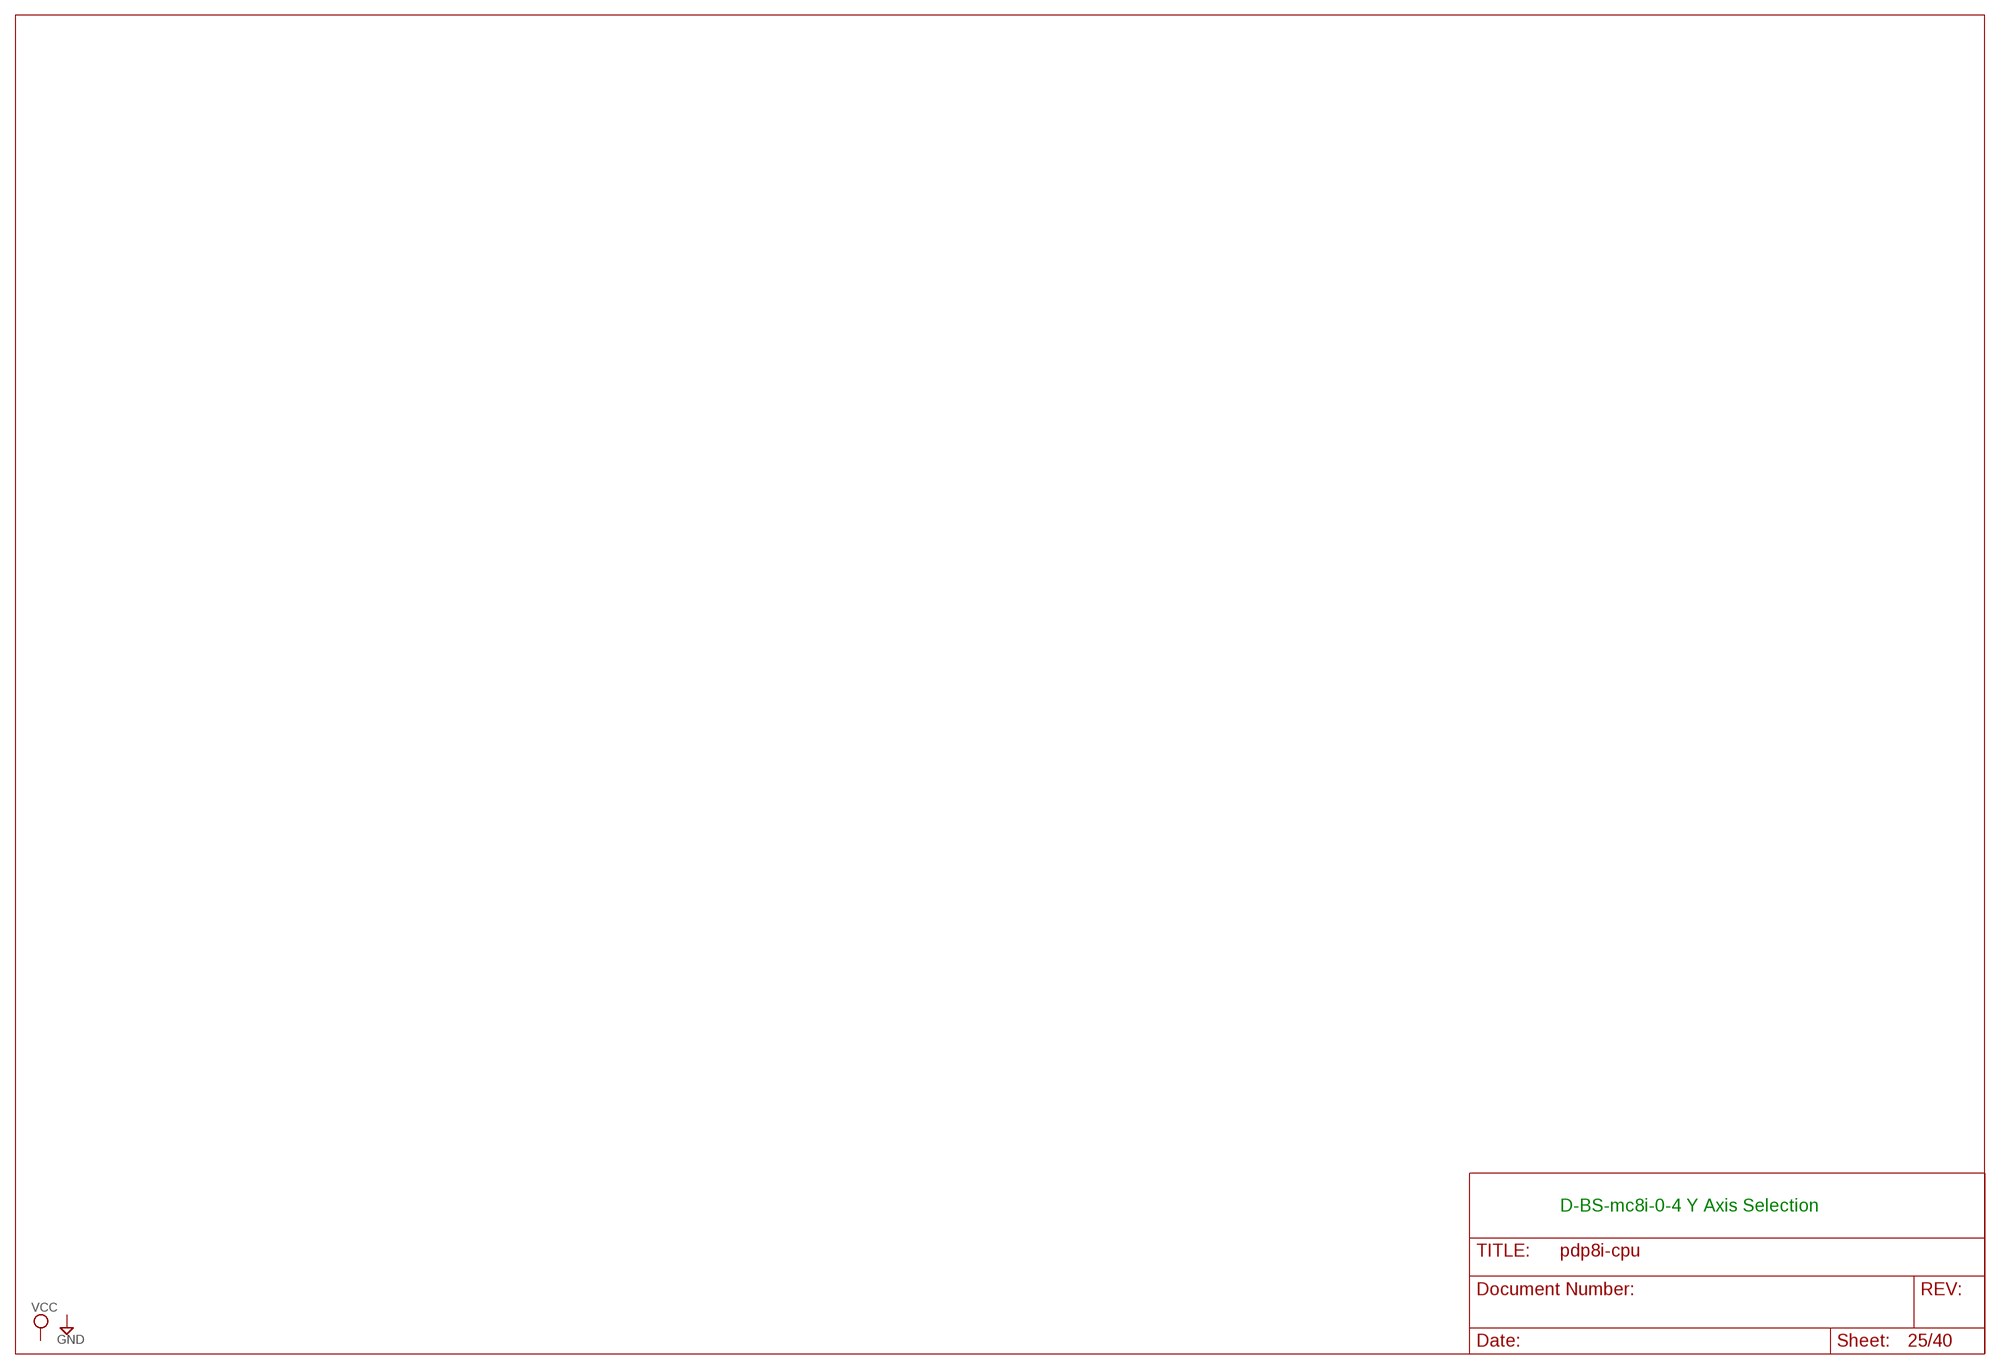
[diagram p25: schematic, sheet 25]

### Notes on the sheet
- D-BS-mc8i-0-4 Y Axis Selection

## Sheet 26 of 40
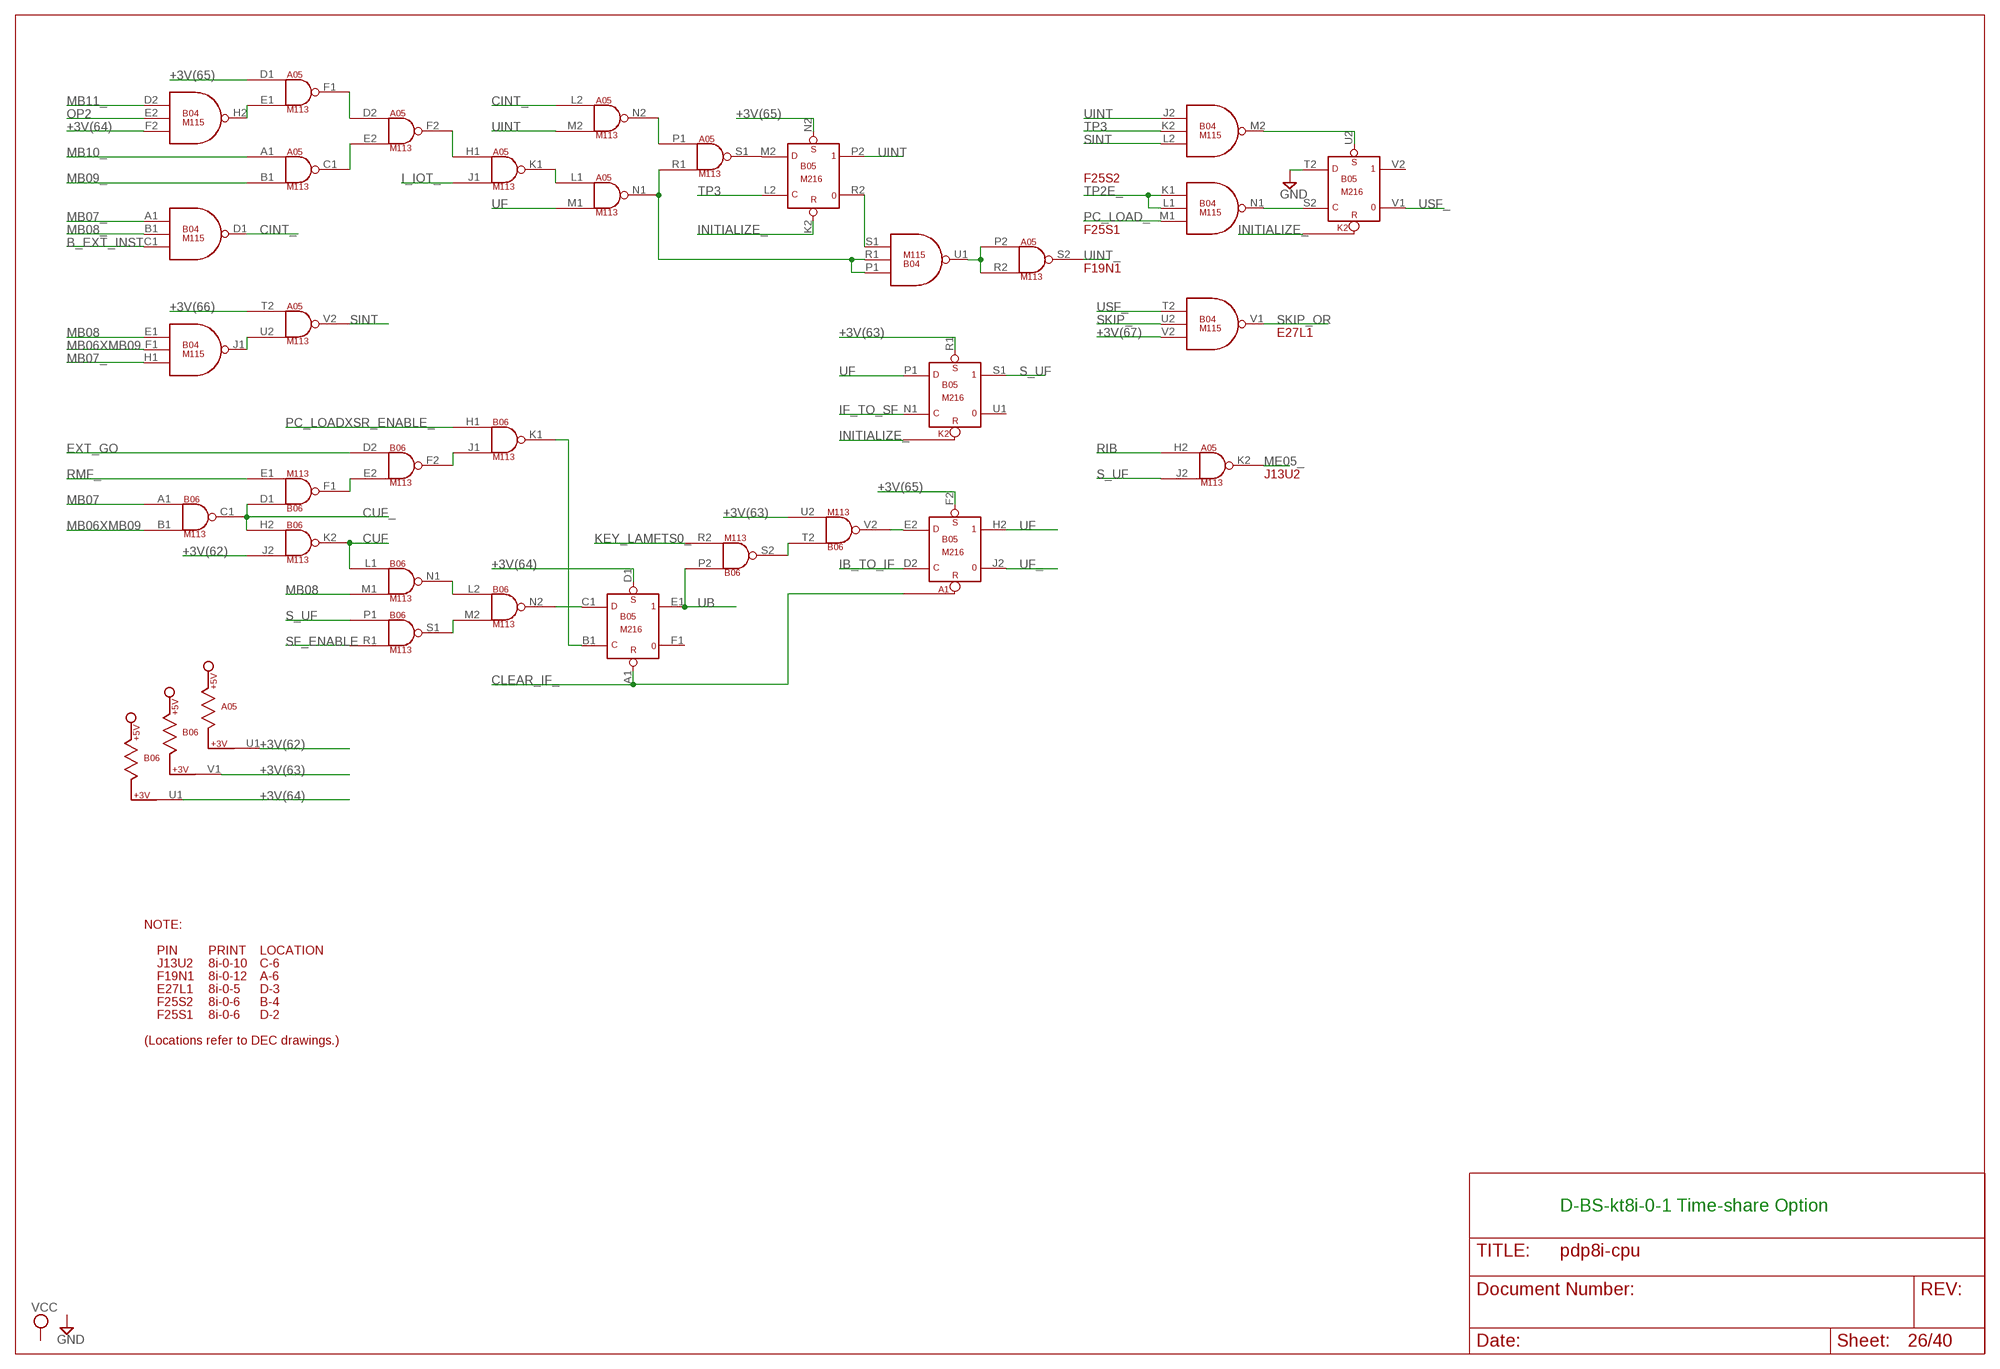
[diagram p26: schematic, sheet 26]

### Parts
A05  M113  [H807]
B04  M115  [H807]
B05  M216  [H807]
B06  M113  [H807]

### Nets
+3V(62): A05.U1 B06.J2(K2:IN2)
+3V(63): B05.R1(S1:S) B06.U2(V2:IN2) B06.V1
+3V(64): B04.F2(H2:IN3) B05.D1(E1:S) B06.U1
+3V(65): A05.D1(F1:IN1) B05.F2(H2:S) B05.N2(P2:S) ; also sheet 4,5
+3V(66): A05.T2(V2:IN1) ; also sheet 22
+3V(67): B04.V2(V1:IN3) ; also sheet 22
B_EXT_INST: B04.C1(D1:IN3) ; also sheet 22
CINT_: A05.L2(N2:IN1) B04.D1(D1:OUT)
CLEAR_IF_: B05.A1(E1:R) ; also sheet 21,22
CUF: B06.K2(K2:OUT) B06.L1(N1:IN1)
CUF_: B06.C1(C1:OUT) B06.D1(F1:IN1) B06.H2(K2:IN1) ; also sheet 22
EXT_GO: B06.D2(F2:IN1) ; also sheet 22
GND [Suppply]: B05.T2(V2:D) ; also sheet 2,5,9,10,11,12,13,14,22,27,30
I_IOT_: A05.J1(K1:IN2) ; also sheet 4
IB_TO_IF: B05.D2(H2:C) ; also sheet 22
IF_TO_SF: B05.N1(S1:C) ; also sheet 21
INITIALIZE_: B05.K2(P2:R) ; also sheet 2,14,30,32
KEY_LAMFTS0_: B06.R2(S2:IN2) ; also sheet 5,22
MB06XMB09: B04.F1(J1:IN2) B06.B1(C1:IN2) ; also sheet 22
MB07: B06.A1(C1:IN1) ; also sheet 5,7,9,14,21,22,27,30
MB07_: B04.A1(D1:IN1) B04.H1(J1:IN3) ; also sheet 5,8,9,14,22,28,29,30,32
MB08: B04.E1(J1:IN1) B06.M1(N1:IN2) ; also sheet 6,7,9,14,21,22,27,30
MB08_: B04.B1(D1:IN2) ; also sheet 6,7,8,9,14,22,28,29,30,32
MB09_: A05.B1(C1:IN2) ; also sheet 6,9,27,28,30
MB10_: A05.A1(C1:IN1) ; also sheet 6,8,9,22,27,28,30
MB11_: B04.D2(H2:IN1) ; also sheet 2,5,7,8,9,22,28,29,30
ME05_: A05.K2(K2:OUT) ; also sheet 14
N$548: A05.E1(F1:IN2) B04.H2(H2:OUT)
N$549: A05.D2(F2:IN1) A05.F1(F1:OUT)
N$550: A05.C1(C1:OUT) A05.E2(F2:IN2)
N$551: A05.F2(F2:OUT) A05.H1(K1:IN1)
N$552: A05.U2(V2:IN2) B04.J1(J1:OUT)
N$553: B06.E2(F2:IN2) B06.F1(F1:OUT)
N$554: B06.L2(N2:IN1) B06.N1(N1:OUT)
N$555: B06.M2(N2:IN2) B06.S1(S1:OUT)
N$556: B05.C1(E1:D) B06.N2(N2:OUT)
N$557: B06.F2(F2:OUT) B06.J1(K1:IN2)
N$558: B05.B1(E1:C) B06.K1(K1:OUT)
N$559: B06.S2(S2:OUT) B06.T2(V2:IN1)
N$560: B05.E2(H2:D) B06.V2(V2:OUT)
N$561: A05.K1(K1:OUT) A05.L1(N1:IN1)
N$562: A05.N2(N2:OUT) A05.P1(S1:IN1)
N$563: A05.N1(N1:OUT) A05.R1(S1:IN2) B04.P1(U1:IN1) B04.R1(U1:IN2)
N$564: A05.S1(S1:OUT) B05.M2(P2:D)
N$565: B04.S1(U1:IN3) B05.R2
N$566: A05.P2(S2:IN1) A05.R2(S2:IN2) B04.U1(U1:OUT)
N$567: B04.M2(M2:OUT) B05.U2(V2:S)
N$569: B04.N1(N1:OUT) B05.S2(V2:C)
OP2: B04.E2(H2:IN2) ; also sheet 2,5,7,27
PC_LOAD_: B04.M1(N1:IN3) ; also sheet 7
PC_LOADXSR_ENABLE_: B06.H1(K1:IN1) ; also sheet 22
RIB: A05.H2(K2:IN1) ; also sheet 22
RMF_: B06.E1(F1:IN2) ; also sheet 22
S_UF: A05.J2(K2:IN2) B05.S1 B06.P1(S1:IN1)
SF_ENABLE: B06.R1(S1:IN2) ; also sheet 22
SINT: A05.V2(V2:OUT) B04.L2(M2:IN3)
SKIP_: B04.U2(V1:IN2) ; also sheet 7
SKIP_OR: B04.V1(V1:OUT) ; also sheet 6
TP2E_: B04.K1(N1:IN1) B04.L1(N1:IN2) ; also sheet 7
TP3: B04.K2(M2:IN2) B05.L2(P2:C) ; also sheet 2,7,21,22,27,29,30
UB: B05.E1 B06.P2(S2:IN1)
UF: A05.M1(N1:IN2) B05.H2 B05.P1(S1:D)
UF_: B05.J2 ; also sheet 2,4,5
UINT: A05.M2(N2:IN2) B04.J2(M2:IN1) B05.P2
UINT_: A05.S2(S2:OUT) ; also sheet 14
USF_: B04.T2(V1:IN1) B05.V1
Unconnected: A05.V1 B04.N2(S2:IN1) B04.P2(S2:IN2) B04.R2(S2:IN3) B04.S2(S2:OUT) B05.F1 B05.H1(L1:C) B05.J1(L1:D) B05.K1(L1:S) B05.L1 B05.M1 B05.U1 B05.V2

### Notes on the sheet
- F25S2
- F25S1
- F19N1
- E27L1
- J13U2
- NOTE:
- PIN | PRINT | LOCATION
- J13U2 | 8i-0-10 | C-6
- F19N1 | 8i-0-12 | A-6
- E27L1 | 8i-0-5 | D-3
- F25S2 | 8i-0-6 | B-4
- F25S1 | 8i-0-6 | D-2
- (Locations refer to DEC drawings.)
- D-BS-kt8i-0-1 Time-share Option